# EAGLE schematic BoardSchem (EAGLE 9.6.2)

## Sheet 1 of 22: Power
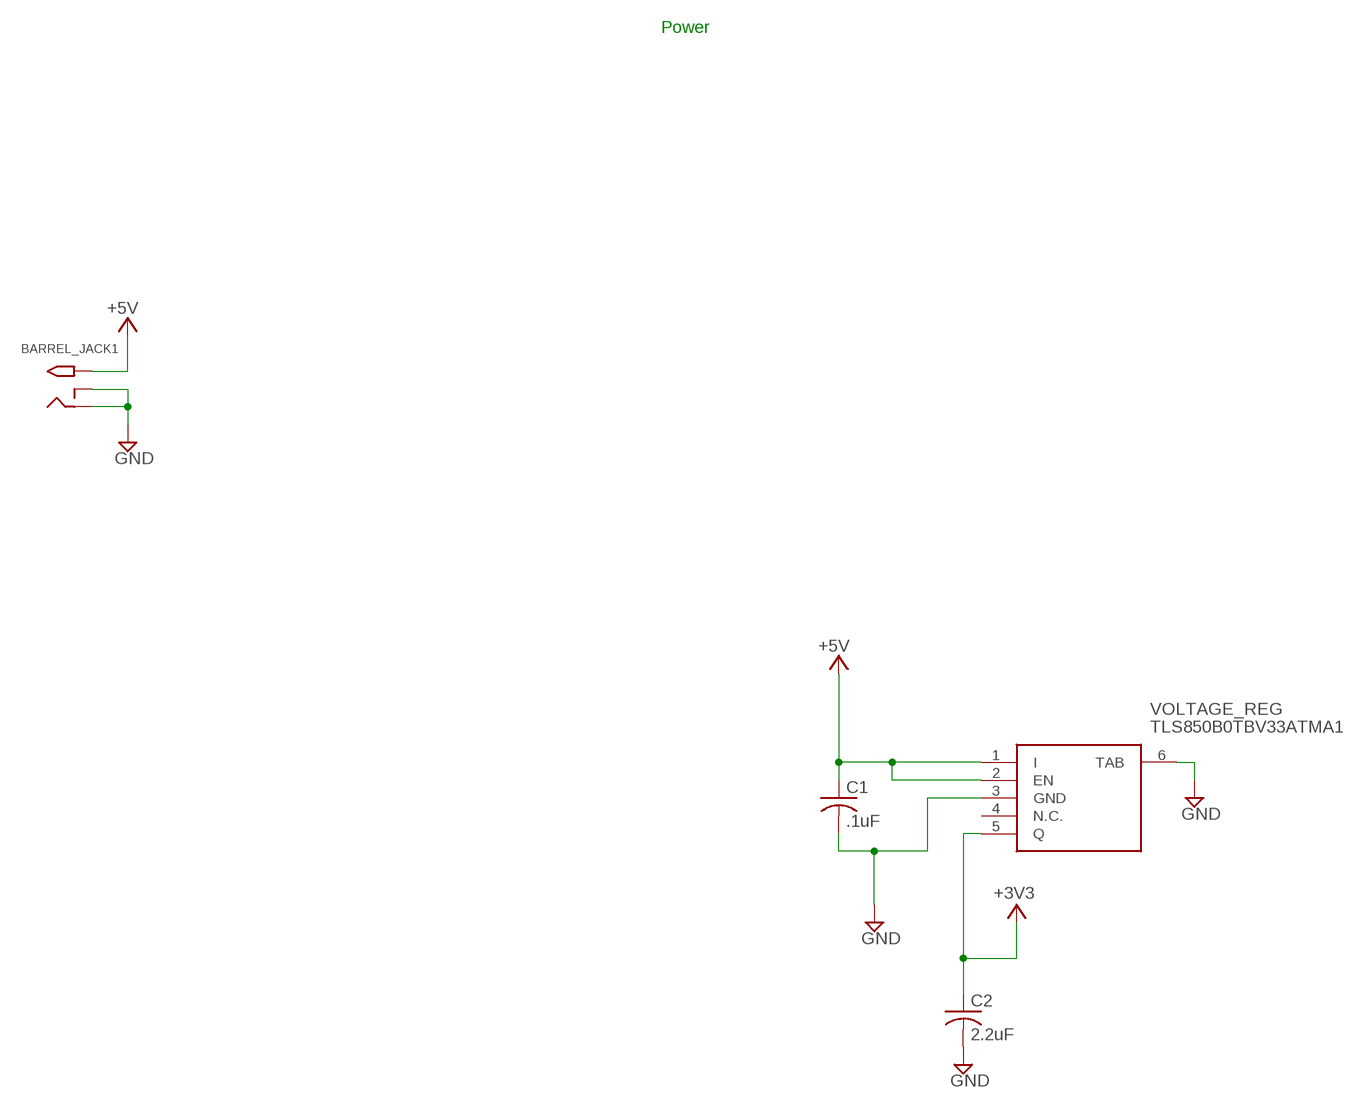
[diagram p0: schematic, sheet 1]

### Parts
BARREL_JACK1  2.1MMJACKTHM  [PJ-102A]
C1  .1uF  C-USC0805  [C0805]
C2  2.2uF  C-USC0805  [C0805]
VOLTAGE_REG  TLS850B0TBV33ATMA1  [TLS850B0TBV33ATMA1]

### Nets
+3V3: C2.1 VOLTAGE_REG.5(Q) ; also sheet 3,4,5,6,7,8,9,10,11,12,13,14,15,16,17,18,19,20,21,22
+5V: BARREL_JACK1.TIP C1.1 VOLTAGE_REG.1(I) VOLTAGE_REG.2(EN) ; also sheet 2,3
GND [5v_power]: BARREL_JACK1.RING BARREL_JACK1.RING_SW C1.2 C2.2 VOLTAGE_REG.3(GND) VOLTAGE_REG.6(TAB) ; also sheet 2,3,4,5,6,7,8,9,10,11,12,13,14,15,16,17,18,19,20,21,22
Unconnected: VOLTAGE_REG.4(N.C.)

### Notes on the sheet
- Power

## Sheet 2 of 22: Controling ICs
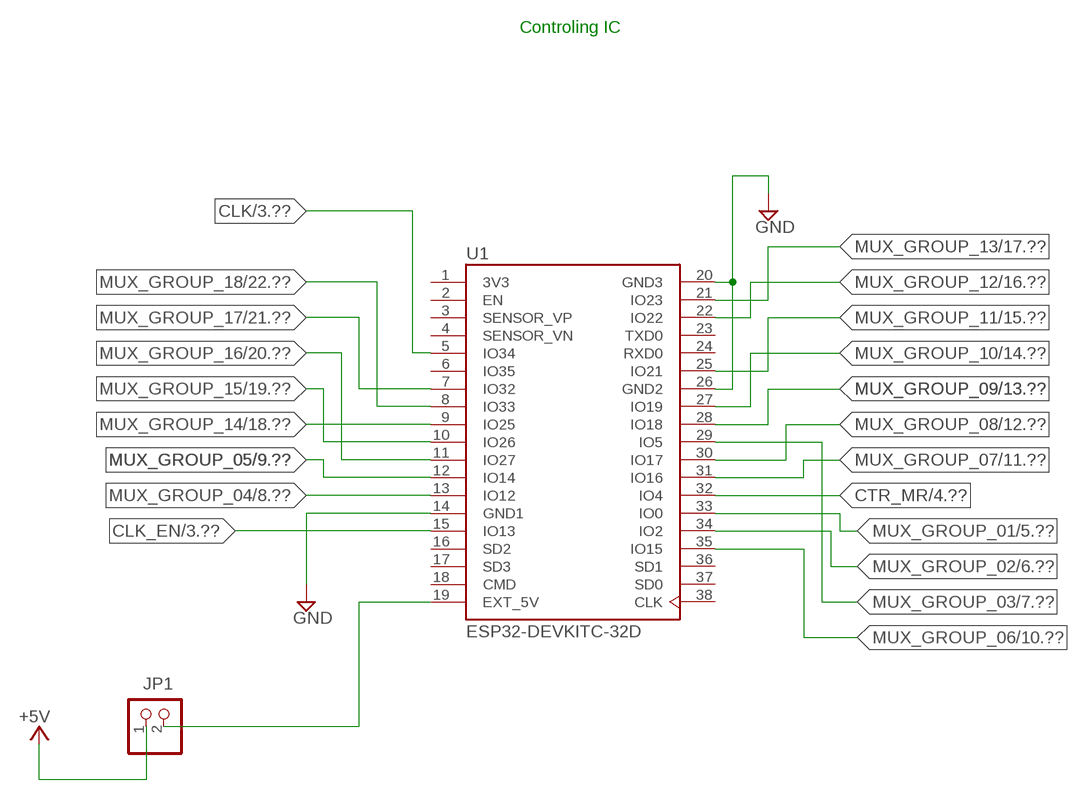
[diagram p1: schematic, sheet 2]

### Parts
JP1  PINHD-1X2  [1X02]
U1  ESP32-DEVKITC-32D  [MODULE_ESP32-DEVKITC-32D]

### Nets
+5V: JP1.1 ; also sheet 1,3
CLK: U1.5(IO34) ; also sheet 3,4
CLK_EN: U1.15(IO13) ; also sheet 3
CTR_MR: U1.32(IO4) ; also sheet 4
GND [5v_power]: U1.14(GND1) U1.20(GND3) U1.26(GND2) ; also sheet 1,3,4,5,6,7,8,9,10,11,12,13,14,15,16,17,18,19,20,21,22
MUX_GROUP_01: U1.33(IO0) ; also sheet 5
MUX_GROUP_02: U1.34(IO2) ; also sheet 6
MUX_GROUP_03: U1.29(IO5) ; also sheet 7
MUX_GROUP_04: U1.13(IO12) ; also sheet 8
MUX_GROUP_05: U1.12(IO14) ; also sheet 9
MUX_GROUP_06: U1.35(IO15) ; also sheet 10
MUX_GROUP_07: U1.31(IO16) ; also sheet 11
MUX_GROUP_08: U1.30(IO17) ; also sheet 12
MUX_GROUP_09: U1.28(IO18) ; also sheet 13
MUX_GROUP_10: U1.27(IO19) ; also sheet 14
MUX_GROUP_11: U1.25(IO21) ; also sheet 15
MUX_GROUP_12: U1.22(IO22) ; also sheet 16
MUX_GROUP_13: U1.21(IO23) ; also sheet 17
MUX_GROUP_14: U1.9(IO25) ; also sheet 18
MUX_GROUP_15: U1.10(IO26) ; also sheet 19
MUX_GROUP_16: U1.11(IO27) ; also sheet 20
MUX_GROUP_17: U1.7(IO32) ; also sheet 21
MUX_GROUP_18: U1.8(IO33) ; also sheet 22
N$1: JP1.2 U1.19(EXT_5V)
Unconnected: U1.2(EN) U1.3(SENSOR_VP) U1.4(SENSOR_VN) U1.6(IO35) U1.16(SD2) U1.17(SD3) U1.18(CMD) U1.23(TXD0) U1.24(RXD0) U1.36(SD1) U1.37(SD0) U1.38(CLK)

### Notes on the sheet
- Controling IC

## Sheet 3 of 22: CLK
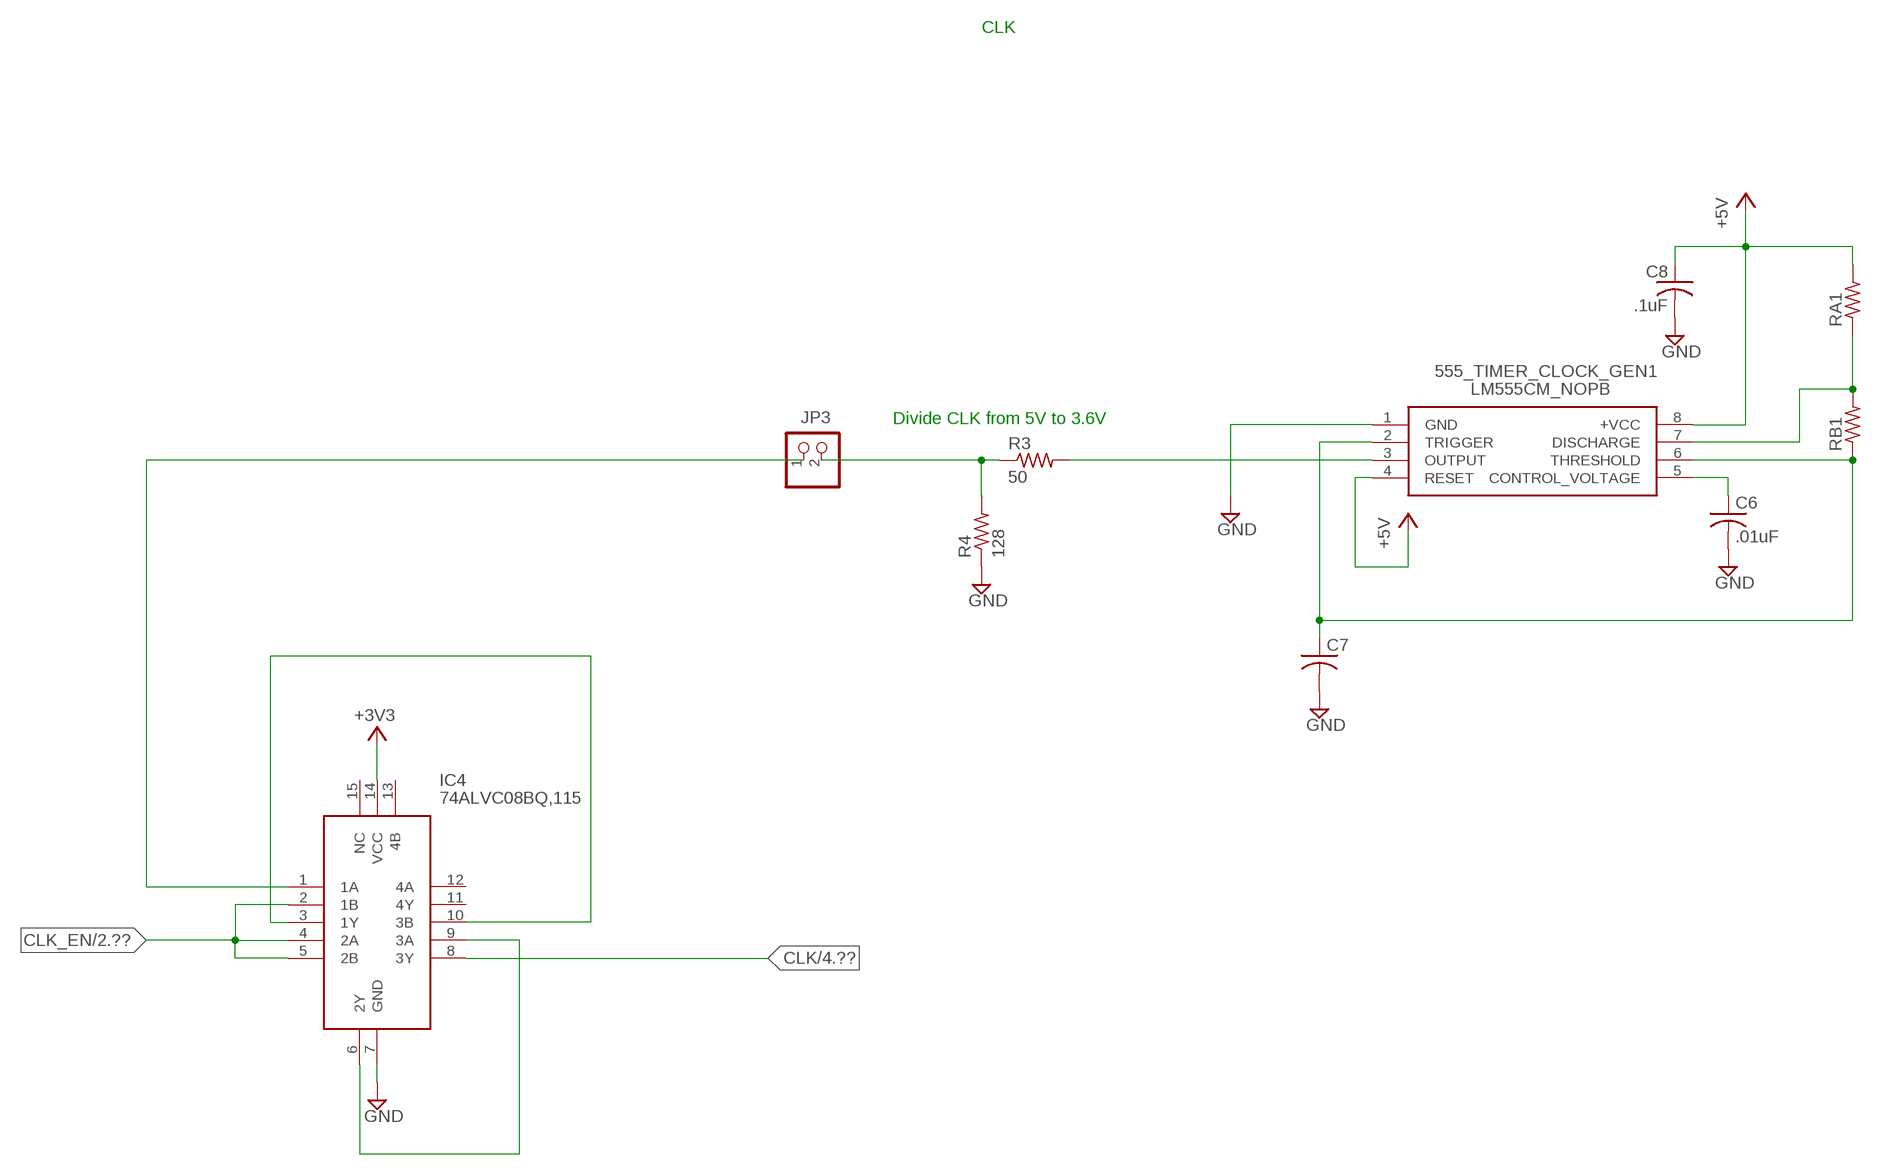
[diagram p2: schematic, sheet 3]

### Parts
555_TIMER_CLOCK_GEN1  LM555CM_NOPB  [SOIC127P600X175-8N]
C6  .01uF  C-USC0805  [C0805]
C7  C-USC0805  [C0805]
C8  .1uF  C-USC0805  [C0805]
IC4  74ALVC08BQ,115  [QFN50P250X300X100-15N]
JP3  PINHD-1X2  [1X02]
R3  50  R-US_R0805  [R0805]
R4  128  R-US_R0805  [R0805]
RA1  R-US_R0805  [R0805]
RB1  R-US_R0805  [R0805]

### Nets
+3V3: IC4.14(VCC) ; also sheet 1,4,5,6,7,8,9,10,11,12,13,14,15,16,17,18,19,20,21,22
+5V: 555_TIMER_CLOCK_GEN1.4(RESET) 555_TIMER_CLOCK_GEN1.8(+VCC) C8.1 RA1.2 ; also sheet 1,2
CLK: IC4.8(3Y) ; also sheet 2,4
CLK_EN: IC4.2(1B) IC4.4(2A) IC4.5(2B) ; also sheet 2
GND [5v_power]: 555_TIMER_CLOCK_GEN1.1(GND) C6.2 C7.2 C8.2 IC4.7(GND) R4.1 ; also sheet 1,2,4,5,6,7,8,9,10,11,12,13,14,15,16,17,18,19,20,21,22
N$3: JP3.2 R3.1 R4.2
N$4: 555_TIMER_CLOCK_GEN1.5(CONTROL_VOLTAGE) C6.1
N$7: 555_TIMER_CLOCK_GEN1.3(OUTPUT) R3.2
N$8: 555_TIMER_CLOCK_GEN1.2(TRIGGER) 555_TIMER_CLOCK_GEN1.6(THRESHOLD) C7.1 RB1.1
N$9: 555_TIMER_CLOCK_GEN1.7(DISCHARGE) RA1.1 RB1.2
N$11: IC4.1(1A) JP3.1
N$14: IC4.6(2Y) IC4.9(3A)
N$17: IC4.3(1Y) IC4.10(3B)
Unconnected: IC4.11(4Y) IC4.12(4A) IC4.13(4B) IC4.15(NC)

### Notes on the sheet
- CLK
- Divide CLK from 5V to 3.6V

## Sheet 4 of 22: Counter
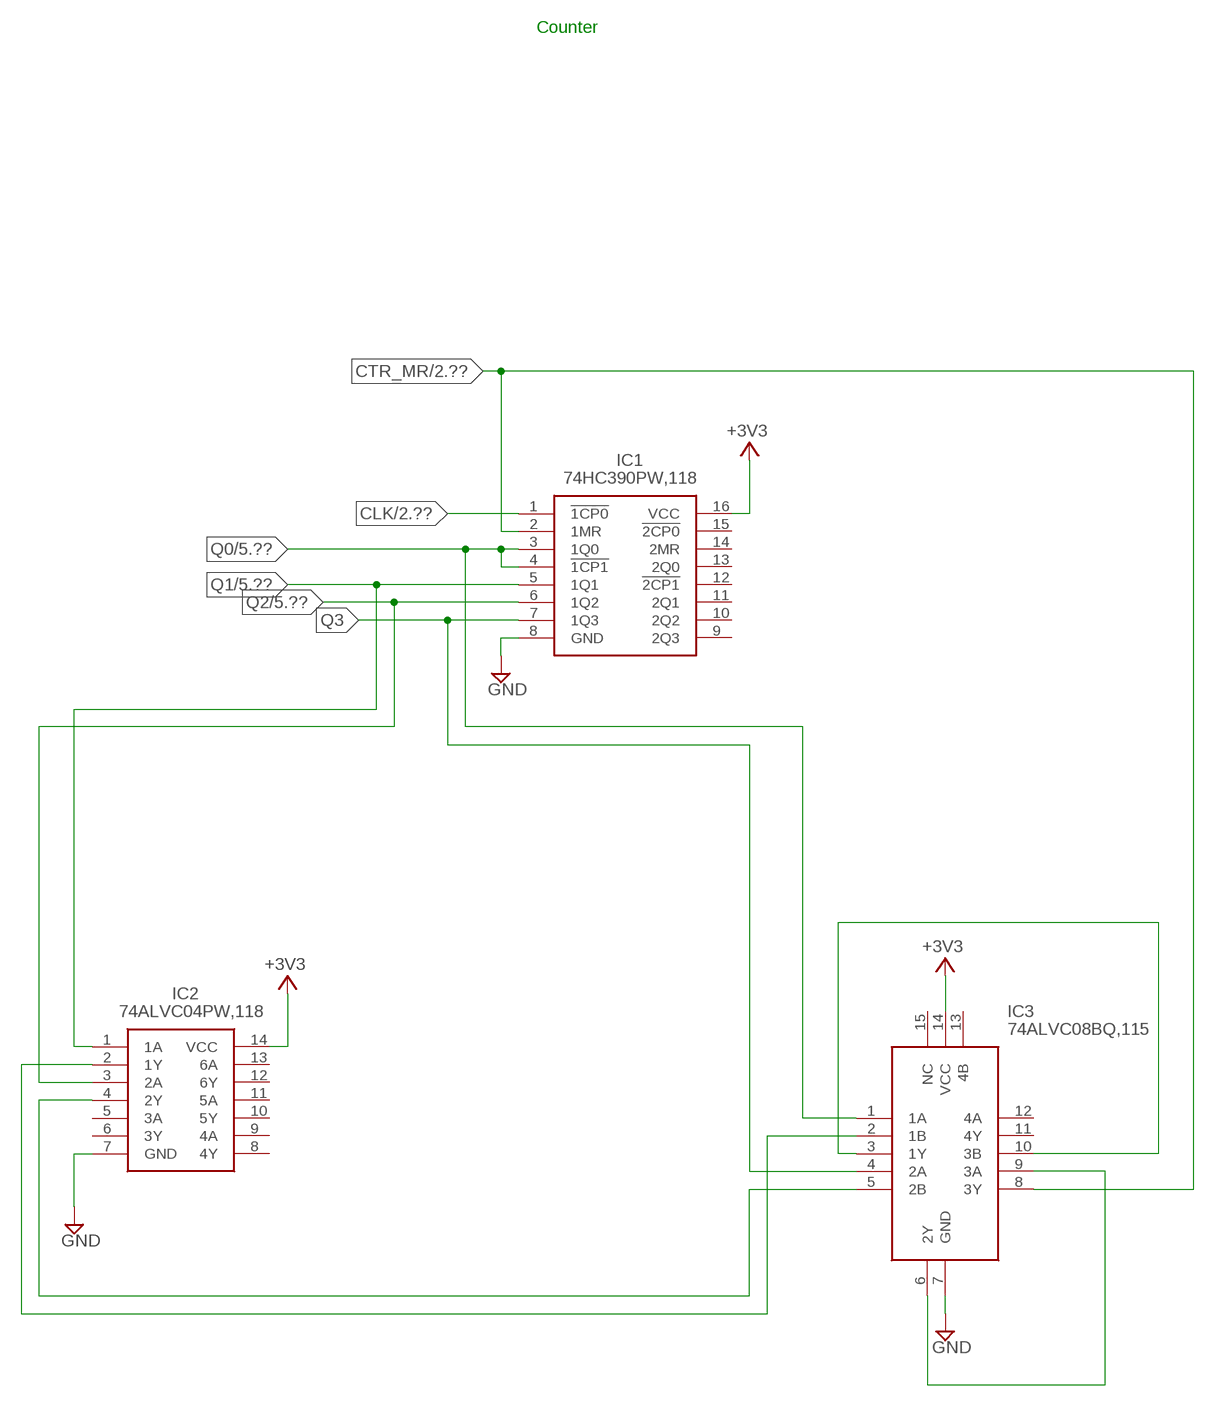
[diagram p3: schematic, sheet 4]

### Parts
IC1  74HC390PW,118  [SOP65P640X110-16N]
IC2  74ALVC04PW,118  [SOP65P640X110-14N]
IC3  74ALVC08BQ,115  [QFN50P250X300X100-15N]

### Nets
+3V3: IC1.16(VCC) IC2.14(VCC) IC3.14(VCC) ; also sheet 1,3,5,6,7,8,9,10,11,12,13,14,15,16,17,18,19,20,21,22
CLK: IC1.1(!1CP0) ; also sheet 2,3
CTR_MR: IC1.2(1MR) IC3.8(3Y) ; also sheet 2
GND [5v_power]: IC1.8(GND) IC2.7(GND) IC3.7(GND) ; also sheet 1,2,3,5,6,7,8,9,10,11,12,13,14,15,16,17,18,19,20,21,22
N$2: IC2.4(2Y) IC3.5(2B)
N$5: IC3.3(1Y) IC3.10(3B)
N$6: IC2.2(1Y) IC3.2(1B)
N$10: IC3.6(2Y) IC3.9(3A)
Q0: IC1.3(1Q0) IC1.4(!1CP1) IC3.1(1A) ; also sheet 5,6,7,8,9,10,11,12,13,14,15,16,17,18,19,20,21,22
Q1: IC1.5(1Q1) IC2.1(1A) ; also sheet 5,6,7,8,9,10,11,12,13,14,15,16,17,18,19,20,21,22
Q2: IC1.6(1Q2) IC2.3(2A) ; also sheet 5,6,7,8,9,10,11,12,13,14,15,16,17,18,19,20,21,22
Q3: IC1.7(1Q3) IC3.4(2A)
Unconnected: IC1.9(2Q3) IC1.10(2Q2) IC1.11(2Q1) IC1.12(!2CP1) IC1.13(2Q0) IC1.14(2MR) IC1.15(!2CP0) IC2.5(3A) IC2.6(3Y) IC2.8(4Y) IC2.9(4A) IC2.10(5Y) IC2.11(5A) IC2.12(6Y) IC2.13(6A) IC3.11(4Y) IC3.12(4A) IC3.13(4B) IC3.15(NC)

### Notes on the sheet
- Counter

## Sheet 5 of 22: MUX Group #1
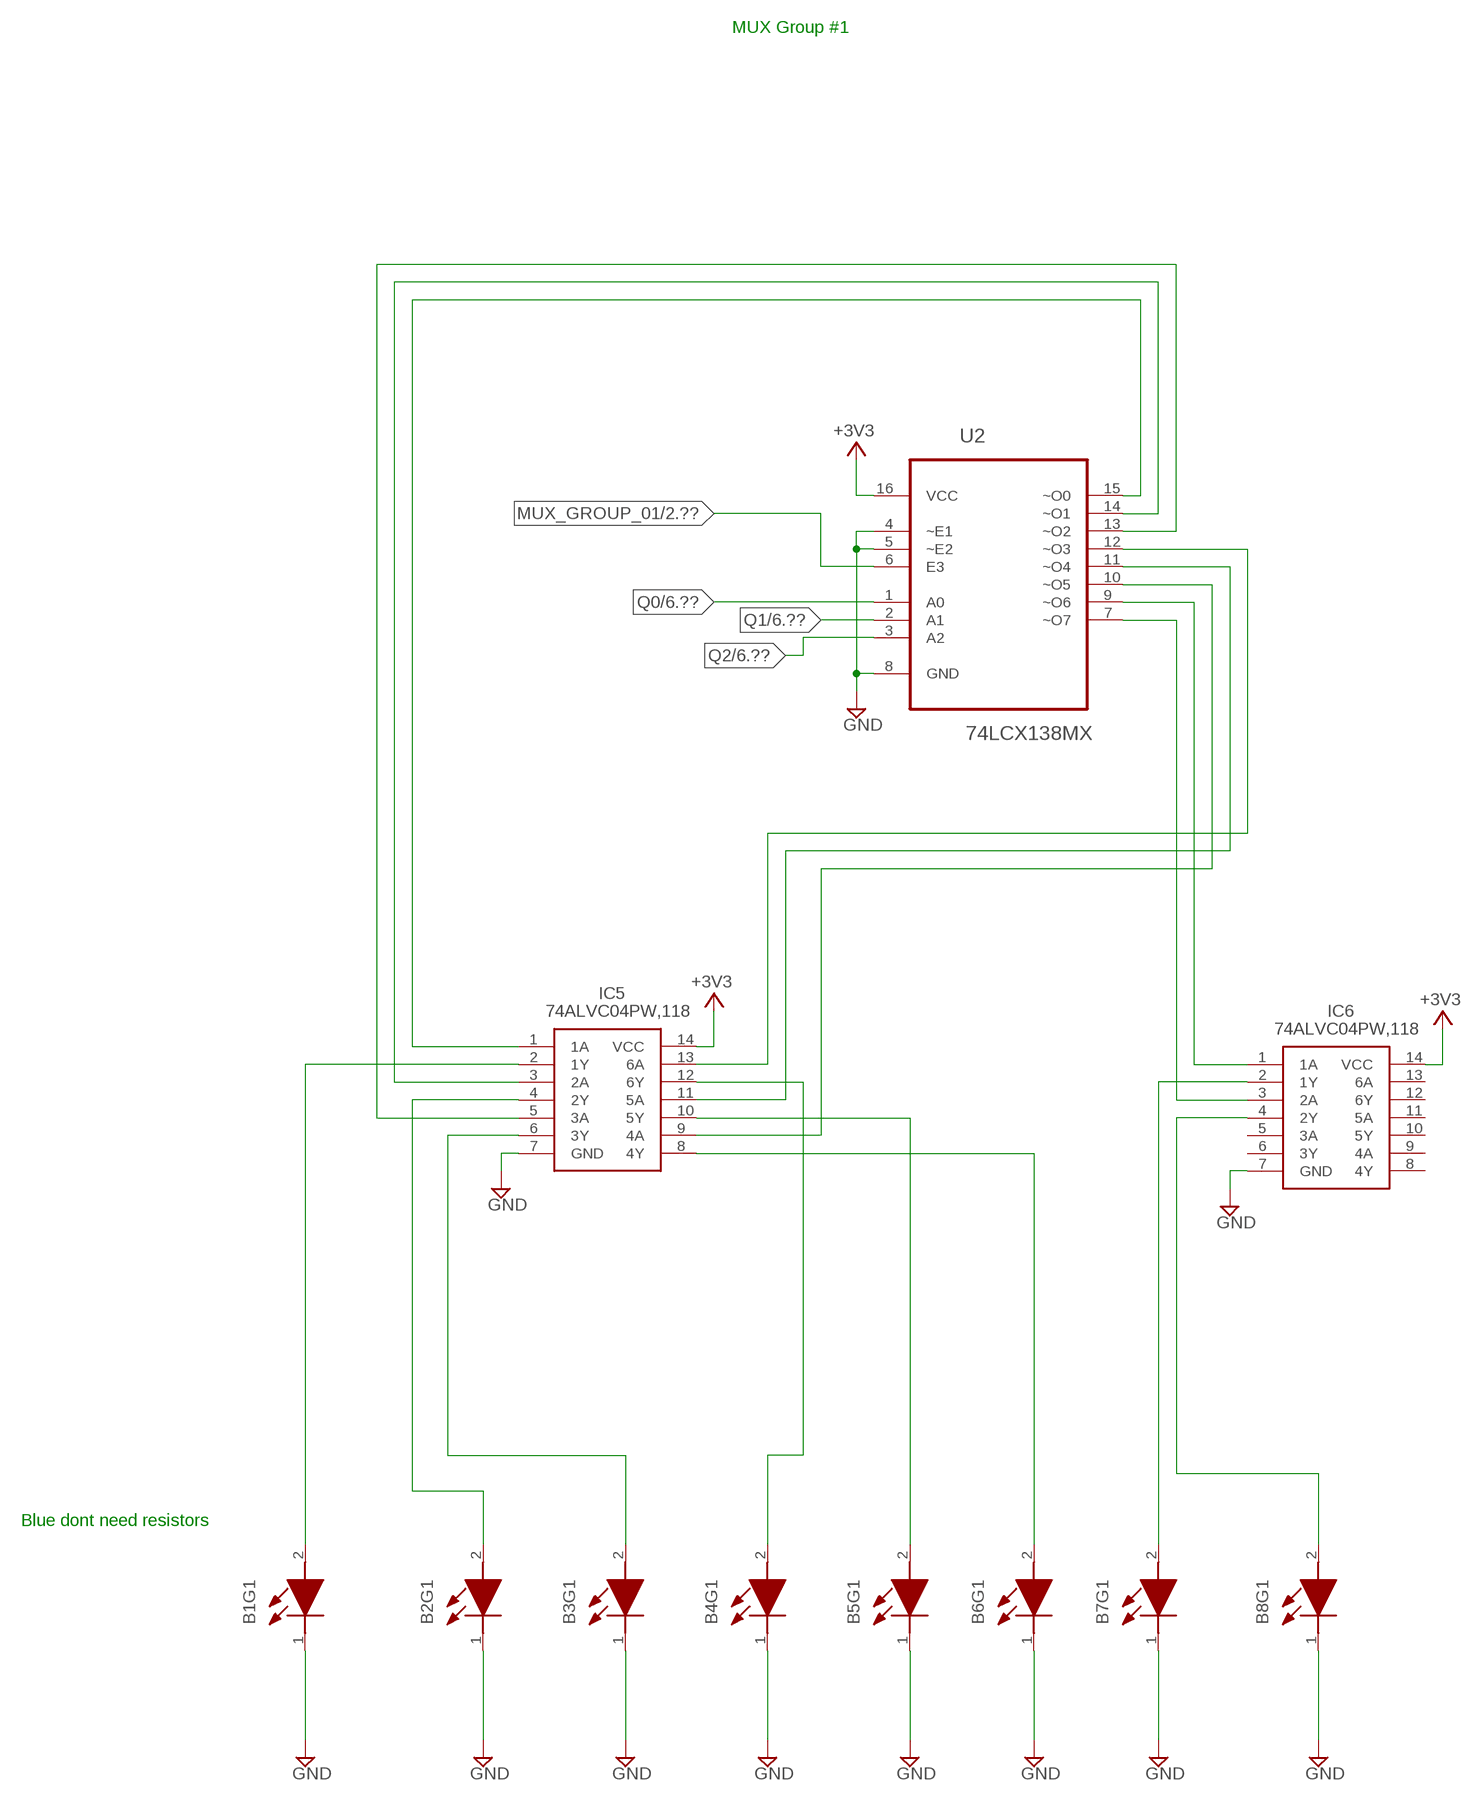
[diagram p4: schematic, sheet 5]

### Parts
B1G1  LTST-C170TBKT  [LEDC2012X120N]
B2G1  LTST-C170TBKT  [LEDC2012X120N]
B3G1  LTST-C170TBKT  [LEDC2012X120N]
B4G1  LTST-C170TBKT  [LEDC2012X120N]
B5G1  LTST-C170TBKT  [LEDC2012X120N]
B6G1  LTST-C170TBKT  [LEDC2012X120N]
B7G1  LTST-C170TBKT  [LEDC2012X120N]
B8G1  LTST-C170TBKT  [LEDC2012X120N]
IC5  74ALVC04PW,118  [SOP65P640X110-14N]
IC6  74ALVC04PW,118  [SOP65P640X110-14N]
U2  74LCX138MX  [SOIC127P600X175-16N]

### Nets
+3V3: IC5.14(VCC) IC6.14(VCC) U2.16(VCC) ; also sheet 1,3,4,6,7,8,9,10,11,12,13,14,15,16,17,18,19,20,21,22
GND [5v_power]: B1G1.1(K) B2G1.1(K) B3G1.1(K) B4G1.1(K) B5G1.1(K) B6G1.1(K) B7G1.1(K) B8G1.1(K) IC5.7(GND) IC6.7(GND) U2.4(~E1) U2.5(~E2) U2.8(GND) ; also sheet 1,2,3,4,6,7,8,9,10,11,12,13,14,15,16,17,18,19,20,21,22
MUX_GROUP_01: U2.6(E3) ; also sheet 2
N$12: IC5.1(1A) U2.15(~O0)
N$13: B1G1.2(A) IC5.2(1Y)
N$15: IC5.3(2A) U2.14(~O1)
N$16: B2G1.2(A) IC5.4(2Y)
N$18: IC5.5(3A) U2.13(~O2)
N$19: B3G1.2(A) IC5.6(3Y)
N$20: IC5.13(6A) U2.12(~O3)
N$21: B4G1.2(A) IC5.12(6Y)
N$22: IC5.11(5A) U2.11(~O4)
N$23: B5G1.2(A) IC5.10(5Y)
N$24: IC5.9(4A) U2.10(~O5)
N$25: B6G1.2(A) IC5.8(4Y)
N$26: IC6.1(1A) U2.9(~O6)
N$27: B7G1.2(A) IC6.2(1Y)
N$28: IC6.3(2A) U2.7(~O7)
N$29: B8G1.2(A) IC6.4(2Y)
Q0: U2.1(A0) ; also sheet 4,6,7,8,9,10,11,12,13,14,15,16,17,18,19,20,21,22
Q1: U2.2(A1) ; also sheet 4,6,7,8,9,10,11,12,13,14,15,16,17,18,19,20,21,22
Q2: U2.3(A2) ; also sheet 4,6,7,8,9,10,11,12,13,14,15,16,17,18,19,20,21,22
Unconnected: IC6.5(3A) IC6.6(3Y) IC6.8(4Y) IC6.9(4A) IC6.10(5Y) IC6.11(5A) IC6.12(6Y) IC6.13(6A)

### Notes on the sheet
- MUX Group #1
- Blue dont need resistors

## Sheet 6 of 22: MUX Group #2
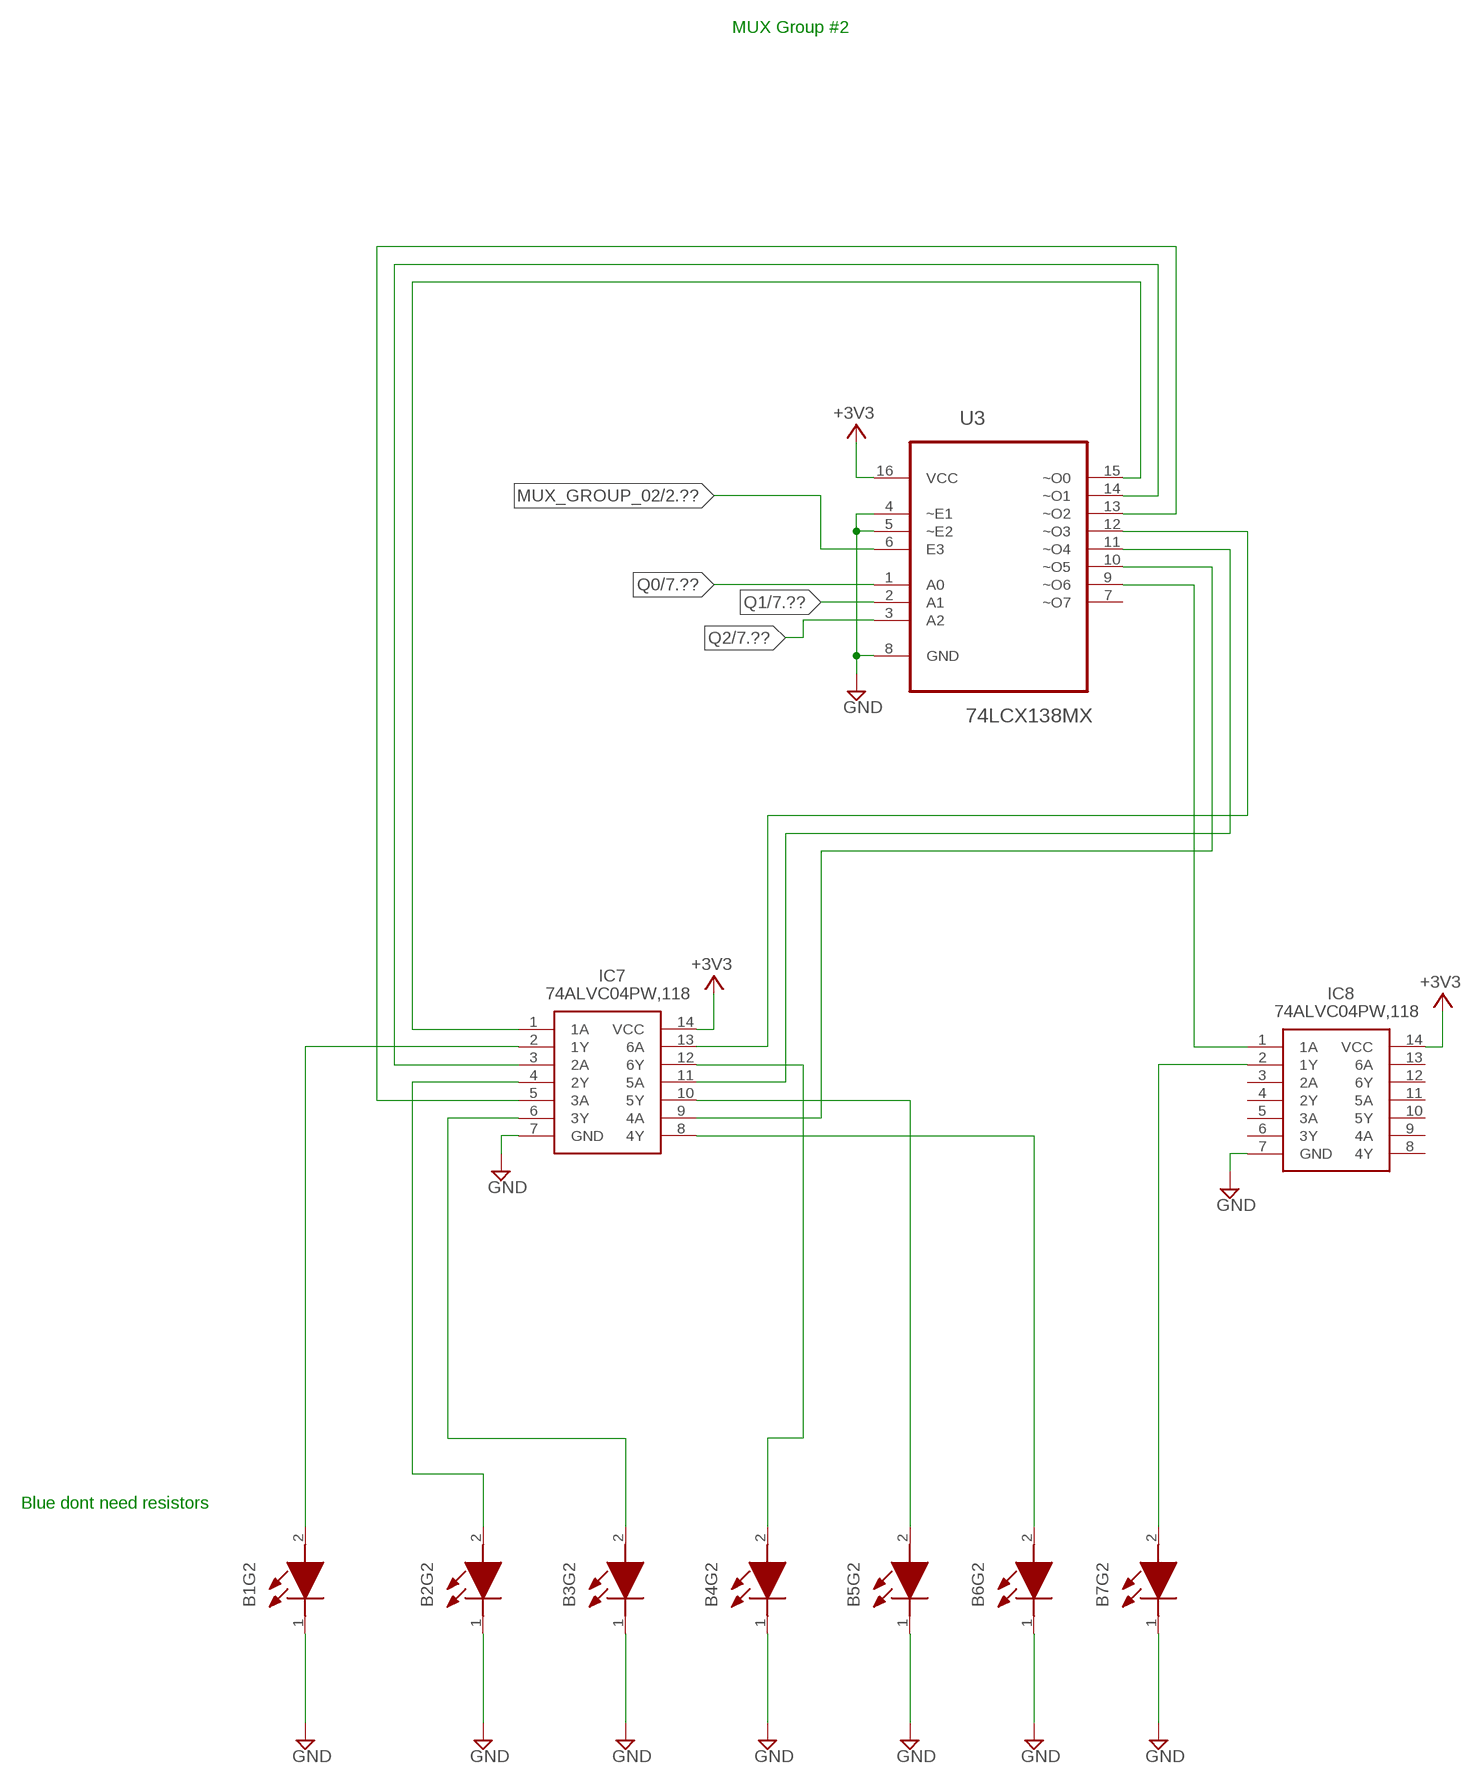
[diagram p5: schematic, sheet 6]

### Parts
B1G2  LTST-C170TBKT  [LEDC2012X120N]
B2G2  LTST-C170TBKT  [LEDC2012X120N]
B3G2  LTST-C170TBKT  [LEDC2012X120N]
B4G2  LTST-C170TBKT  [LEDC2012X120N]
B5G2  LTST-C170TBKT  [LEDC2012X120N]
B6G2  LTST-C170TBKT  [LEDC2012X120N]
B7G2  LTST-C170TBKT  [LEDC2012X120N]
IC7  74ALVC04PW,118  [SOP65P640X110-14N]
IC8  74ALVC04PW,118  [SOP65P640X110-14N]
U3  74LCX138MX  [SOIC127P600X175-16N]

### Nets
+3V3: IC7.14(VCC) IC8.14(VCC) U3.16(VCC) ; also sheet 1,3,4,5,7,8,9,10,11,12,13,14,15,16,17,18,19,20,21,22
GND [5v_power]: B1G2.1(K) B2G2.1(K) B3G2.1(K) B4G2.1(K) B5G2.1(K) B6G2.1(K) B7G2.1(K) IC7.7(GND) IC8.7(GND) U3.4(~E1) U3.5(~E2) U3.8(GND) ; also sheet 1,2,3,4,5,7,8,9,10,11,12,13,14,15,16,17,18,19,20,21,22
MUX_GROUP_02: U3.6(E3) ; also sheet 2
N$31: IC7.1(1A) U3.15(~O0)
N$32: B1G2.2(A) IC7.2(1Y)
N$33: IC7.3(2A) U3.14(~O1)
N$34: B2G2.2(A) IC7.4(2Y)
N$35: IC7.5(3A) U3.13(~O2)
N$36: B3G2.2(A) IC7.6(3Y)
N$37: IC7.13(6A) U3.12(~O3)
N$38: B4G2.2(A) IC7.12(6Y)
N$39: IC7.11(5A) U3.11(~O4)
N$40: B5G2.2(A) IC7.10(5Y)
N$41: IC7.9(4A) U3.10(~O5)
N$42: B6G2.2(A) IC7.8(4Y)
N$43: IC8.1(1A) U3.9(~O6)
N$44: B7G2.2(A) IC8.2(1Y)
Q0: U3.1(A0) ; also sheet 4,5,7,8,9,10,11,12,13,14,15,16,17,18,19,20,21,22
Q1: U3.2(A1) ; also sheet 4,5,7,8,9,10,11,12,13,14,15,16,17,18,19,20,21,22
Q2: U3.3(A2) ; also sheet 4,5,7,8,9,10,11,12,13,14,15,16,17,18,19,20,21,22
Unconnected: IC8.3(2A) IC8.4(2Y) IC8.5(3A) IC8.6(3Y) IC8.8(4Y) IC8.9(4A) IC8.10(5Y) IC8.11(5A) IC8.12(6Y) IC8.13(6A) U3.7(~O7)

### Notes on the sheet
- MUX Group #2
- Blue dont need resistors

## Sheet 7 of 22: MUX Group #3
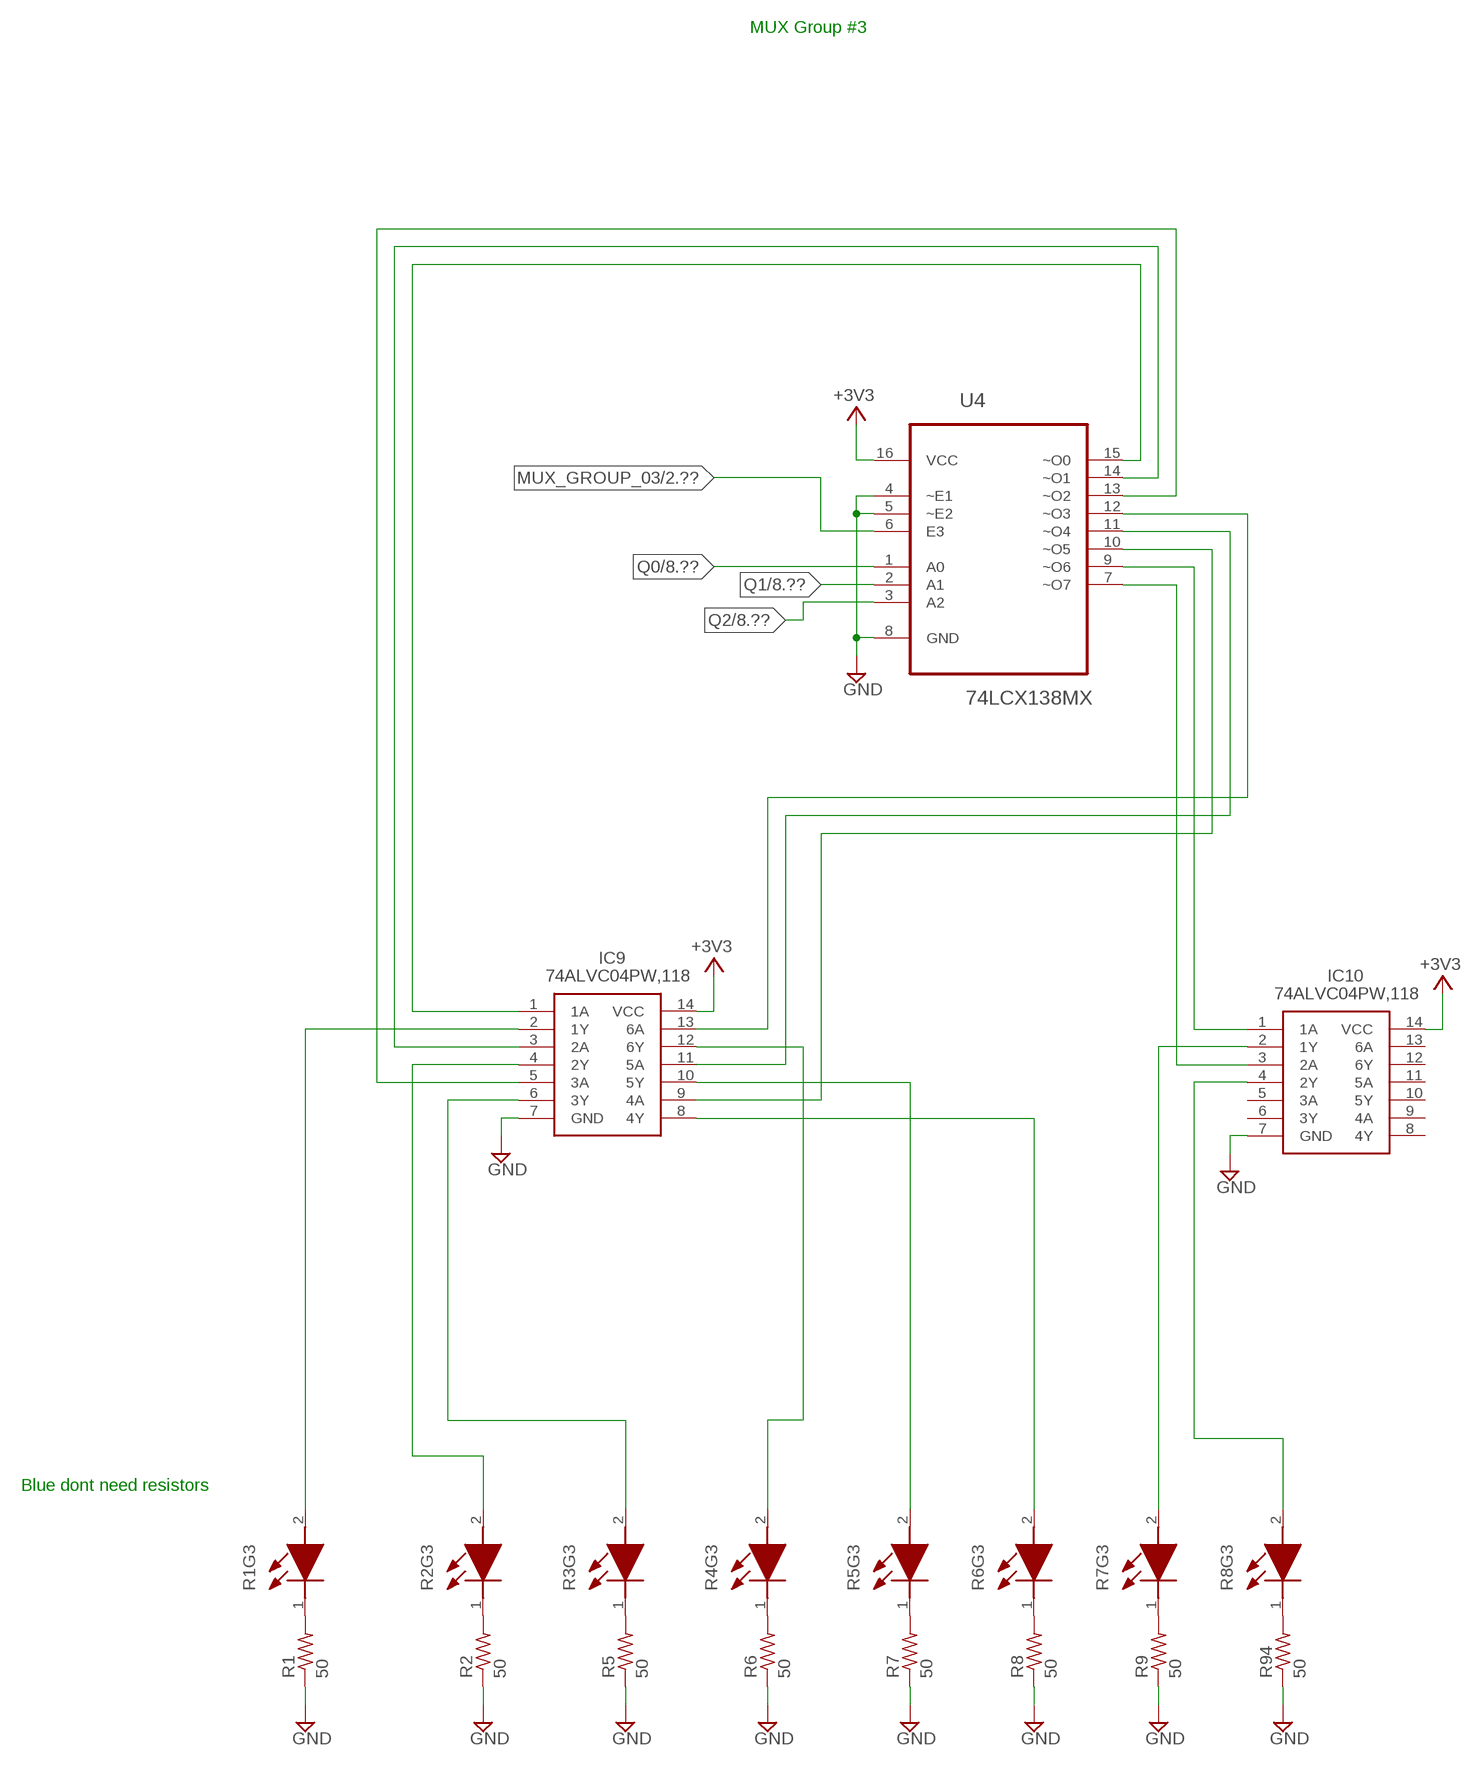
[diagram p6: schematic, sheet 7]

### Parts
IC9  74ALVC04PW,118  [SOP65P640X110-14N]
IC10  74ALVC04PW,118  [SOP65P640X110-14N]
R1  50  R-US_R0805  [R0805]
R1G3  LTST-C170TBKT  [LEDC2012X120N]
R2  50  R-US_R0805  [R0805]
R2G3  LTST-C170TBKT  [LEDC2012X120N]
R3G3  LTST-C170TBKT  [LEDC2012X120N]
R4G3  LTST-C170TBKT  [LEDC2012X120N]
R5  50  R-US_R0805  [R0805]
R5G3  LTST-C170TBKT  [LEDC2012X120N]
R6  50  R-US_R0805  [R0805]
R6G3  LTST-C170TBKT  [LEDC2012X120N]
R7  50  R-US_R0805  [R0805]
R7G3  LTST-C170TBKT  [LEDC2012X120N]
R8  50  R-US_R0805  [R0805]
R8G3  LTST-C170TBKT  [LEDC2012X120N]
R9  50  R-US_R0805  [R0805]
R94  50  R-US_R0805  [R0805]
U4  74LCX138MX  [SOIC127P600X175-16N]

### Nets
+3V3: IC9.14(VCC) IC10.14(VCC) U4.16(VCC) ; also sheet 1,3,4,5,6,8,9,10,11,12,13,14,15,16,17,18,19,20,21,22
GND [5v_power]: IC9.7(GND) IC10.7(GND) R1.1 R2.1 R5.1 R6.1 R7.1 R8.1 R9.1 R94.1 U4.4(~E1) U4.5(~E2) U4.8(GND) ; also sheet 1,2,3,4,5,6,8,9,10,11,12,13,14,15,16,17,18,19,20,21,22
MUX_GROUP_03: U4.6(E3) ; also sheet 2
N$30: IC10.3(2A) U4.7(~O7)
N$45: R1.2 R1G3.1(K)
N$46: R2.2 R2G3.1(K)
N$47: R8G3.1(K) R94.2
N$48: IC9.1(1A) U4.15(~O0)
N$49: IC9.2(1Y) R1G3.2(A)
N$50: IC9.3(2A) U4.14(~O1)
N$51: IC9.4(2Y) R2G3.2(A)
N$52: IC9.5(3A) U4.13(~O2)
N$53: IC9.6(3Y) R3G3.2(A)
N$54: IC9.13(6A) U4.12(~O3)
N$55: IC9.12(6Y) R4G3.2(A)
N$56: IC9.11(5A) U4.11(~O4)
N$57: IC9.10(5Y) R5G3.2(A)
N$58: IC9.9(4A) U4.10(~O5)
N$59: IC9.8(4Y) R6G3.2(A)
N$60: IC10.1(1A) U4.9(~O6)
N$61: IC10.2(1Y) R7G3.2(A)
N$62: R3G3.1(K) R5.2
N$63: R4G3.1(K) R6.2
N$64: IC10.4(2Y) R8G3.2(A)
N$320: R5G3.1(K) R7.2
N$321: R6G3.1(K) R8.2
N$322: R7G3.1(K) R9.2
Q0: U4.1(A0) ; also sheet 4,5,6,8,9,10,11,12,13,14,15,16,17,18,19,20,21,22
Q1: U4.2(A1) ; also sheet 4,5,6,8,9,10,11,12,13,14,15,16,17,18,19,20,21,22
Q2: U4.3(A2) ; also sheet 4,5,6,8,9,10,11,12,13,14,15,16,17,18,19,20,21,22
Unconnected: IC10.5(3A) IC10.6(3Y) IC10.8(4Y) IC10.9(4A) IC10.10(5Y) IC10.11(5A) IC10.12(6Y) IC10.13(6A)

### Notes on the sheet
- MUX Group #3
- Blue dont need resistors

## Sheet 8 of 22: MUX Group #4
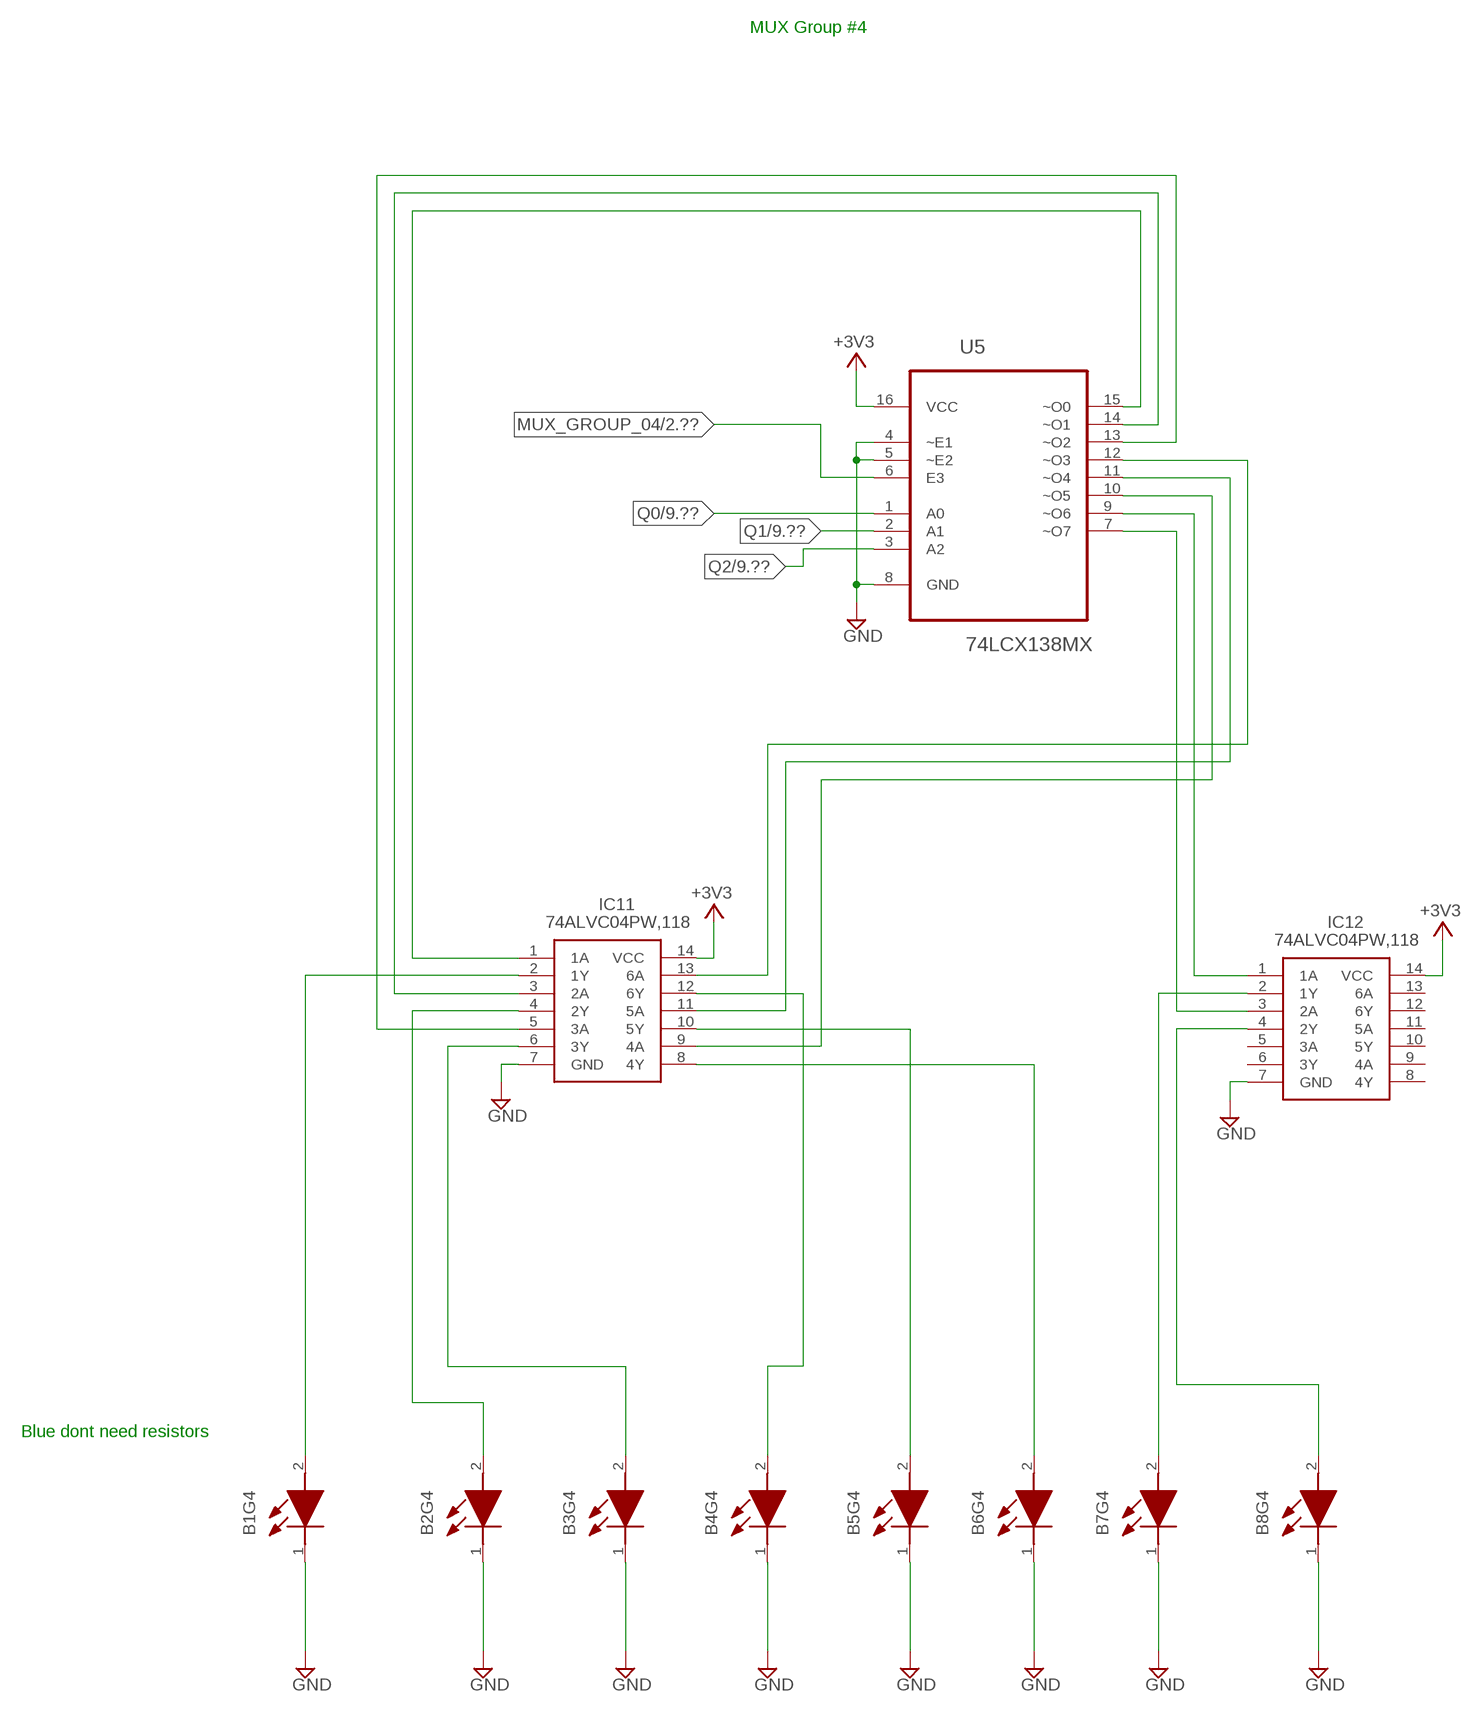
[diagram p7: schematic, sheet 8]

### Parts
B1G4  LTST-C170TBKT  [LEDC2012X120N]
B2G4  LTST-C170TBKT  [LEDC2012X120N]
B3G4  LTST-C170TBKT  [LEDC2012X120N]
B4G4  LTST-C170TBKT  [LEDC2012X120N]
B5G4  LTST-C170TBKT  [LEDC2012X120N]
B6G4  LTST-C170TBKT  [LEDC2012X120N]
B7G4  LTST-C170TBKT  [LEDC2012X120N]
B8G4  LTST-C170TBKT  [LEDC2012X120N]
IC11  74ALVC04PW,118  [SOP65P640X110-14N]
IC12  74ALVC04PW,118  [SOP65P640X110-14N]
U5  74LCX138MX  [SOIC127P600X175-16N]

### Nets
+3V3: IC11.14(VCC) IC12.14(VCC) U5.16(VCC) ; also sheet 1,3,4,5,6,7,9,10,11,12,13,14,15,16,17,18,19,20,21,22
GND [5v_power]: B1G4.1(K) B2G4.1(K) B3G4.1(K) B4G4.1(K) B5G4.1(K) B6G4.1(K) B7G4.1(K) B8G4.1(K) IC11.7(GND) IC12.7(GND) U5.4(~E1) U5.5(~E2) U5.8(GND) ; also sheet 1,2,3,4,5,6,7,9,10,11,12,13,14,15,16,17,18,19,20,21,22
MUX_GROUP_04: U5.6(E3) ; also sheet 2
N$65: IC11.1(1A) U5.15(~O0)
N$66: B1G4.2(A) IC11.2(1Y)
N$67: IC11.3(2A) U5.14(~O1)
N$68: B2G4.2(A) IC11.4(2Y)
N$69: IC11.5(3A) U5.13(~O2)
N$70: B3G4.2(A) IC11.6(3Y)
N$71: IC11.13(6A) U5.12(~O3)
N$72: B4G4.2(A) IC11.12(6Y)
N$73: IC11.11(5A) U5.11(~O4)
N$74: B5G4.2(A) IC11.10(5Y)
N$75: IC11.9(4A) U5.10(~O5)
N$76: B6G4.2(A) IC11.8(4Y)
N$77: IC12.1(1A) U5.9(~O6)
N$78: B7G4.2(A) IC12.2(1Y)
N$79: IC12.3(2A) U5.7(~O7)
N$80: B8G4.2(A) IC12.4(2Y)
Q0: U5.1(A0) ; also sheet 4,5,6,7,9,10,11,12,13,14,15,16,17,18,19,20,21,22
Q1: U5.2(A1) ; also sheet 4,5,6,7,9,10,11,12,13,14,15,16,17,18,19,20,21,22
Q2: U5.3(A2) ; also sheet 4,5,6,7,9,10,11,12,13,14,15,16,17,18,19,20,21,22
Unconnected: IC12.5(3A) IC12.6(3Y) IC12.8(4Y) IC12.9(4A) IC12.10(5Y) IC12.11(5A) IC12.12(6Y) IC12.13(6A)

### Notes on the sheet
- MUX Group #4
- Blue dont need resistors

## Sheet 9 of 22: MUX Group #5
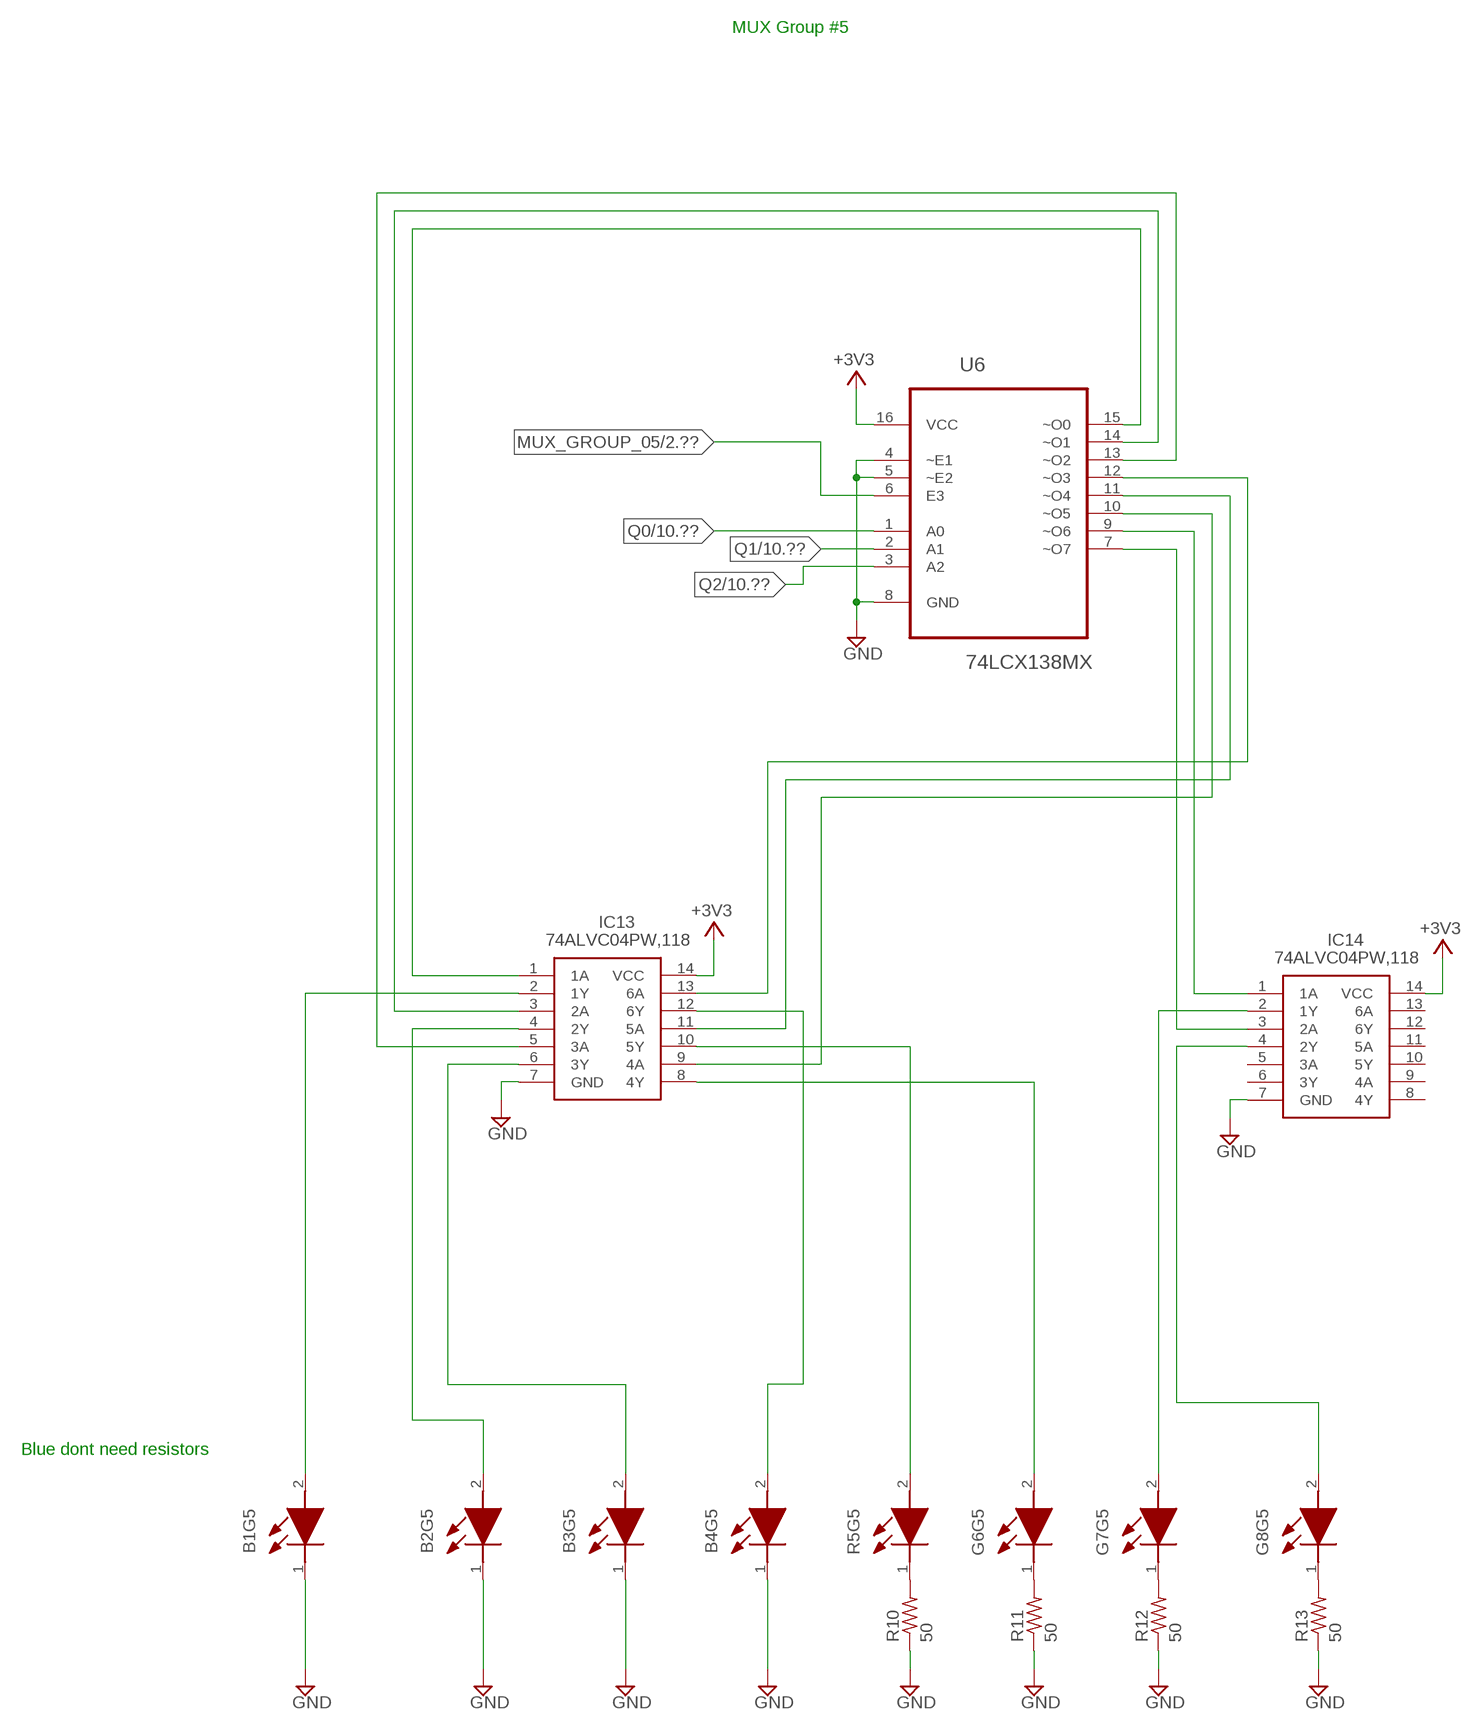
[diagram p8: schematic, sheet 9]

### Parts
B1G5  LTST-C170TBKT  [LEDC2012X120N]
B2G5  LTST-C170TBKT  [LEDC2012X120N]
B3G5  LTST-C170TBKT  [LEDC2012X120N]
B4G5  LTST-C170TBKT  [LEDC2012X120N]
G6G5  LTST-C170TBKT  [LEDC2012X120N]
G7G5  LTST-C170TBKT  [LEDC2012X120N]
G8G5  LTST-C170TBKT  [LEDC2012X120N]
IC13  74ALVC04PW,118  [SOP65P640X110-14N]
IC14  74ALVC04PW,118  [SOP65P640X110-14N]
R5G5  LTST-C170TBKT  [LEDC2012X120N]
R10  50  R-US_R0805  [R0805]
R11  50  R-US_R0805  [R0805]
R12  50  R-US_R0805  [R0805]
R13  50  R-US_R0805  [R0805]
U6  74LCX138MX  [SOIC127P600X175-16N]

### Nets
+3V3: IC13.14(VCC) IC14.14(VCC) U6.16(VCC) ; also sheet 1,3,4,5,6,7,8,10,11,12,13,14,15,16,17,18,19,20,21,22
GND [5v_power]: B1G5.1(K) B2G5.1(K) B3G5.1(K) B4G5.1(K) IC13.7(GND) IC14.7(GND) R10.1 R11.1 R12.1 R13.1 U6.4(~E1) U6.5(~E2) U6.8(GND) ; also sheet 1,2,3,4,5,6,7,8,10,11,12,13,14,15,16,17,18,19,20,21,22
MUX_GROUP_05: U6.6(E3) ; also sheet 2
N$82: IC13.1(1A) U6.15(~O0)
N$83: B1G5.2(A) IC13.2(1Y)
N$84: IC13.3(2A) U6.14(~O1)
N$85: B2G5.2(A) IC13.4(2Y)
N$86: IC13.5(3A) U6.13(~O2)
N$87: B3G5.2(A) IC13.6(3Y)
N$88: IC13.13(6A) U6.12(~O3)
N$89: B4G5.2(A) IC13.12(6Y)
N$90: IC13.11(5A) U6.11(~O4)
N$91: IC13.10(5Y) R5G5.2(A)
N$92: IC13.9(4A) U6.10(~O5)
N$93: G6G5.2(A) IC13.8(4Y)
N$94: IC14.1(1A) U6.9(~O6)
N$95: G7G5.2(A) IC14.2(1Y)
N$96: IC14.3(2A) U6.7(~O7)
N$97: G8G5.2(A) IC14.4(2Y)
N$323: R5G5.1(K) R10.2
N$324: G6G5.1(K) R11.2
N$325: G7G5.1(K) R12.2
N$326: G8G5.1(K) R13.2
Q0: U6.1(A0) ; also sheet 4,5,6,7,8,10,11,12,13,14,15,16,17,18,19,20,21,22
Q1: U6.2(A1) ; also sheet 4,5,6,7,8,10,11,12,13,14,15,16,17,18,19,20,21,22
Q2: U6.3(A2) ; also sheet 4,5,6,7,8,10,11,12,13,14,15,16,17,18,19,20,21,22
Unconnected: IC14.5(3A) IC14.6(3Y) IC14.8(4Y) IC14.9(4A) IC14.10(5Y) IC14.11(5A) IC14.12(6Y) IC14.13(6A)

### Notes on the sheet
- MUX Group #5
- Blue dont need resistors

## Sheet 10 of 22: MUX Group #6
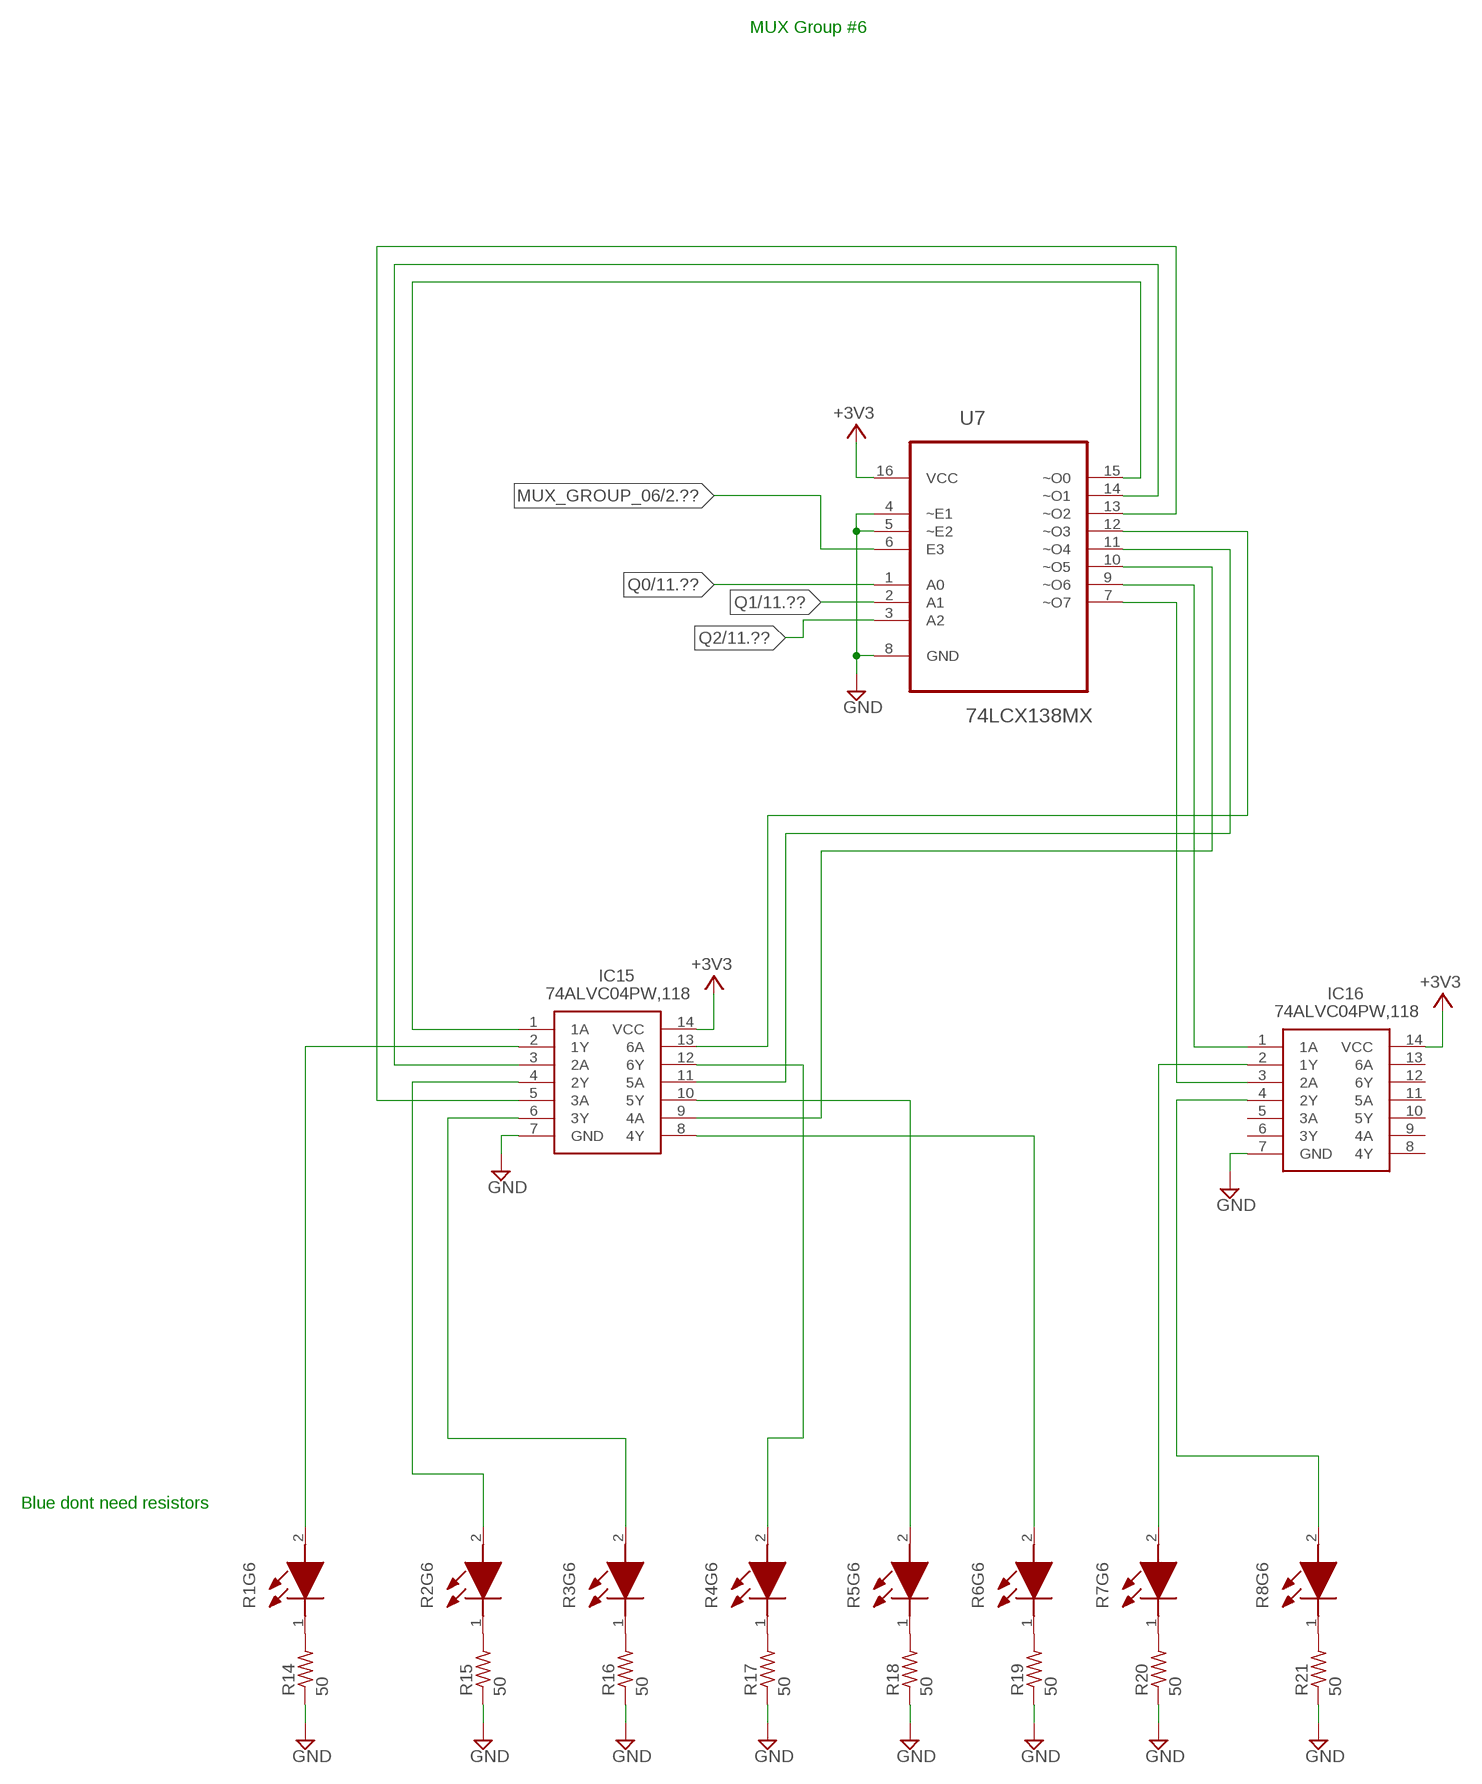
[diagram p9: schematic, sheet 10]

### Parts
IC15  74ALVC04PW,118  [SOP65P640X110-14N]
IC16  74ALVC04PW,118  [SOP65P640X110-14N]
R1G6  LTST-C170TBKT  [LEDC2012X120N]
R2G6  LTST-C170TBKT  [LEDC2012X120N]
R3G6  LTST-C170TBKT  [LEDC2012X120N]
R4G6  LTST-C170TBKT  [LEDC2012X120N]
R5G6  LTST-C170TBKT  [LEDC2012X120N]
R6G6  LTST-C170TBKT  [LEDC2012X120N]
R7G6  LTST-C170TBKT  [LEDC2012X120N]
R8G6  LTST-C170TBKT  [LEDC2012X120N]
R14  50  R-US_R0805  [R0805]
R15  50  R-US_R0805  [R0805]
R16  50  R-US_R0805  [R0805]
R17  50  R-US_R0805  [R0805]
R18  50  R-US_R0805  [R0805]
R19  50  R-US_R0805  [R0805]
R20  50  R-US_R0805  [R0805]
R21  50  R-US_R0805  [R0805]
U7  74LCX138MX  [SOIC127P600X175-16N]

### Nets
+3V3: IC15.14(VCC) IC16.14(VCC) U7.16(VCC) ; also sheet 1,3,4,5,6,7,8,9,11,12,13,14,15,16,17,18,19,20,21,22
GND [5v_power]: IC15.7(GND) IC16.7(GND) R14.1 R15.1 R16.1 R17.1 R18.1 R19.1 R20.1 R21.1 U7.4(~E1) U7.5(~E2) U7.8(GND) ; also sheet 1,2,3,4,5,6,7,8,9,11,12,13,14,15,16,17,18,19,20,21,22
MUX_GROUP_06: U7.6(E3) ; also sheet 2
N$99: IC15.1(1A) U7.15(~O0)
N$100: IC15.2(1Y) R1G6.2(A)
N$101: IC15.3(2A) U7.14(~O1)
N$102: IC15.4(2Y) R2G6.2(A)
N$103: IC15.5(3A) U7.13(~O2)
N$104: IC15.6(3Y) R3G6.2(A)
N$105: IC15.13(6A) U7.12(~O3)
N$106: IC15.12(6Y) R4G6.2(A)
N$107: IC15.11(5A) U7.11(~O4)
N$108: IC15.10(5Y) R5G6.2(A)
N$109: IC15.9(4A) U7.10(~O5)
N$110: IC15.8(4Y) R6G6.2(A)
N$111: IC16.1(1A) U7.9(~O6)
N$112: IC16.2(1Y) R7G6.2(A)
N$113: IC16.3(2A) U7.7(~O7)
N$114: IC16.4(2Y) R8G6.2(A)
N$327: R1G6.1(K) R14.2
N$328: R2G6.1(K) R15.2
N$329: R3G6.1(K) R16.2
N$330: R4G6.1(K) R17.2
N$331: R5G6.1(K) R18.2
N$332: R6G6.1(K) R19.2
N$333: R7G6.1(K) R20.2
N$334: R8G6.1(K) R21.2
Q0: U7.1(A0) ; also sheet 4,5,6,7,8,9,11,12,13,14,15,16,17,18,19,20,21,22
Q1: U7.2(A1) ; also sheet 4,5,6,7,8,9,11,12,13,14,15,16,17,18,19,20,21,22
Q2: U7.3(A2) ; also sheet 4,5,6,7,8,9,11,12,13,14,15,16,17,18,19,20,21,22
Unconnected: IC16.5(3A) IC16.6(3Y) IC16.8(4Y) IC16.9(4A) IC16.10(5Y) IC16.11(5A) IC16.12(6Y) IC16.13(6A)

### Notes on the sheet
- MUX Group #6
- Blue dont need resistors

## Sheet 11 of 22: MUX Group #7
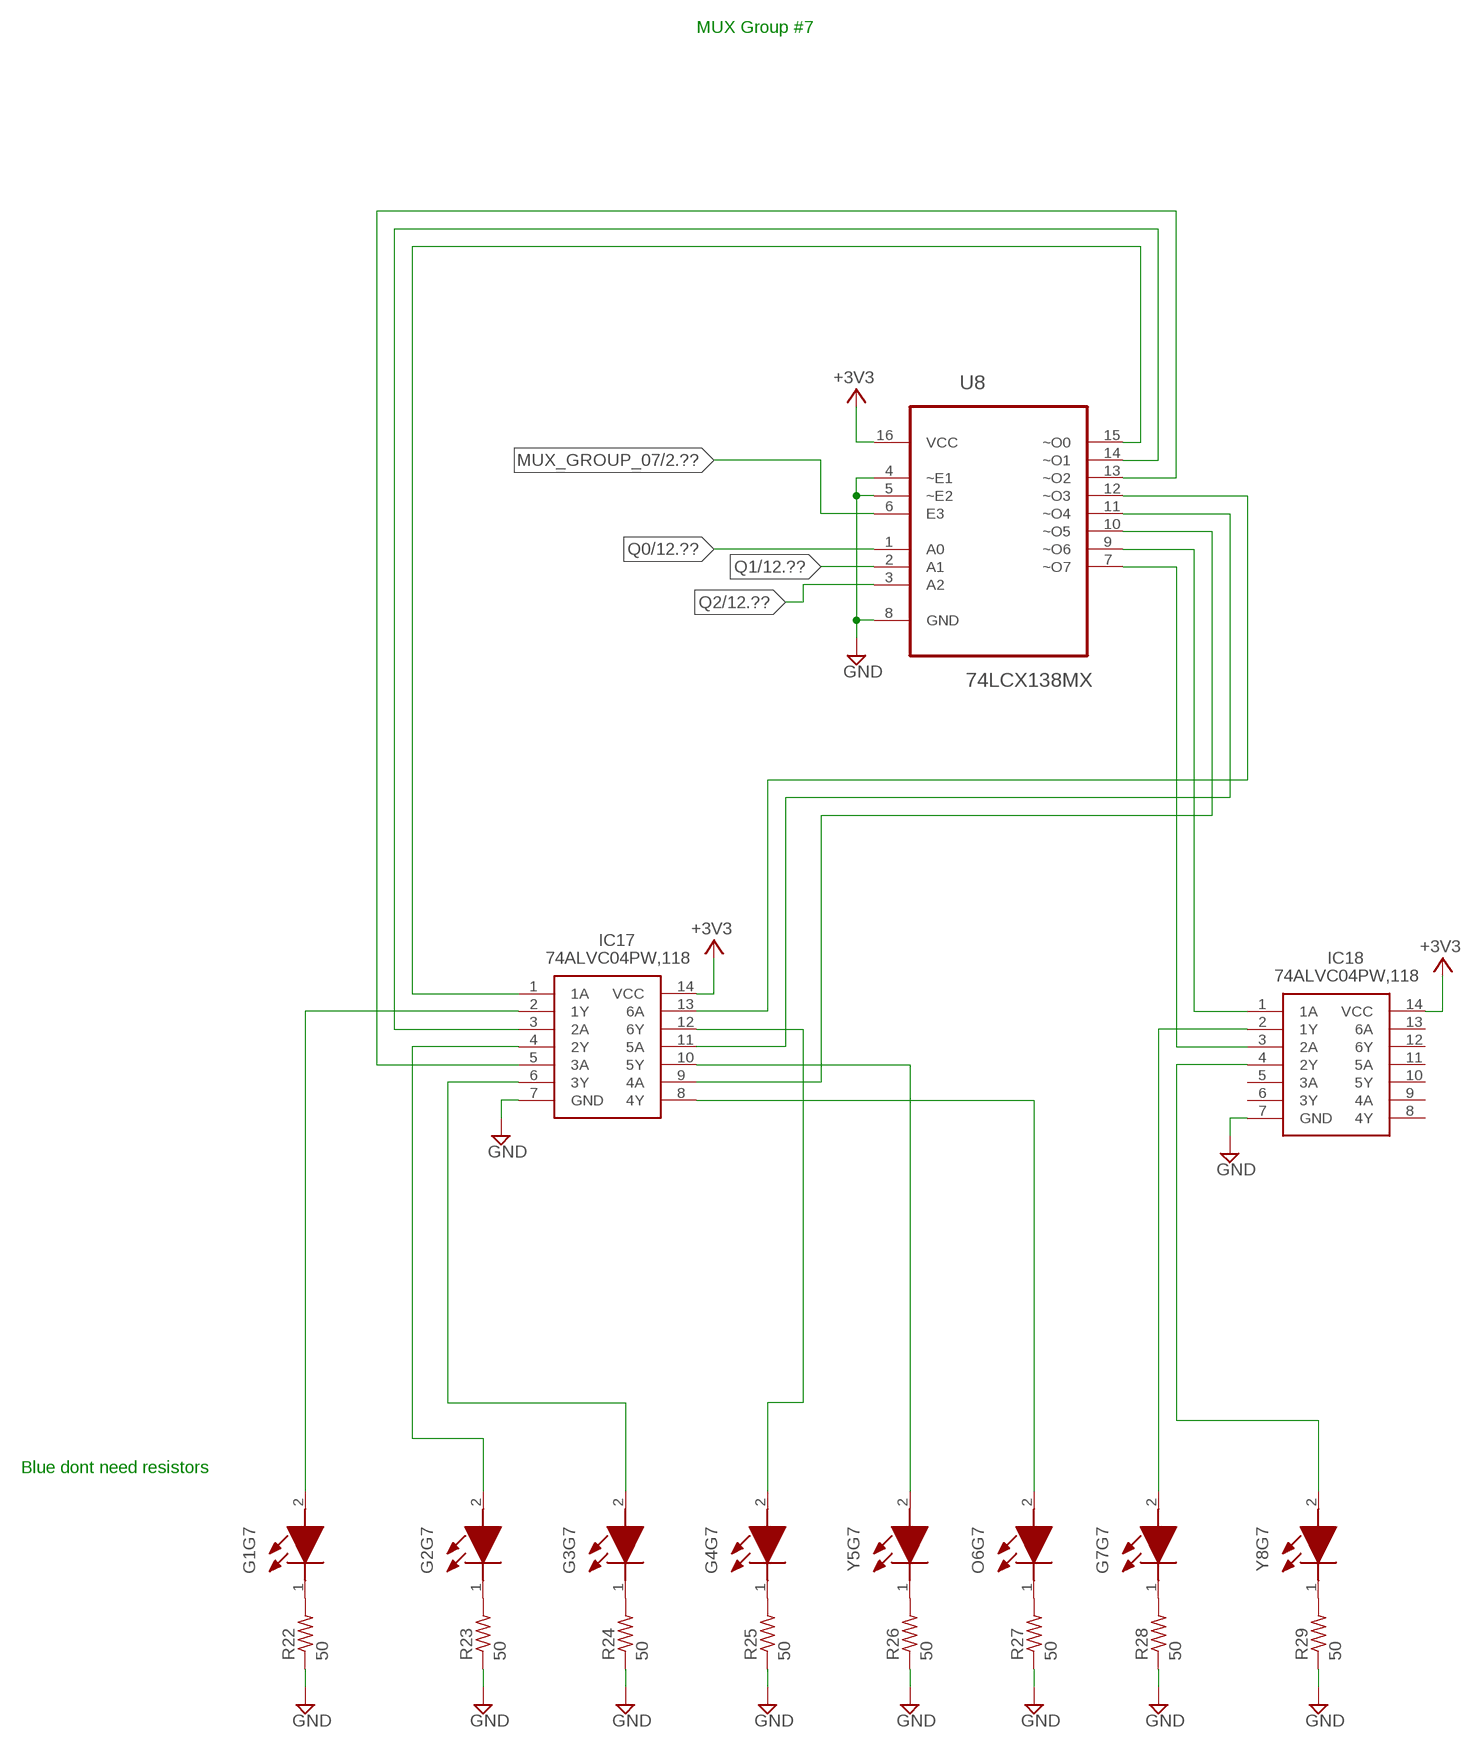
[diagram p10: schematic, sheet 11]

### Parts
G1G7  LTST-C170TBKT  [LEDC2012X120N]
G2G7  LTST-C170TBKT  [LEDC2012X120N]
G3G7  LTST-C170TBKT  [LEDC2012X120N]
G4G7  LTST-C170TBKT  [LEDC2012X120N]
G7G7  LTST-C170TBKT  [LEDC2012X120N]
IC17  74ALVC04PW,118  [SOP65P640X110-14N]
IC18  74ALVC04PW,118  [SOP65P640X110-14N]
O6G7  LTST-C170TBKT  [LEDC2012X120N]
R22  50  R-US_R0805  [R0805]
R23  50  R-US_R0805  [R0805]
R24  50  R-US_R0805  [R0805]
R25  50  R-US_R0805  [R0805]
R26  50  R-US_R0805  [R0805]
R27  50  R-US_R0805  [R0805]
R28  50  R-US_R0805  [R0805]
R29  50  R-US_R0805  [R0805]
U8  74LCX138MX  [SOIC127P600X175-16N]
Y5G7  LTST-C170TBKT  [LEDC2012X120N]
Y8G7  LTST-C170TBKT  [LEDC2012X120N]

### Nets
+3V3: IC17.14(VCC) IC18.14(VCC) U8.16(VCC) ; also sheet 1,3,4,5,6,7,8,9,10,12,13,14,15,16,17,18,19,20,21,22
GND [5v_power]: IC17.7(GND) IC18.7(GND) R22.1 R23.1 R24.1 R25.1 R26.1 R27.1 R28.1 R29.1 U8.4(~E1) U8.5(~E2) U8.8(GND) ; also sheet 1,2,3,4,5,6,7,8,9,10,12,13,14,15,16,17,18,19,20,21,22
MUX_GROUP_07: U8.6(E3) ; also sheet 2
N$116: IC17.1(1A) U8.15(~O0)
N$117: G1G7.2(A) IC17.2(1Y)
N$118: IC17.3(2A) U8.14(~O1)
N$119: G2G7.2(A) IC17.4(2Y)
N$120: IC17.5(3A) U8.13(~O2)
N$121: G3G7.2(A) IC17.6(3Y)
N$122: IC17.13(6A) U8.12(~O3)
N$123: G4G7.2(A) IC17.12(6Y)
N$124: IC17.11(5A) U8.11(~O4)
N$125: IC17.10(5Y) Y5G7.2(A)
N$126: IC17.9(4A) U8.10(~O5)
N$127: IC17.8(4Y) O6G7.2(A)
N$128: IC18.1(1A) U8.9(~O6)
N$129: G7G7.2(A) IC18.2(1Y)
N$130: IC18.3(2A) U8.7(~O7)
N$131: IC18.4(2Y) Y8G7.2(A)
N$335: G1G7.1(K) R22.2
N$336: G2G7.1(K) R23.2
N$337: G3G7.1(K) R24.2
N$338: G4G7.1(K) R25.2
N$339: R26.2 Y5G7.1(K)
N$340: O6G7.1(K) R27.2
N$341: G7G7.1(K) R28.2
N$342: R29.2 Y8G7.1(K)
Q0: U8.1(A0) ; also sheet 4,5,6,7,8,9,10,12,13,14,15,16,17,18,19,20,21,22
Q1: U8.2(A1) ; also sheet 4,5,6,7,8,9,10,12,13,14,15,16,17,18,19,20,21,22
Q2: U8.3(A2) ; also sheet 4,5,6,7,8,9,10,12,13,14,15,16,17,18,19,20,21,22
Unconnected: IC18.5(3A) IC18.6(3Y) IC18.8(4Y) IC18.9(4A) IC18.10(5Y) IC18.11(5A) IC18.12(6Y) IC18.13(6A)

### Notes on the sheet
- MUX Group #7
- Blue dont need resistors

## Sheet 12 of 22: MUX Group #8
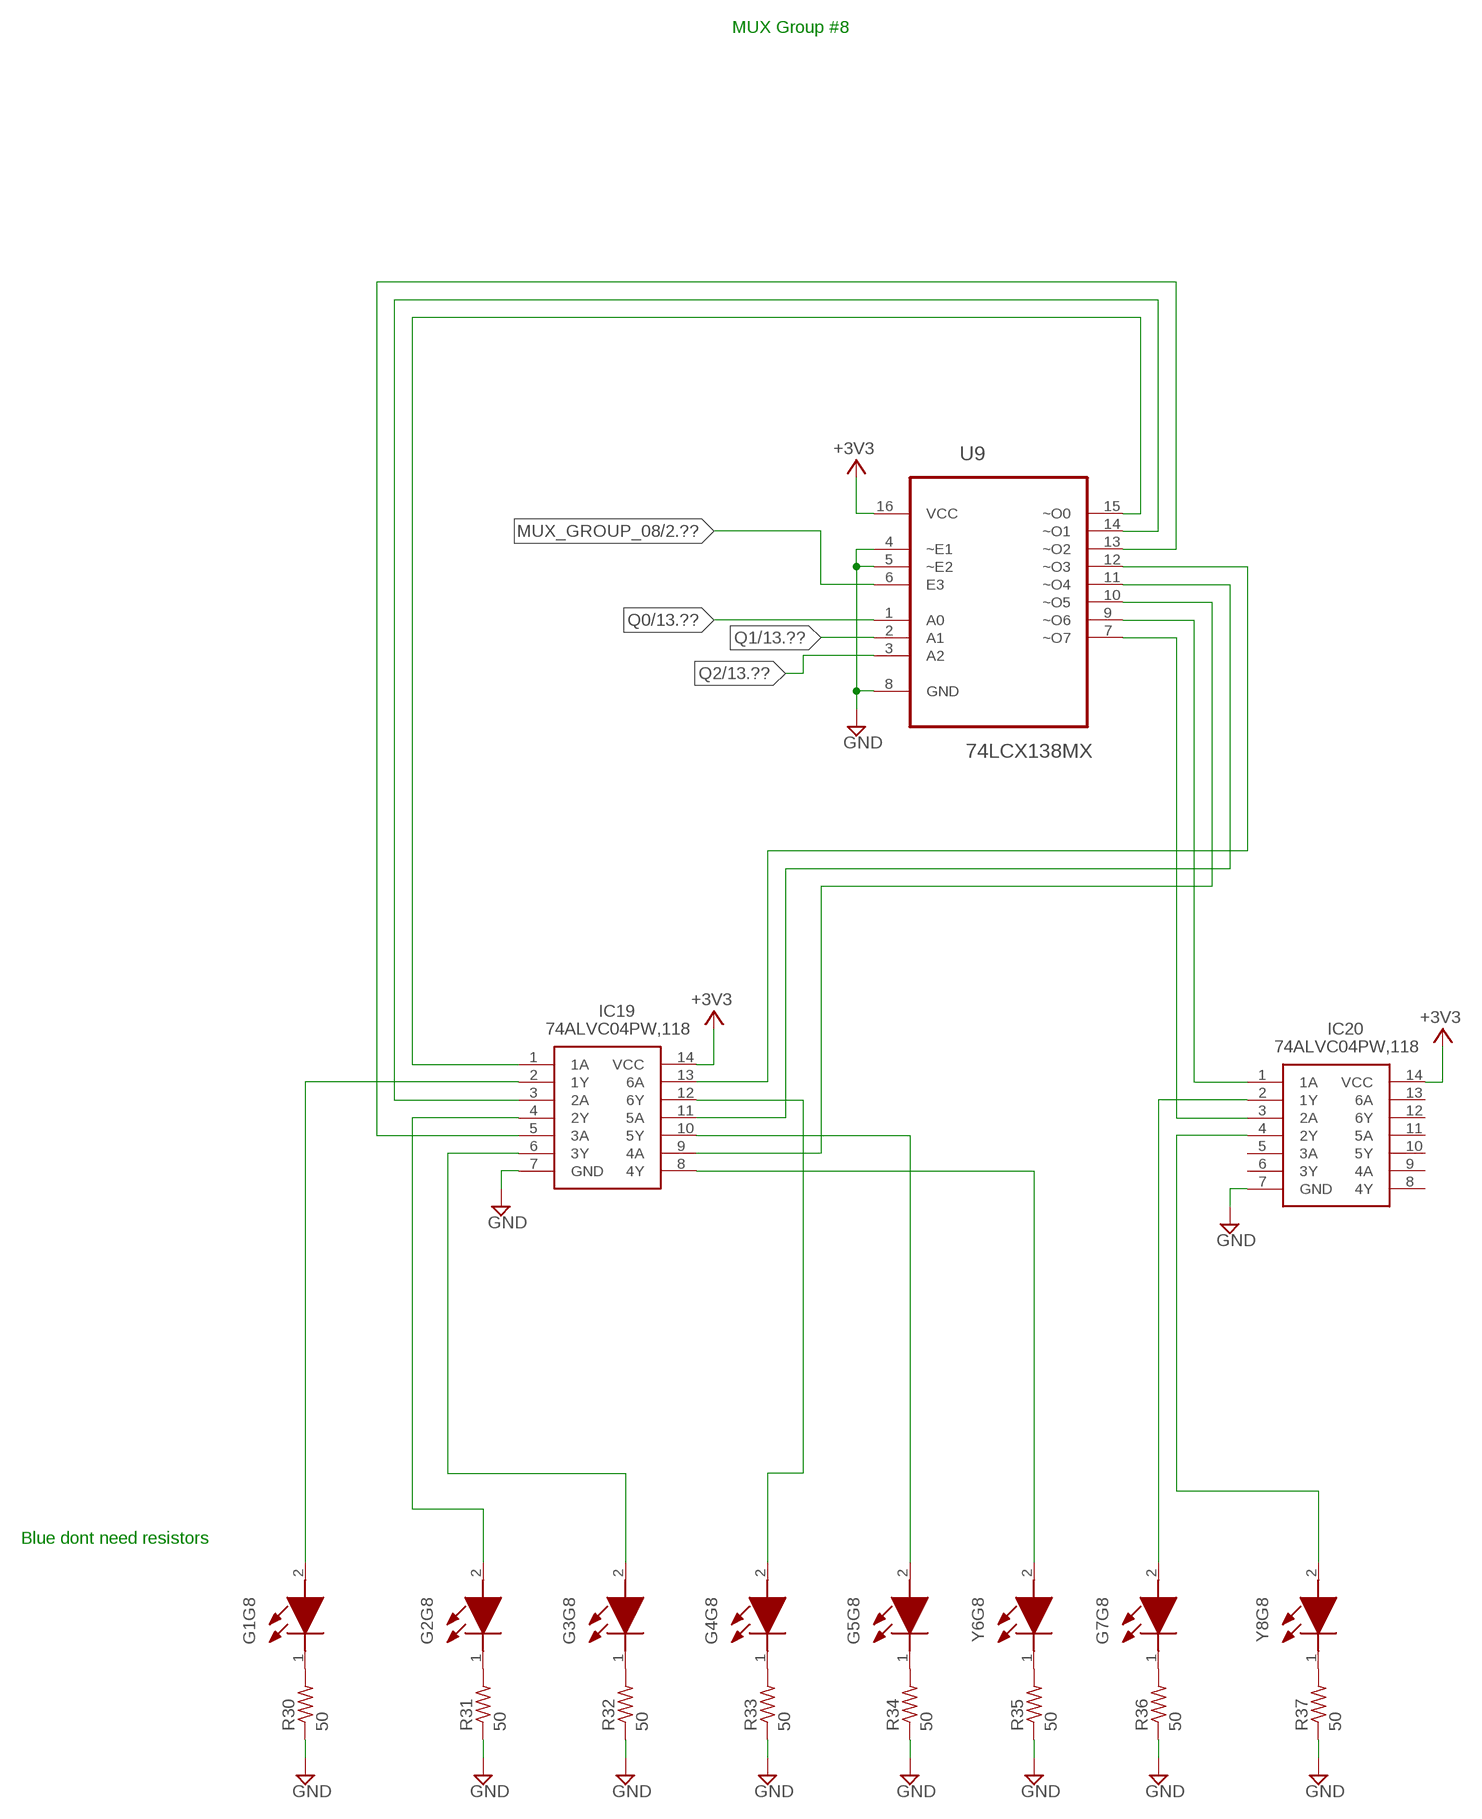
[diagram p11: schematic, sheet 12]

### Parts
G1G8  LTST-C170TBKT  [LEDC2012X120N]
G2G8  LTST-C170TBKT  [LEDC2012X120N]
G3G8  LTST-C170TBKT  [LEDC2012X120N]
G4G8  LTST-C170TBKT  [LEDC2012X120N]
G5G8  LTST-C170TBKT  [LEDC2012X120N]
G7G8  LTST-C170TBKT  [LEDC2012X120N]
IC19  74ALVC04PW,118  [SOP65P640X110-14N]
IC20  74ALVC04PW,118  [SOP65P640X110-14N]
R30  50  R-US_R0805  [R0805]
R31  50  R-US_R0805  [R0805]
R32  50  R-US_R0805  [R0805]
R33  50  R-US_R0805  [R0805]
R34  50  R-US_R0805  [R0805]
R35  50  R-US_R0805  [R0805]
R36  50  R-US_R0805  [R0805]
R37  50  R-US_R0805  [R0805]
U9  74LCX138MX  [SOIC127P600X175-16N]
Y6G8  LTST-C170TBKT  [LEDC2012X120N]
Y8G8  LTST-C170TBKT  [LEDC2012X120N]

### Nets
+3V3: IC19.14(VCC) IC20.14(VCC) U9.16(VCC) ; also sheet 1,3,4,5,6,7,8,9,10,11,13,14,15,16,17,18,19,20,21,22
GND [5v_power]: IC19.7(GND) IC20.7(GND) R30.1 R31.1 R32.1 R33.1 R34.1 R35.1 R36.1 R37.1 U9.4(~E1) U9.5(~E2) U9.8(GND) ; also sheet 1,2,3,4,5,6,7,8,9,10,11,13,14,15,16,17,18,19,20,21,22
MUX_GROUP_08: U9.6(E3) ; also sheet 2
N$133: IC19.1(1A) U9.15(~O0)
N$134: G1G8.2(A) IC19.2(1Y)
N$135: IC19.3(2A) U9.14(~O1)
N$136: G2G8.2(A) IC19.4(2Y)
N$137: IC19.5(3A) U9.13(~O2)
N$138: G3G8.2(A) IC19.6(3Y)
N$139: IC19.13(6A) U9.12(~O3)
N$140: G4G8.2(A) IC19.12(6Y)
N$141: IC19.11(5A) U9.11(~O4)
N$142: G5G8.2(A) IC19.10(5Y)
N$143: IC19.9(4A) U9.10(~O5)
N$144: IC19.8(4Y) Y6G8.2(A)
N$145: IC20.1(1A) U9.9(~O6)
N$146: G7G8.2(A) IC20.2(1Y)
N$147: IC20.3(2A) U9.7(~O7)
N$148: IC20.4(2Y) Y8G8.2(A)
N$343: G1G8.1(K) R30.2
N$344: G2G8.1(K) R31.2
N$345: G3G8.1(K) R32.2
N$346: G4G8.1(K) R33.2
N$347: G5G8.1(K) R34.2
N$348: R35.2 Y6G8.1(K)
N$349: G7G8.1(K) R36.2
N$350: R37.2 Y8G8.1(K)
Q0: U9.1(A0) ; also sheet 4,5,6,7,8,9,10,11,13,14,15,16,17,18,19,20,21,22
Q1: U9.2(A1) ; also sheet 4,5,6,7,8,9,10,11,13,14,15,16,17,18,19,20,21,22
Q2: U9.3(A2) ; also sheet 4,5,6,7,8,9,10,11,13,14,15,16,17,18,19,20,21,22
Unconnected: IC20.5(3A) IC20.6(3Y) IC20.8(4Y) IC20.9(4A) IC20.10(5Y) IC20.11(5A) IC20.12(6Y) IC20.13(6A)

### Notes on the sheet
- MUX Group #8
- Blue dont need resistors

## Sheet 13 of 22: MUX Group #9
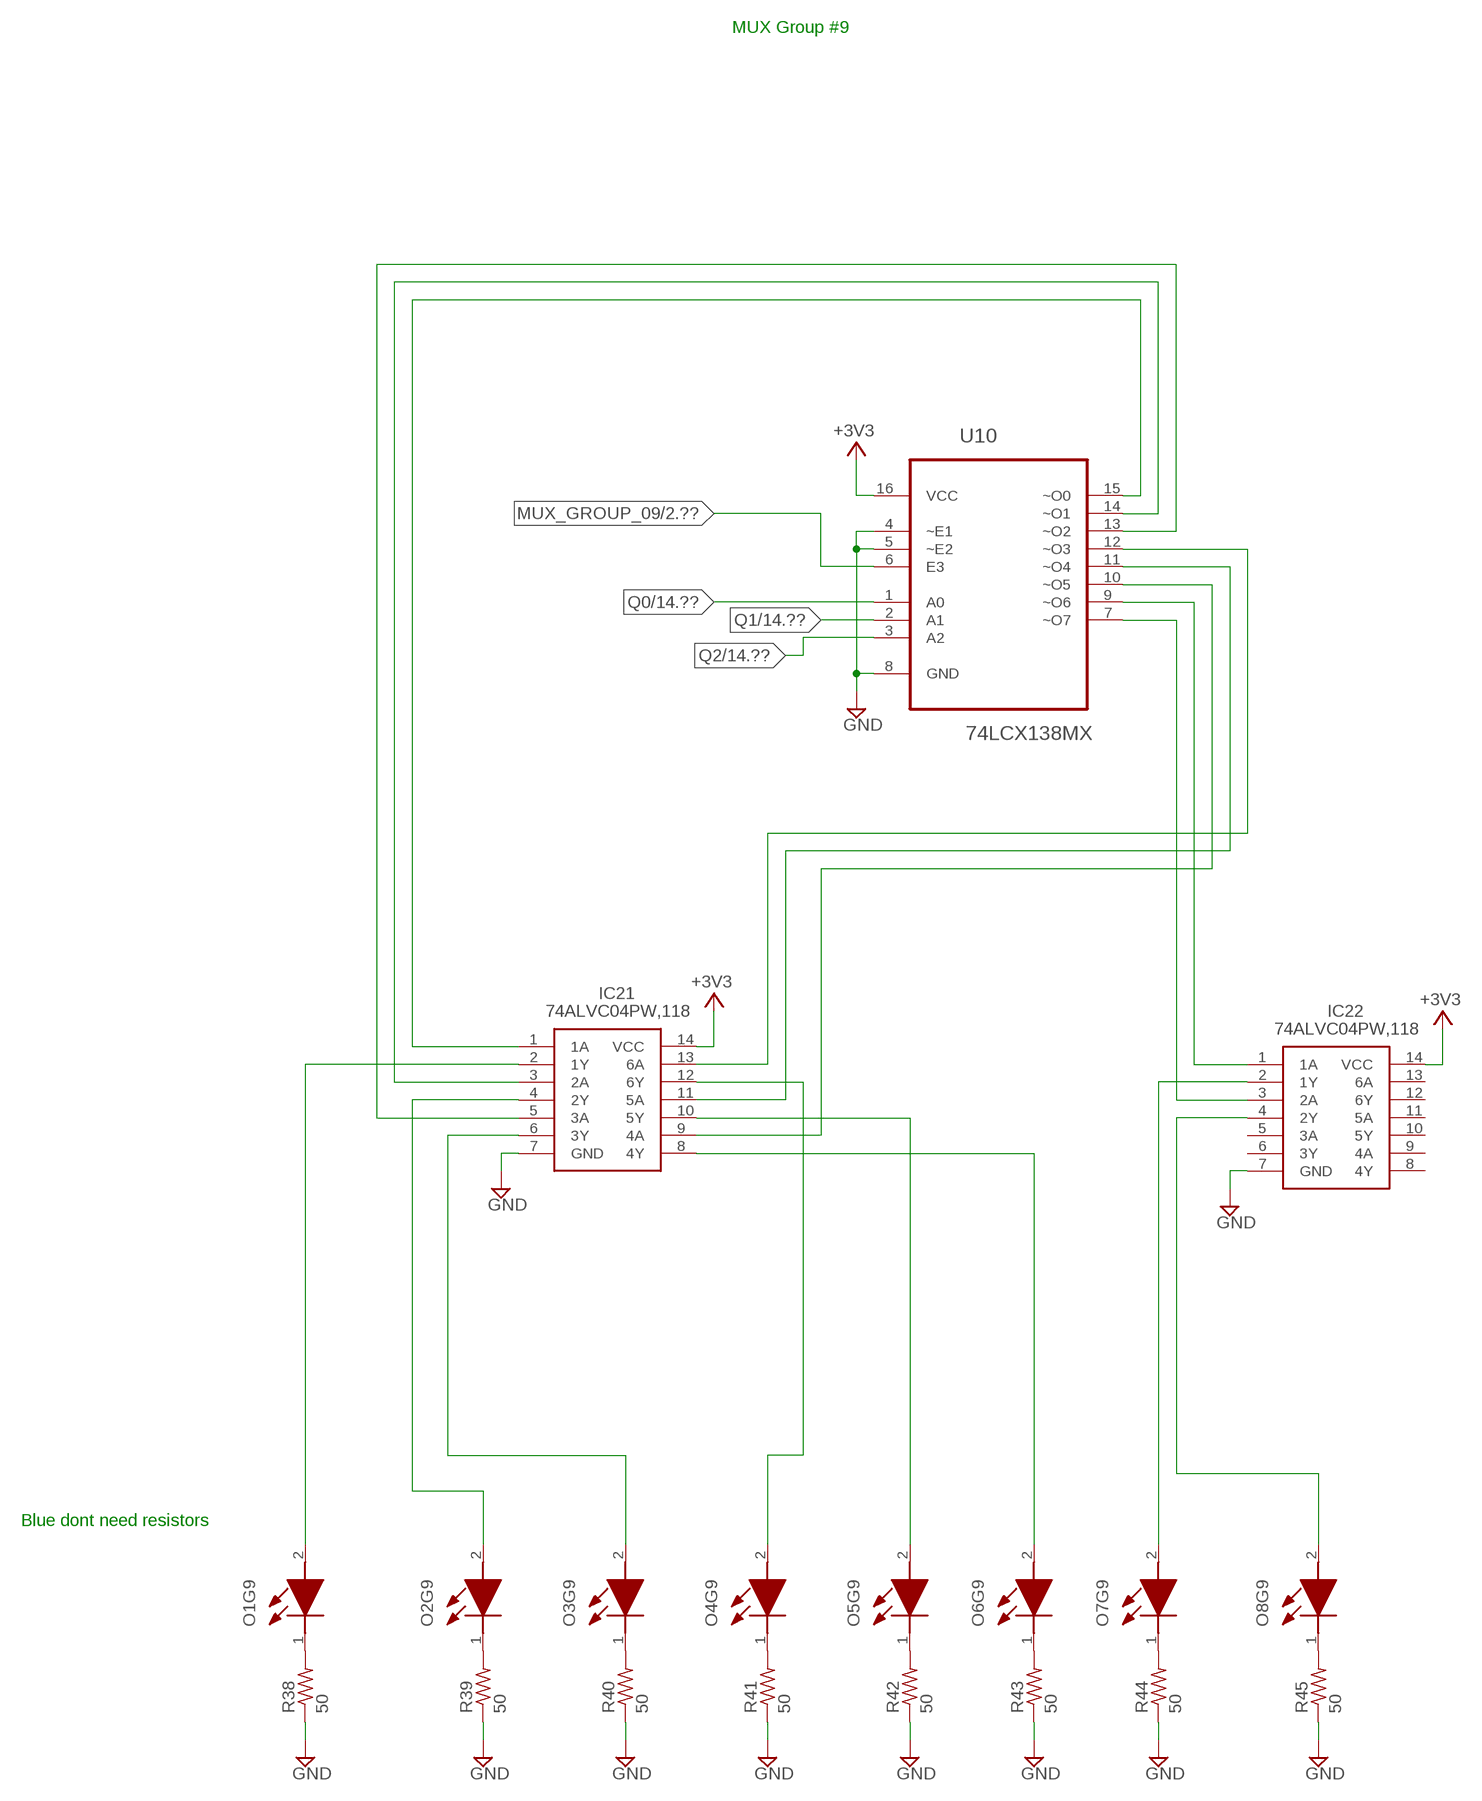
[diagram p12: schematic, sheet 13]

### Parts
IC21  74ALVC04PW,118  [SOP65P640X110-14N]
IC22  74ALVC04PW,118  [SOP65P640X110-14N]
O1G9  LTST-C170TBKT  [LEDC2012X120N]
O2G9  LTST-C170TBKT  [LEDC2012X120N]
O3G9  LTST-C170TBKT  [LEDC2012X120N]
O4G9  LTST-C170TBKT  [LEDC2012X120N]
O5G9  LTST-C170TBKT  [LEDC2012X120N]
O6G9  LTST-C170TBKT  [LEDC2012X120N]
O7G9  LTST-C170TBKT  [LEDC2012X120N]
O8G9  LTST-C170TBKT  [LEDC2012X120N]
R38  50  R-US_R0805  [R0805]
R39  50  R-US_R0805  [R0805]
R40  50  R-US_R0805  [R0805]
R41  50  R-US_R0805  [R0805]
R42  50  R-US_R0805  [R0805]
R43  50  R-US_R0805  [R0805]
R44  50  R-US_R0805  [R0805]
R45  50  R-US_R0805  [R0805]
U10  74LCX138MX  [SOIC127P600X175-16N]

### Nets
+3V3: IC21.14(VCC) IC22.14(VCC) U10.16(VCC) ; also sheet 1,3,4,5,6,7,8,9,10,11,12,14,15,16,17,18,19,20,21,22
GND [5v_power]: IC21.7(GND) IC22.7(GND) R38.1 R39.1 R40.1 R41.1 R42.1 R43.1 R44.1 R45.1 U10.4(~E1) U10.5(~E2) U10.8(GND) ; also sheet 1,2,3,4,5,6,7,8,9,10,11,12,14,15,16,17,18,19,20,21,22
MUX_GROUP_09: U10.6(E3) ; also sheet 2
N$150: IC21.1(1A) U10.15(~O0)
N$151: IC21.2(1Y) O1G9.2(A)
N$152: IC21.3(2A) U10.14(~O1)
N$153: IC21.4(2Y) O2G9.2(A)
N$154: IC21.5(3A) U10.13(~O2)
N$155: IC21.6(3Y) O3G9.2(A)
N$156: IC21.13(6A) U10.12(~O3)
N$157: IC21.12(6Y) O4G9.2(A)
N$158: IC21.11(5A) U10.11(~O4)
N$159: IC21.10(5Y) O5G9.2(A)
N$160: IC21.9(4A) U10.10(~O5)
N$161: IC21.8(4Y) O6G9.2(A)
N$162: IC22.1(1A) U10.9(~O6)
N$163: IC22.2(1Y) O7G9.2(A)
N$164: IC22.3(2A) U10.7(~O7)
N$165: IC22.4(2Y) O8G9.2(A)
N$351: O1G9.1(K) R38.2
N$352: O2G9.1(K) R39.2
N$353: O3G9.1(K) R40.2
N$354: O4G9.1(K) R41.2
N$355: O5G9.1(K) R42.2
N$356: O7G9.1(K) R44.2
N$357: O8G9.1(K) R45.2
N$358: O6G9.1(K) R43.2
Q0: U10.1(A0) ; also sheet 4,5,6,7,8,9,10,11,12,14,15,16,17,18,19,20,21,22
Q1: U10.2(A1) ; also sheet 4,5,6,7,8,9,10,11,12,14,15,16,17,18,19,20,21,22
Q2: U10.3(A2) ; also sheet 4,5,6,7,8,9,10,11,12,14,15,16,17,18,19,20,21,22
Unconnected: IC22.5(3A) IC22.6(3Y) IC22.8(4Y) IC22.9(4A) IC22.10(5Y) IC22.11(5A) IC22.12(6Y) IC22.13(6A)

### Notes on the sheet
- MUX Group #9
- Blue dont need resistors

## Sheet 14 of 22: MUX Group #10
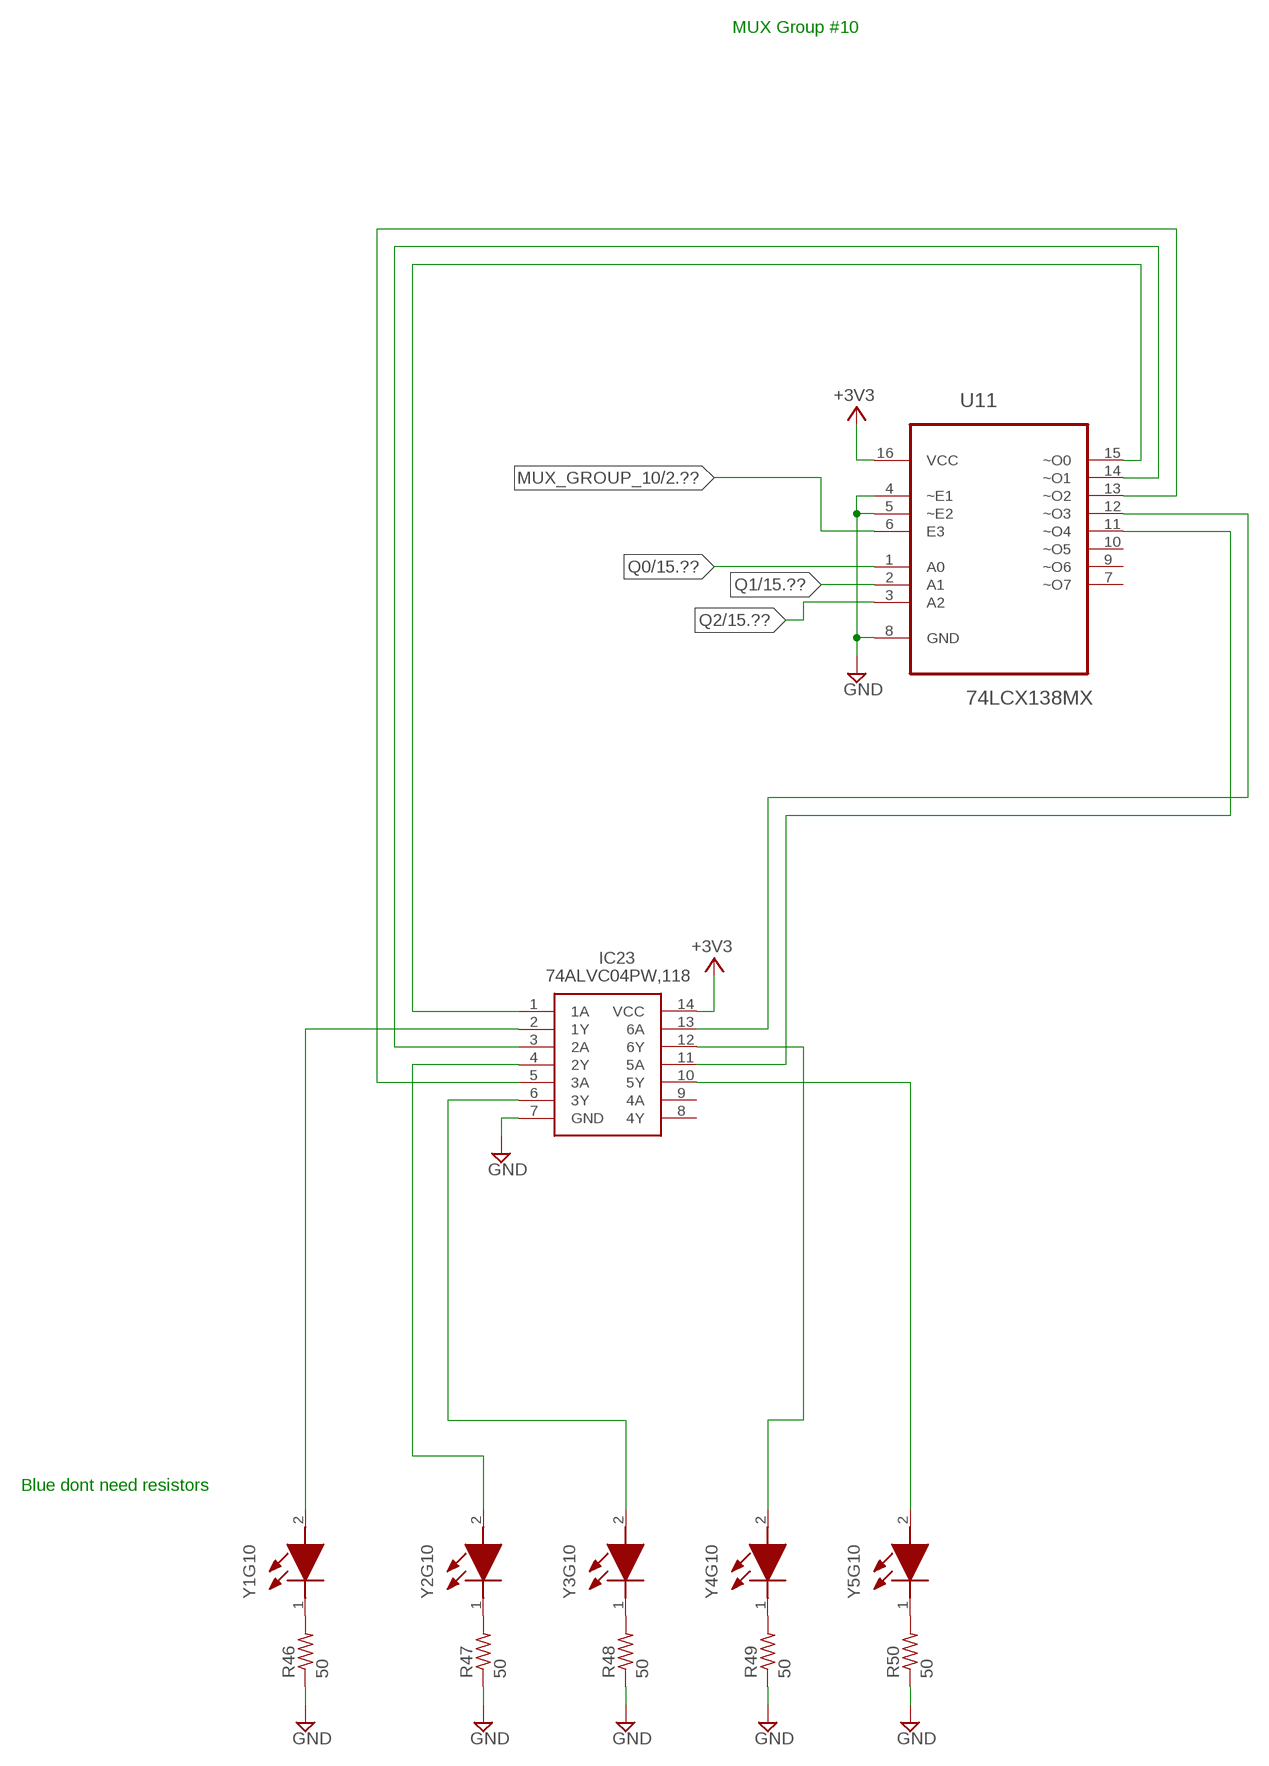
[diagram p13: schematic, sheet 14]

### Parts
IC23  74ALVC04PW,118  [SOP65P640X110-14N]
R46  50  R-US_R0805  [R0805]
R47  50  R-US_R0805  [R0805]
R48  50  R-US_R0805  [R0805]
R49  50  R-US_R0805  [R0805]
R50  50  R-US_R0805  [R0805]
U11  74LCX138MX  [SOIC127P600X175-16N]
Y1G10  LTST-C170TBKT  [LEDC2012X120N]
Y2G10  LTST-C170TBKT  [LEDC2012X120N]
Y3G10  LTST-C170TBKT  [LEDC2012X120N]
Y4G10  LTST-C170TBKT  [LEDC2012X120N]
Y5G10  LTST-C170TBKT  [LEDC2012X120N]

### Nets
+3V3: IC23.14(VCC) U11.16(VCC) ; also sheet 1,3,4,5,6,7,8,9,10,11,12,13,15,16,17,18,19,20,21,22
GND [5v_power]: IC23.7(GND) R46.1 R47.1 R48.1 R49.1 R50.1 U11.4(~E1) U11.5(~E2) U11.8(GND) ; also sheet 1,2,3,4,5,6,7,8,9,10,11,12,13,15,16,17,18,19,20,21,22
MUX_GROUP_10: U11.6(E3) ; also sheet 2
N$167: IC23.1(1A) U11.15(~O0)
N$168: IC23.2(1Y) Y1G10.2(A)
N$169: IC23.3(2A) U11.14(~O1)
N$170: IC23.4(2Y) Y2G10.2(A)
N$171: IC23.5(3A) U11.13(~O2)
N$172: IC23.6(3Y) Y3G10.2(A)
N$173: IC23.13(6A) U11.12(~O3)
N$174: IC23.12(6Y) Y4G10.2(A)
N$175: IC23.11(5A) U11.11(~O4)
N$176: IC23.10(5Y) Y5G10.2(A)
N$179: R46.2 Y1G10.1(K)
N$180: R47.2 Y2G10.1(K)
N$181: R48.2 Y3G10.1(K)
N$182: R49.2 Y4G10.1(K)
N$359: R50.2 Y5G10.1(K)
Q0: U11.1(A0) ; also sheet 4,5,6,7,8,9,10,11,12,13,15,16,17,18,19,20,21,22
Q1: U11.2(A1) ; also sheet 4,5,6,7,8,9,10,11,12,13,15,16,17,18,19,20,21,22
Q2: U11.3(A2) ; also sheet 4,5,6,7,8,9,10,11,12,13,15,16,17,18,19,20,21,22
Unconnected: IC23.8(4Y) IC23.9(4A) U11.7(~O7) U11.9(~O6) U11.10(~O5)

### Notes on the sheet
- MUX Group #10
- Blue dont need resistors

## Sheet 15 of 22: MUX Group #11
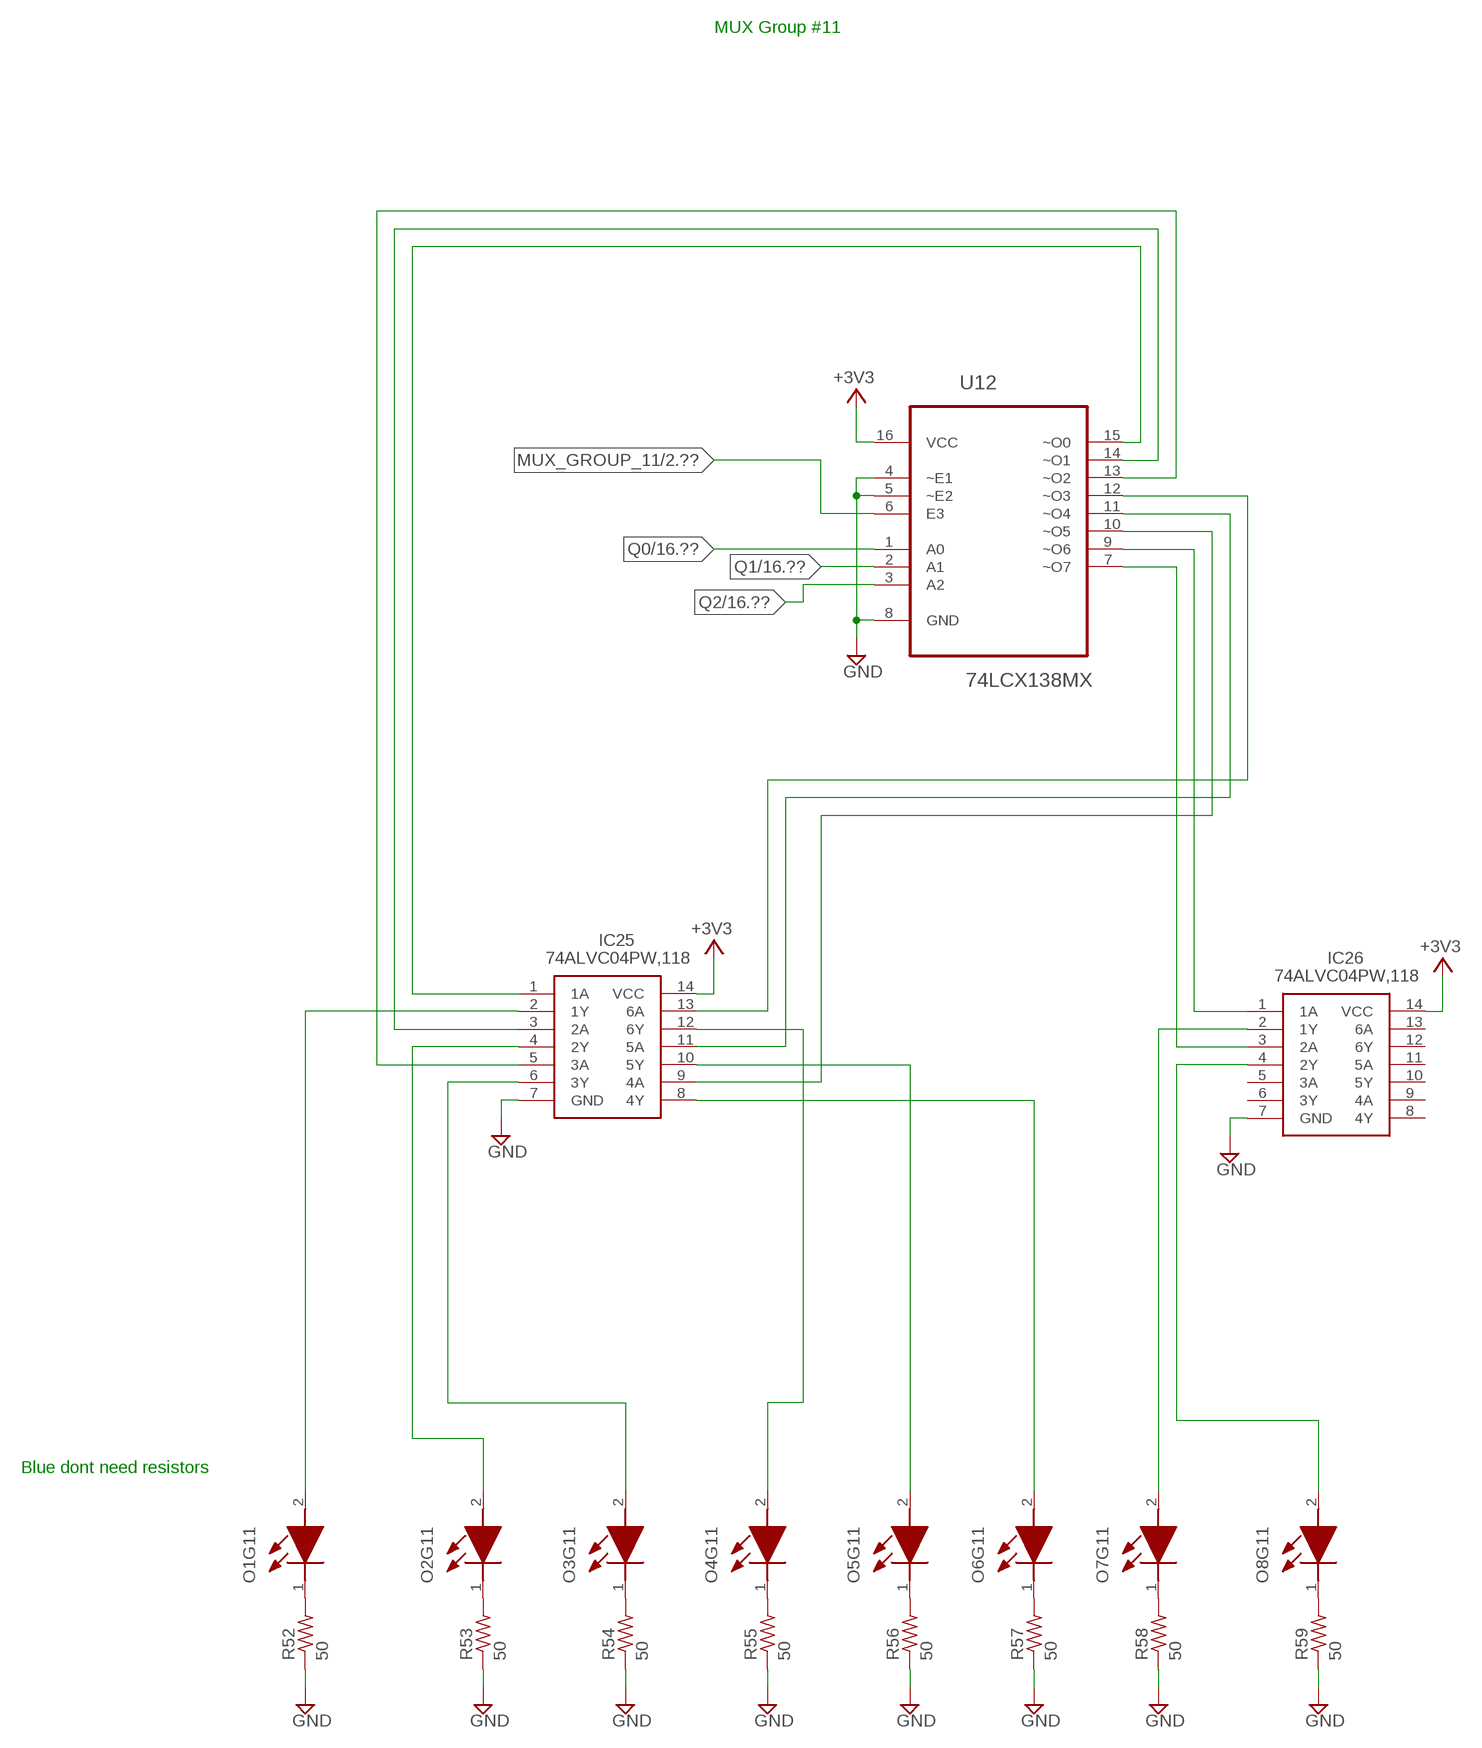
[diagram p14: schematic, sheet 15]

### Parts
IC25  74ALVC04PW,118  [SOP65P640X110-14N]
IC26  74ALVC04PW,118  [SOP65P640X110-14N]
O1G11  LTST-C170TBKT  [LEDC2012X120N]
O2G11  LTST-C170TBKT  [LEDC2012X120N]
O3G11  LTST-C170TBKT  [LEDC2012X120N]
O4G11  LTST-C170TBKT  [LEDC2012X120N]
O5G11  LTST-C170TBKT  [LEDC2012X120N]
O6G11  LTST-C170TBKT  [LEDC2012X120N]
O7G11  LTST-C170TBKT  [LEDC2012X120N]
O8G11  LTST-C170TBKT  [LEDC2012X120N]
R52  50  R-US_R0805  [R0805]
R53  50  R-US_R0805  [R0805]
R54  50  R-US_R0805  [R0805]
R55  50  R-US_R0805  [R0805]
R56  50  R-US_R0805  [R0805]
R57  50  R-US_R0805  [R0805]
R58  50  R-US_R0805  [R0805]
R59  50  R-US_R0805  [R0805]
U12  74LCX138MX  [SOIC127P600X175-16N]

### Nets
+3V3: IC25.14(VCC) IC26.14(VCC) U12.16(VCC) ; also sheet 1,3,4,5,6,7,8,9,10,11,12,13,14,16,17,18,19,20,21,22
GND [5v_power]: IC25.7(GND) IC26.7(GND) R52.1 R53.1 R54.1 R55.1 R56.1 R57.1 R58.1 R59.1 U12.4(~E1) U12.5(~E2) U12.8(GND) ; also sheet 1,2,3,4,5,6,7,8,9,10,11,12,13,14,16,17,18,19,20,21,22
MUX_GROUP_11: U12.6(E3) ; also sheet 2
N$184: IC25.1(1A) U12.15(~O0)
N$185: IC25.2(1Y) O1G11.2(A)
N$186: IC25.3(2A) U12.14(~O1)
N$187: IC25.4(2Y) O2G11.2(A)
N$188: IC25.5(3A) U12.13(~O2)
N$189: IC25.6(3Y) O3G11.2(A)
N$190: IC25.13(6A) U12.12(~O3)
N$191: IC25.12(6Y) O4G11.2(A)
N$192: IC25.11(5A) U12.11(~O4)
N$193: IC25.10(5Y) O5G11.2(A)
N$194: IC25.9(4A) U12.10(~O5)
N$195: IC25.8(4Y) O6G11.2(A)
N$196: IC26.1(1A) U12.9(~O6)
N$197: IC26.2(1Y) O7G11.2(A)
N$198: IC26.3(2A) U12.7(~O7)
N$199: IC26.4(2Y) O8G11.2(A)
N$361: O1G11.1(K) R52.2
N$362: O2G11.1(K) R53.2
N$363: O3G11.1(K) R54.2
N$364: O4G11.1(K) R55.2
N$365: O5G11.1(K) R56.2
N$366: O6G11.1(K) R57.2
N$367: O7G11.1(K) R58.2
N$368: O8G11.1(K) R59.2
Q0: U12.1(A0) ; also sheet 4,5,6,7,8,9,10,11,12,13,14,16,17,18,19,20,21,22
Q1: U12.2(A1) ; also sheet 4,5,6,7,8,9,10,11,12,13,14,16,17,18,19,20,21,22
Q2: U12.3(A2) ; also sheet 4,5,6,7,8,9,10,11,12,13,14,16,17,18,19,20,21,22
Unconnected: IC26.5(3A) IC26.6(3Y) IC26.8(4Y) IC26.9(4A) IC26.10(5Y) IC26.11(5A) IC26.12(6Y) IC26.13(6A)

### Notes on the sheet
- MUX Group #11
- Blue dont need resistors

## Sheet 16 of 22: MUX Group #12
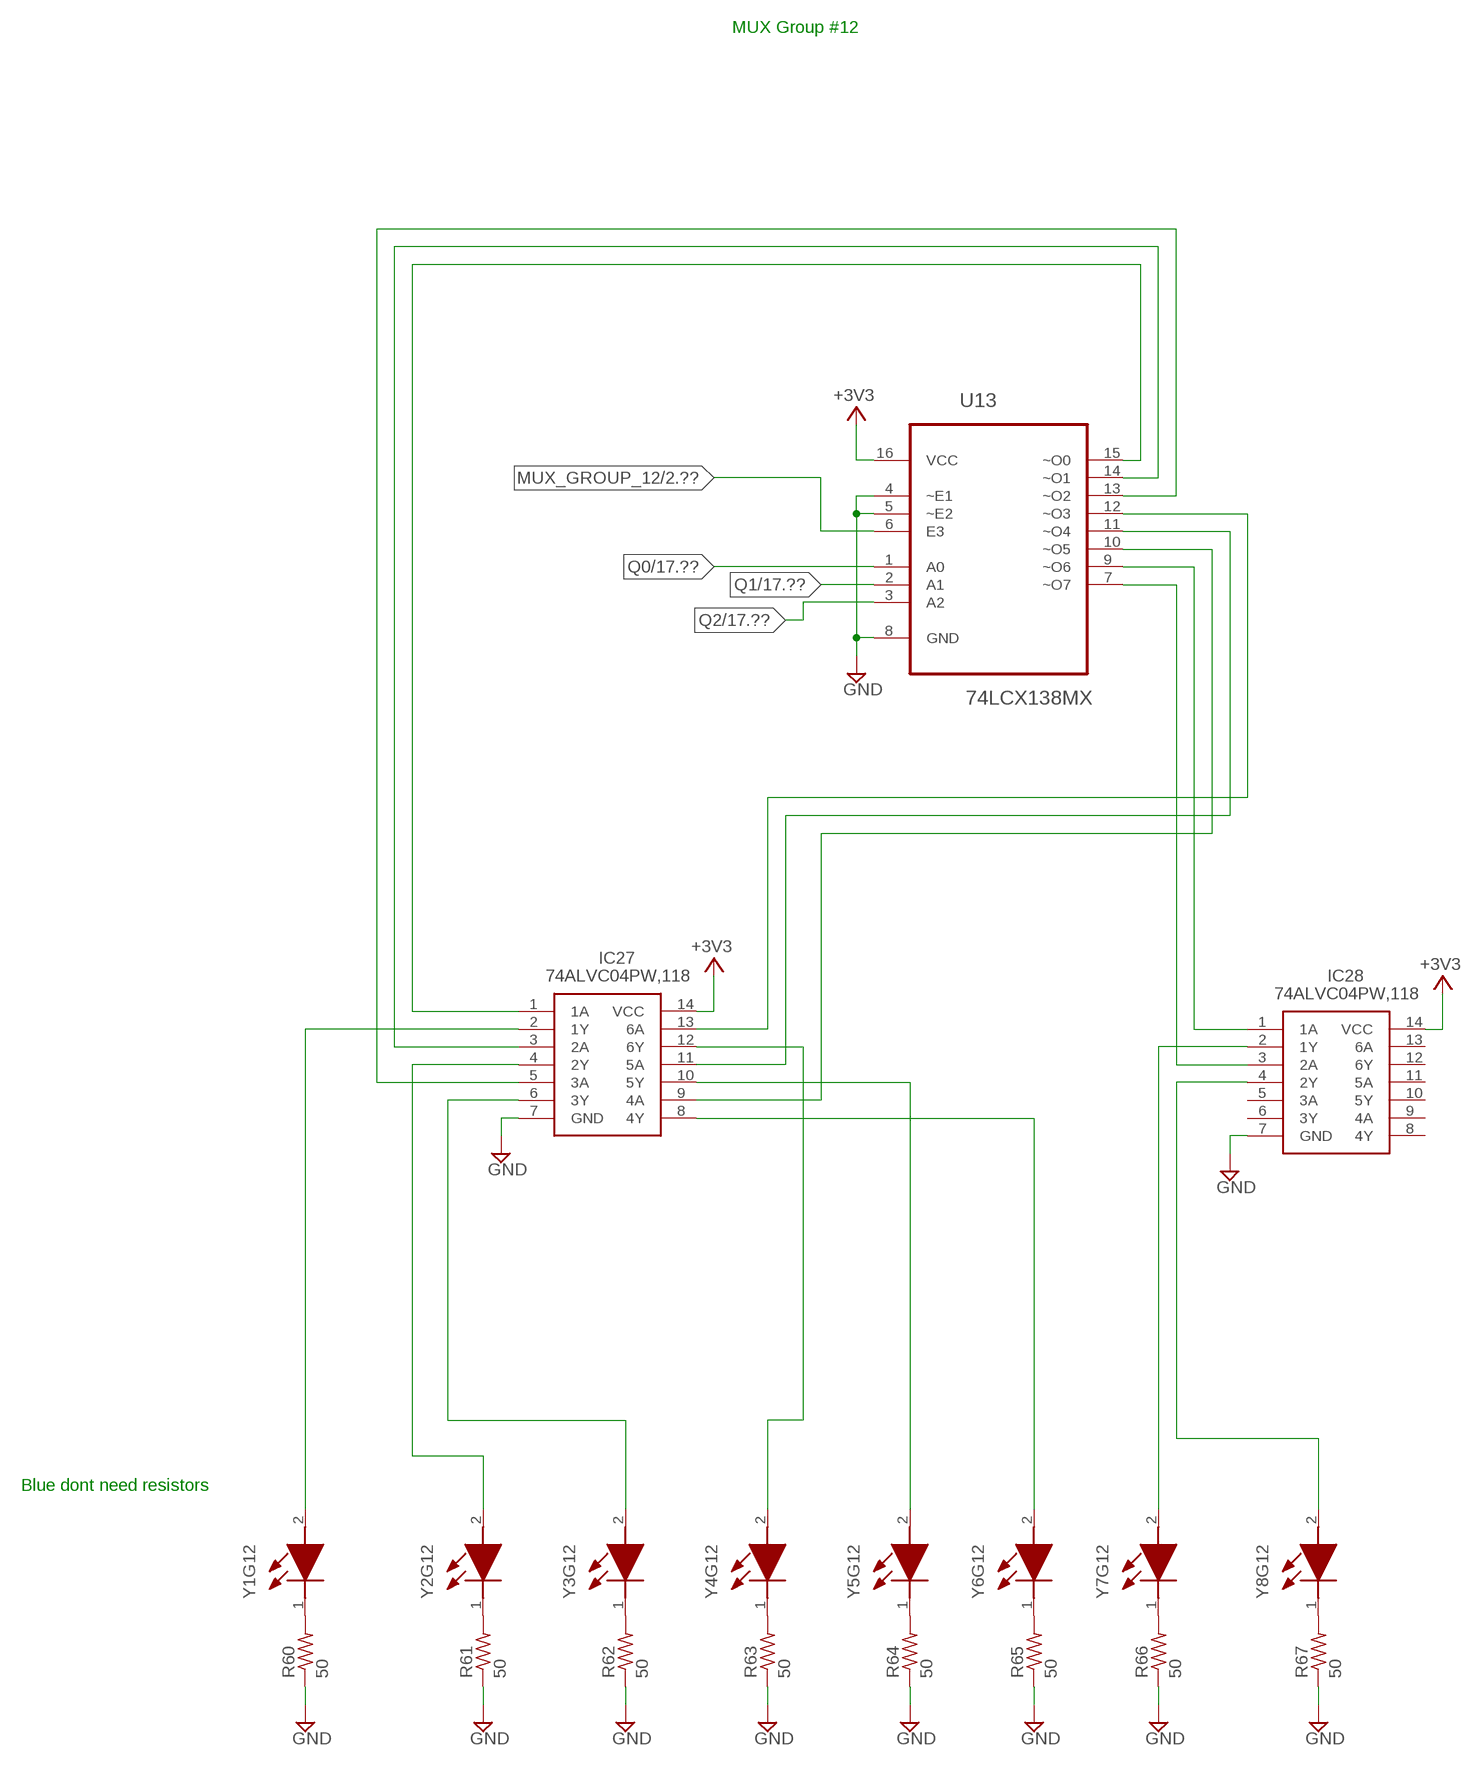
[diagram p15: schematic, sheet 16]

### Parts
IC27  74ALVC04PW,118  [SOP65P640X110-14N]
IC28  74ALVC04PW,118  [SOP65P640X110-14N]
R60  50  R-US_R0805  [R0805]
R61  50  R-US_R0805  [R0805]
R62  50  R-US_R0805  [R0805]
R63  50  R-US_R0805  [R0805]
R64  50  R-US_R0805  [R0805]
R65  50  R-US_R0805  [R0805]
R66  50  R-US_R0805  [R0805]
R67  50  R-US_R0805  [R0805]
U13  74LCX138MX  [SOIC127P600X175-16N]
Y1G12  LTST-C170TBKT  [LEDC2012X120N]
Y2G12  LTST-C170TBKT  [LEDC2012X120N]
Y3G12  LTST-C170TBKT  [LEDC2012X120N]
Y4G12  LTST-C170TBKT  [LEDC2012X120N]
Y5G12  LTST-C170TBKT  [LEDC2012X120N]
Y6G12  LTST-C170TBKT  [LEDC2012X120N]
Y7G12  LTST-C170TBKT  [LEDC2012X120N]
Y8G12  LTST-C170TBKT  [LEDC2012X120N]

### Nets
+3V3: IC27.14(VCC) IC28.14(VCC) U13.16(VCC) ; also sheet 1,3,4,5,6,7,8,9,10,11,12,13,14,15,17,18,19,20,21,22
GND [5v_power]: IC27.7(GND) IC28.7(GND) R60.1 R61.1 R62.1 R63.1 R64.1 R65.1 R66.1 R67.1 U13.4(~E1) U13.5(~E2) U13.8(GND) ; also sheet 1,2,3,4,5,6,7,8,9,10,11,12,13,14,15,17,18,19,20,21,22
MUX_GROUP_12: U13.6(E3) ; also sheet 2
N$201: IC27.1(1A) U13.15(~O0)
N$202: IC27.2(1Y) Y1G12.2(A)
N$203: IC27.3(2A) U13.14(~O1)
N$204: IC27.4(2Y) Y2G12.2(A)
N$205: IC27.5(3A) U13.13(~O2)
N$206: IC27.6(3Y) Y3G12.2(A)
N$207: IC27.13(6A) U13.12(~O3)
N$208: IC27.12(6Y) Y4G12.2(A)
N$209: IC27.11(5A) U13.11(~O4)
N$210: IC27.10(5Y) Y5G12.2(A)
N$211: IC27.9(4A) U13.10(~O5)
N$212: IC27.8(4Y) Y6G12.2(A)
N$213: IC28.1(1A) U13.9(~O6)
N$214: IC28.2(1Y) Y7G12.2(A)
N$215: IC28.3(2A) U13.7(~O7)
N$216: IC28.4(2Y) Y8G12.2(A)
N$369: R60.2 Y1G12.1(K)
N$370: R61.2 Y2G12.1(K)
N$371: R62.2 Y3G12.1(K)
N$372: R63.2 Y4G12.1(K)
N$373: R64.2 Y5G12.1(K)
N$374: R65.2 Y6G12.1(K)
N$375: R66.2 Y7G12.1(K)
N$376: R67.2 Y8G12.1(K)
Q0: U13.1(A0) ; also sheet 4,5,6,7,8,9,10,11,12,13,14,15,17,18,19,20,21,22
Q1: U13.2(A1) ; also sheet 4,5,6,7,8,9,10,11,12,13,14,15,17,18,19,20,21,22
Q2: U13.3(A2) ; also sheet 4,5,6,7,8,9,10,11,12,13,14,15,17,18,19,20,21,22
Unconnected: IC28.5(3A) IC28.6(3Y) IC28.8(4Y) IC28.9(4A) IC28.10(5Y) IC28.11(5A) IC28.12(6Y) IC28.13(6A)

### Notes on the sheet
- MUX Group #12
- Blue dont need resistors

## Sheet 17 of 22: MUX Group #13
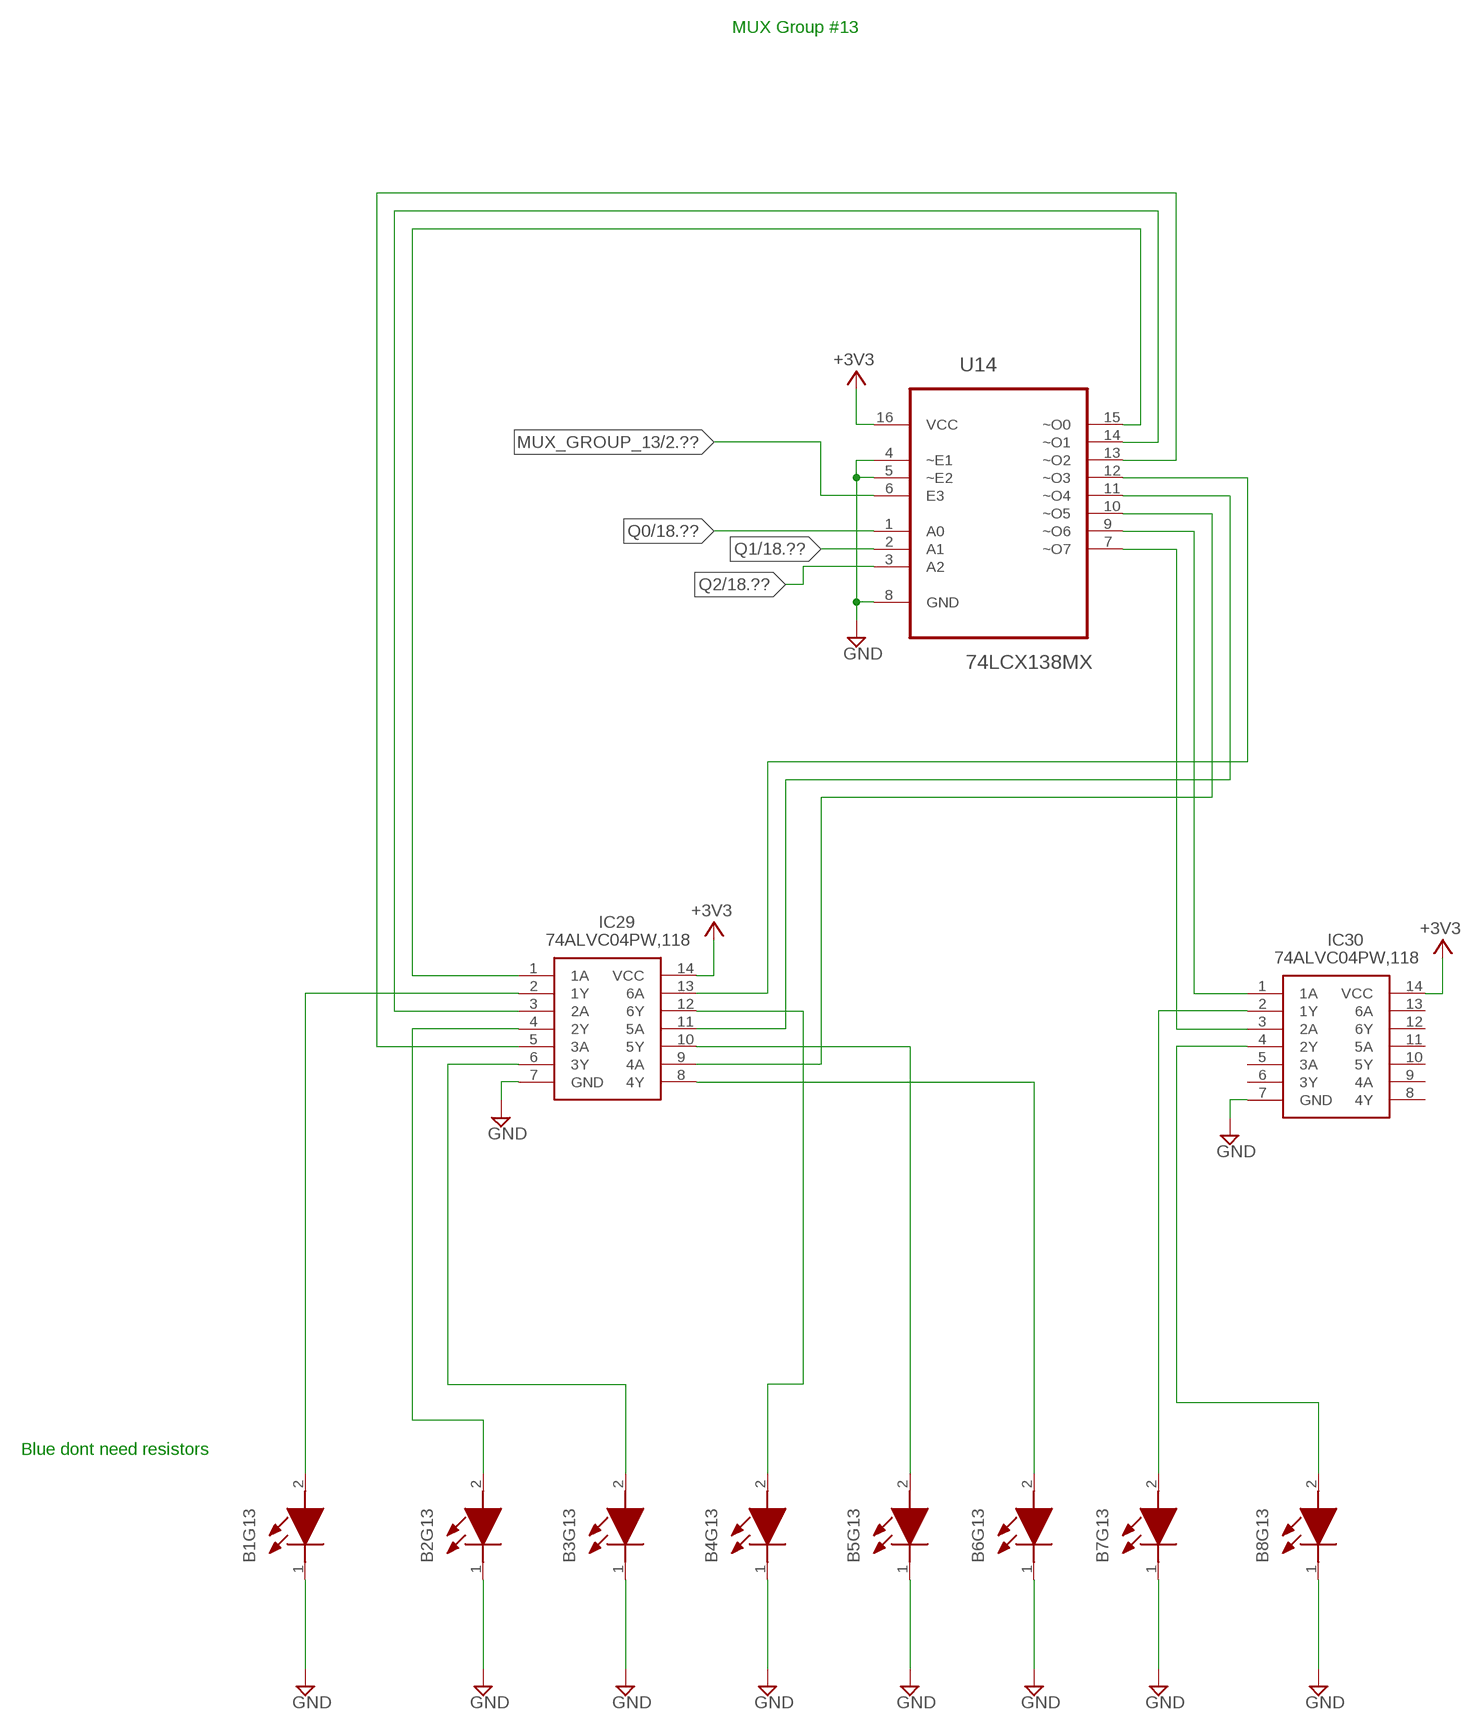
[diagram p16: schematic, sheet 17]

### Parts
B1G13  LTST-C170TBKT  [LEDC2012X120N]
B2G13  LTST-C170TBKT  [LEDC2012X120N]
B3G13  LTST-C170TBKT  [LEDC2012X120N]
B4G13  LTST-C170TBKT  [LEDC2012X120N]
B5G13  LTST-C170TBKT  [LEDC2012X120N]
B6G13  LTST-C170TBKT  [LEDC2012X120N]
B7G13  LTST-C170TBKT  [LEDC2012X120N]
B8G13  LTST-C170TBKT  [LEDC2012X120N]
IC29  74ALVC04PW,118  [SOP65P640X110-14N]
IC30  74ALVC04PW,118  [SOP65P640X110-14N]
U14  74LCX138MX  [SOIC127P600X175-16N]

### Nets
+3V3: IC29.14(VCC) IC30.14(VCC) U14.16(VCC) ; also sheet 1,3,4,5,6,7,8,9,10,11,12,13,14,15,16,18,19,20,21,22
GND [5v_power]: B1G13.1(K) B2G13.1(K) B3G13.1(K) B4G13.1(K) B5G13.1(K) B6G13.1(K) B7G13.1(K) B8G13.1(K) IC29.7(GND) IC30.7(GND) U14.4(~E1) U14.5(~E2) U14.8(GND) ; also sheet 1,2,3,4,5,6,7,8,9,10,11,12,13,14,15,16,18,19,20,21,22
MUX_GROUP_13: U14.6(E3) ; also sheet 2
N$218: IC29.1(1A) U14.15(~O0)
N$219: B1G13.2(A) IC29.2(1Y)
N$220: IC29.3(2A) U14.14(~O1)
N$221: B2G13.2(A) IC29.4(2Y)
N$222: IC29.5(3A) U14.13(~O2)
N$223: B3G13.2(A) IC29.6(3Y)
N$224: IC29.13(6A) U14.12(~O3)
N$225: B4G13.2(A) IC29.12(6Y)
N$226: IC29.11(5A) U14.11(~O4)
N$227: B5G13.2(A) IC29.10(5Y)
N$228: IC29.9(4A) U14.10(~O5)
N$229: B6G13.2(A) IC29.8(4Y)
N$230: IC30.1(1A) U14.9(~O6)
N$231: B7G13.2(A) IC30.2(1Y)
N$232: IC30.3(2A) U14.7(~O7)
N$233: B8G13.2(A) IC30.4(2Y)
Q0: U14.1(A0) ; also sheet 4,5,6,7,8,9,10,11,12,13,14,15,16,18,19,20,21,22
Q1: U14.2(A1) ; also sheet 4,5,6,7,8,9,10,11,12,13,14,15,16,18,19,20,21,22
Q2: U14.3(A2) ; also sheet 4,5,6,7,8,9,10,11,12,13,14,15,16,18,19,20,21,22
Unconnected: IC30.5(3A) IC30.6(3Y) IC30.8(4Y) IC30.9(4A) IC30.10(5Y) IC30.11(5A) IC30.12(6Y) IC30.13(6A)

### Notes on the sheet
- MUX Group #13
- Blue dont need resistors

## Sheet 18 of 22: MUX Group #14
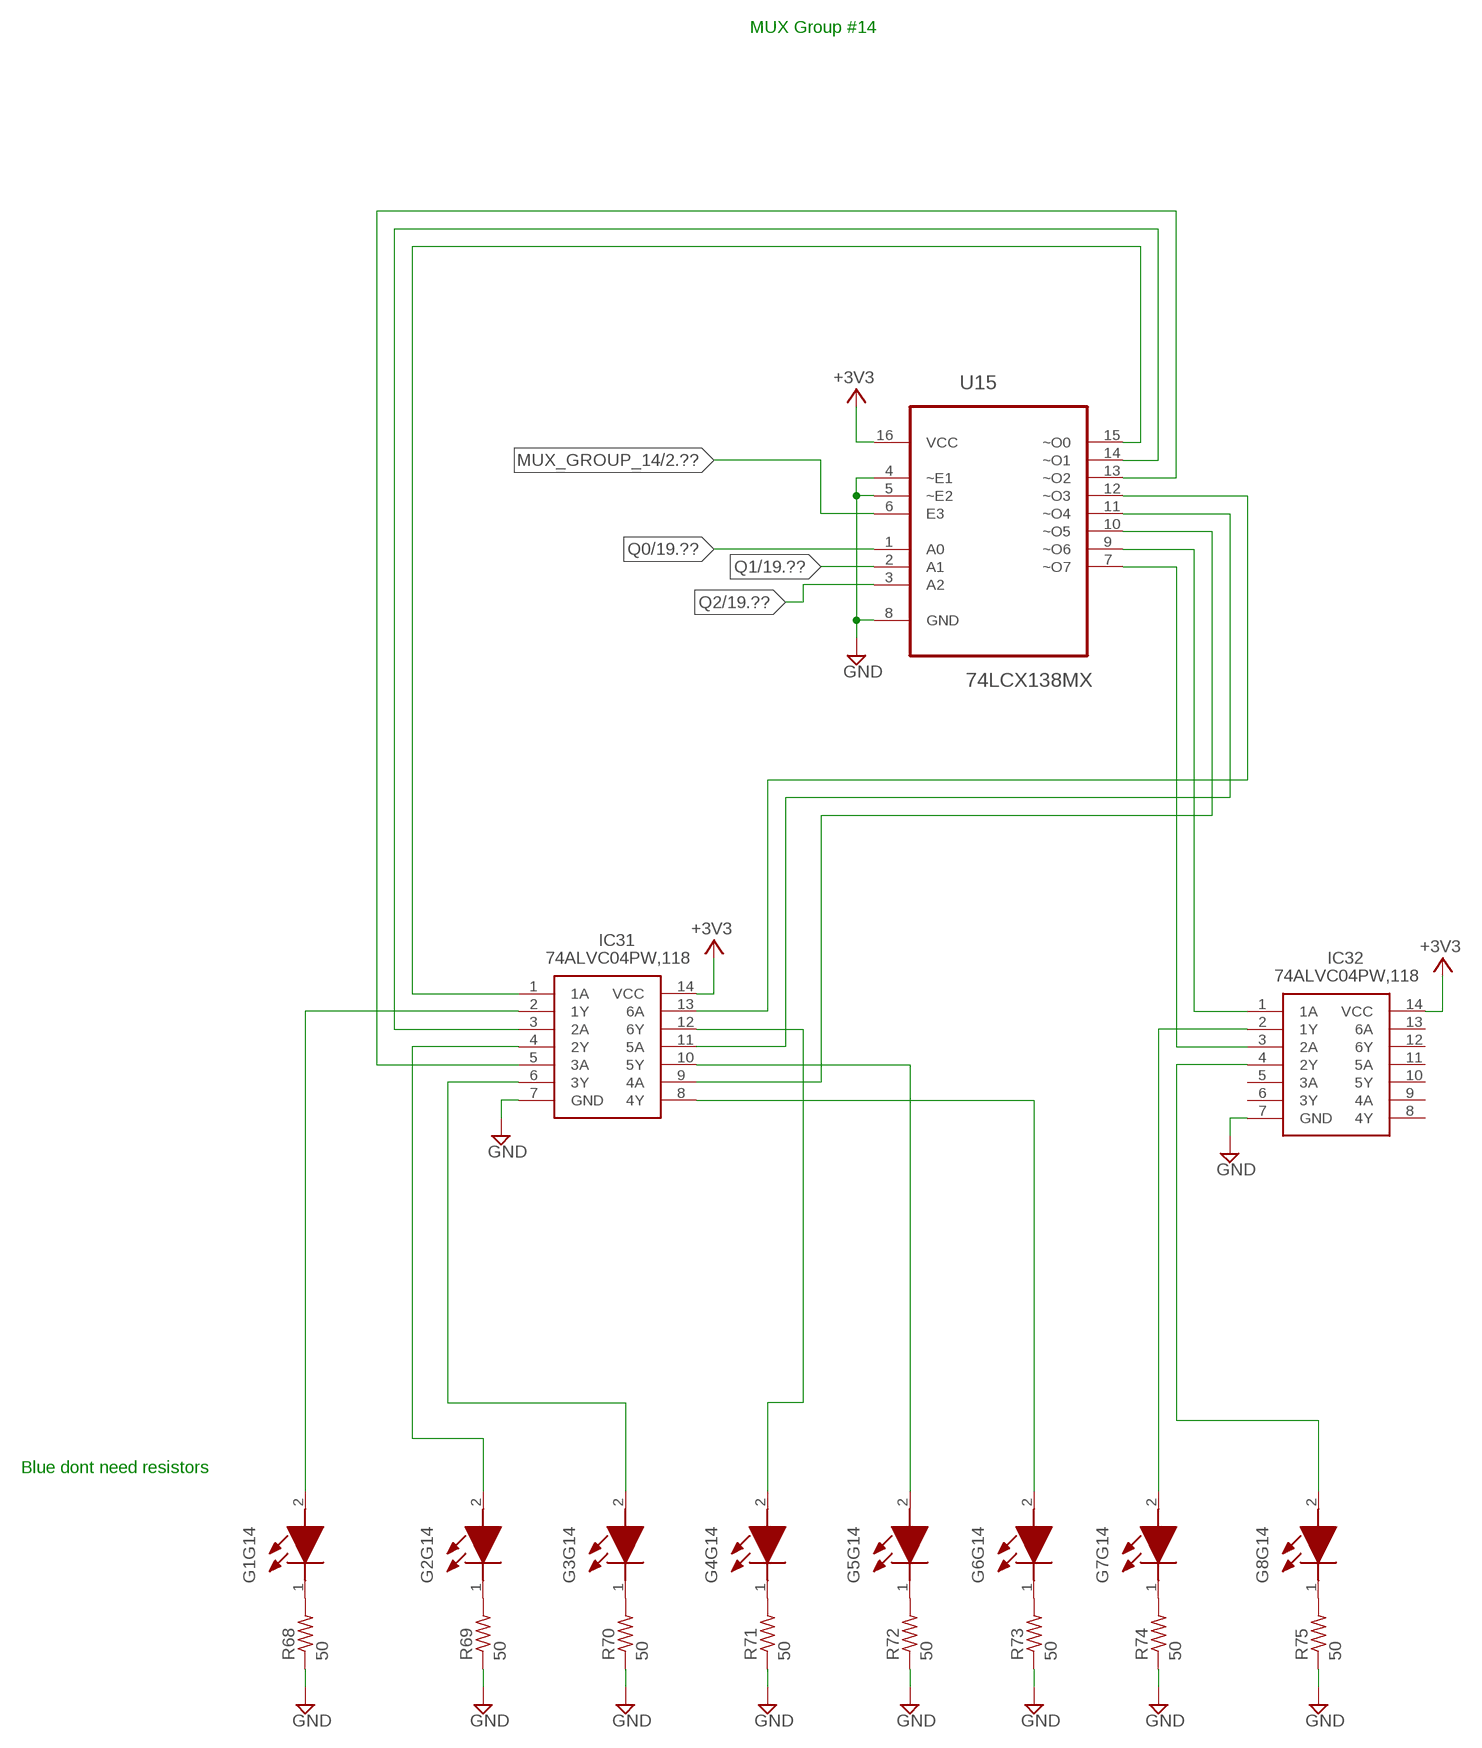
[diagram p17: schematic, sheet 18]

### Parts
G1G14  LTST-C170TBKT  [LEDC2012X120N]
G2G14  LTST-C170TBKT  [LEDC2012X120N]
G3G14  LTST-C170TBKT  [LEDC2012X120N]
G4G14  LTST-C170TBKT  [LEDC2012X120N]
G5G14  LTST-C170TBKT  [LEDC2012X120N]
G6G14  LTST-C170TBKT  [LEDC2012X120N]
G7G14  LTST-C170TBKT  [LEDC2012X120N]
G8G14  LTST-C170TBKT  [LEDC2012X120N]
IC31  74ALVC04PW,118  [SOP65P640X110-14N]
IC32  74ALVC04PW,118  [SOP65P640X110-14N]
R68  50  R-US_R0805  [R0805]
R69  50  R-US_R0805  [R0805]
R70  50  R-US_R0805  [R0805]
R71  50  R-US_R0805  [R0805]
R72  50  R-US_R0805  [R0805]
R73  50  R-US_R0805  [R0805]
R74  50  R-US_R0805  [R0805]
R75  50  R-US_R0805  [R0805]
U15  74LCX138MX  [SOIC127P600X175-16N]

### Nets
+3V3: IC31.14(VCC) IC32.14(VCC) U15.16(VCC) ; also sheet 1,3,4,5,6,7,8,9,10,11,12,13,14,15,16,17,19,20,21,22
GND [5v_power]: IC31.7(GND) IC32.7(GND) R68.1 R69.1 R70.1 R71.1 R72.1 R73.1 R74.1 R75.1 U15.4(~E1) U15.5(~E2) U15.8(GND) ; also sheet 1,2,3,4,5,6,7,8,9,10,11,12,13,14,15,16,17,19,20,21,22
MUX_GROUP_14: U15.6(E3) ; also sheet 2
N$235: IC31.1(1A) U15.15(~O0)
N$236: G1G14.2(A) IC31.2(1Y)
N$237: IC31.3(2A) U15.14(~O1)
N$238: G2G14.2(A) IC31.4(2Y)
N$239: IC31.5(3A) U15.13(~O2)
N$240: G3G14.2(A) IC31.6(3Y)
N$241: IC31.13(6A) U15.12(~O3)
N$242: G4G14.2(A) IC31.12(6Y)
N$243: IC31.11(5A) U15.11(~O4)
N$244: G5G14.2(A) IC31.10(5Y)
N$245: IC31.9(4A) U15.10(~O5)
N$246: G6G14.2(A) IC31.8(4Y)
N$247: IC32.1(1A) U15.9(~O6)
N$248: G7G14.2(A) IC32.2(1Y)
N$249: IC32.3(2A) U15.7(~O7)
N$250: G8G14.2(A) IC32.4(2Y)
N$377: G1G14.1(K) R68.2
N$378: G2G14.1(K) R69.2
N$379: G3G14.1(K) R70.2
N$380: G4G14.1(K) R71.2
N$381: G5G14.1(K) R72.2
N$382: G6G14.1(K) R73.2
N$383: G7G14.1(K) R74.2
N$384: G8G14.1(K) R75.2
Q0: U15.1(A0) ; also sheet 4,5,6,7,8,9,10,11,12,13,14,15,16,17,19,20,21,22
Q1: U15.2(A1) ; also sheet 4,5,6,7,8,9,10,11,12,13,14,15,16,17,19,20,21,22
Q2: U15.3(A2) ; also sheet 4,5,6,7,8,9,10,11,12,13,14,15,16,17,19,20,21,22
Unconnected: IC32.5(3A) IC32.6(3Y) IC32.8(4Y) IC32.9(4A) IC32.10(5Y) IC32.11(5A) IC32.12(6Y) IC32.13(6A)

### Notes on the sheet
- MUX Group #14
- Blue dont need resistors

## Sheet 19 of 22: MUX Group #15
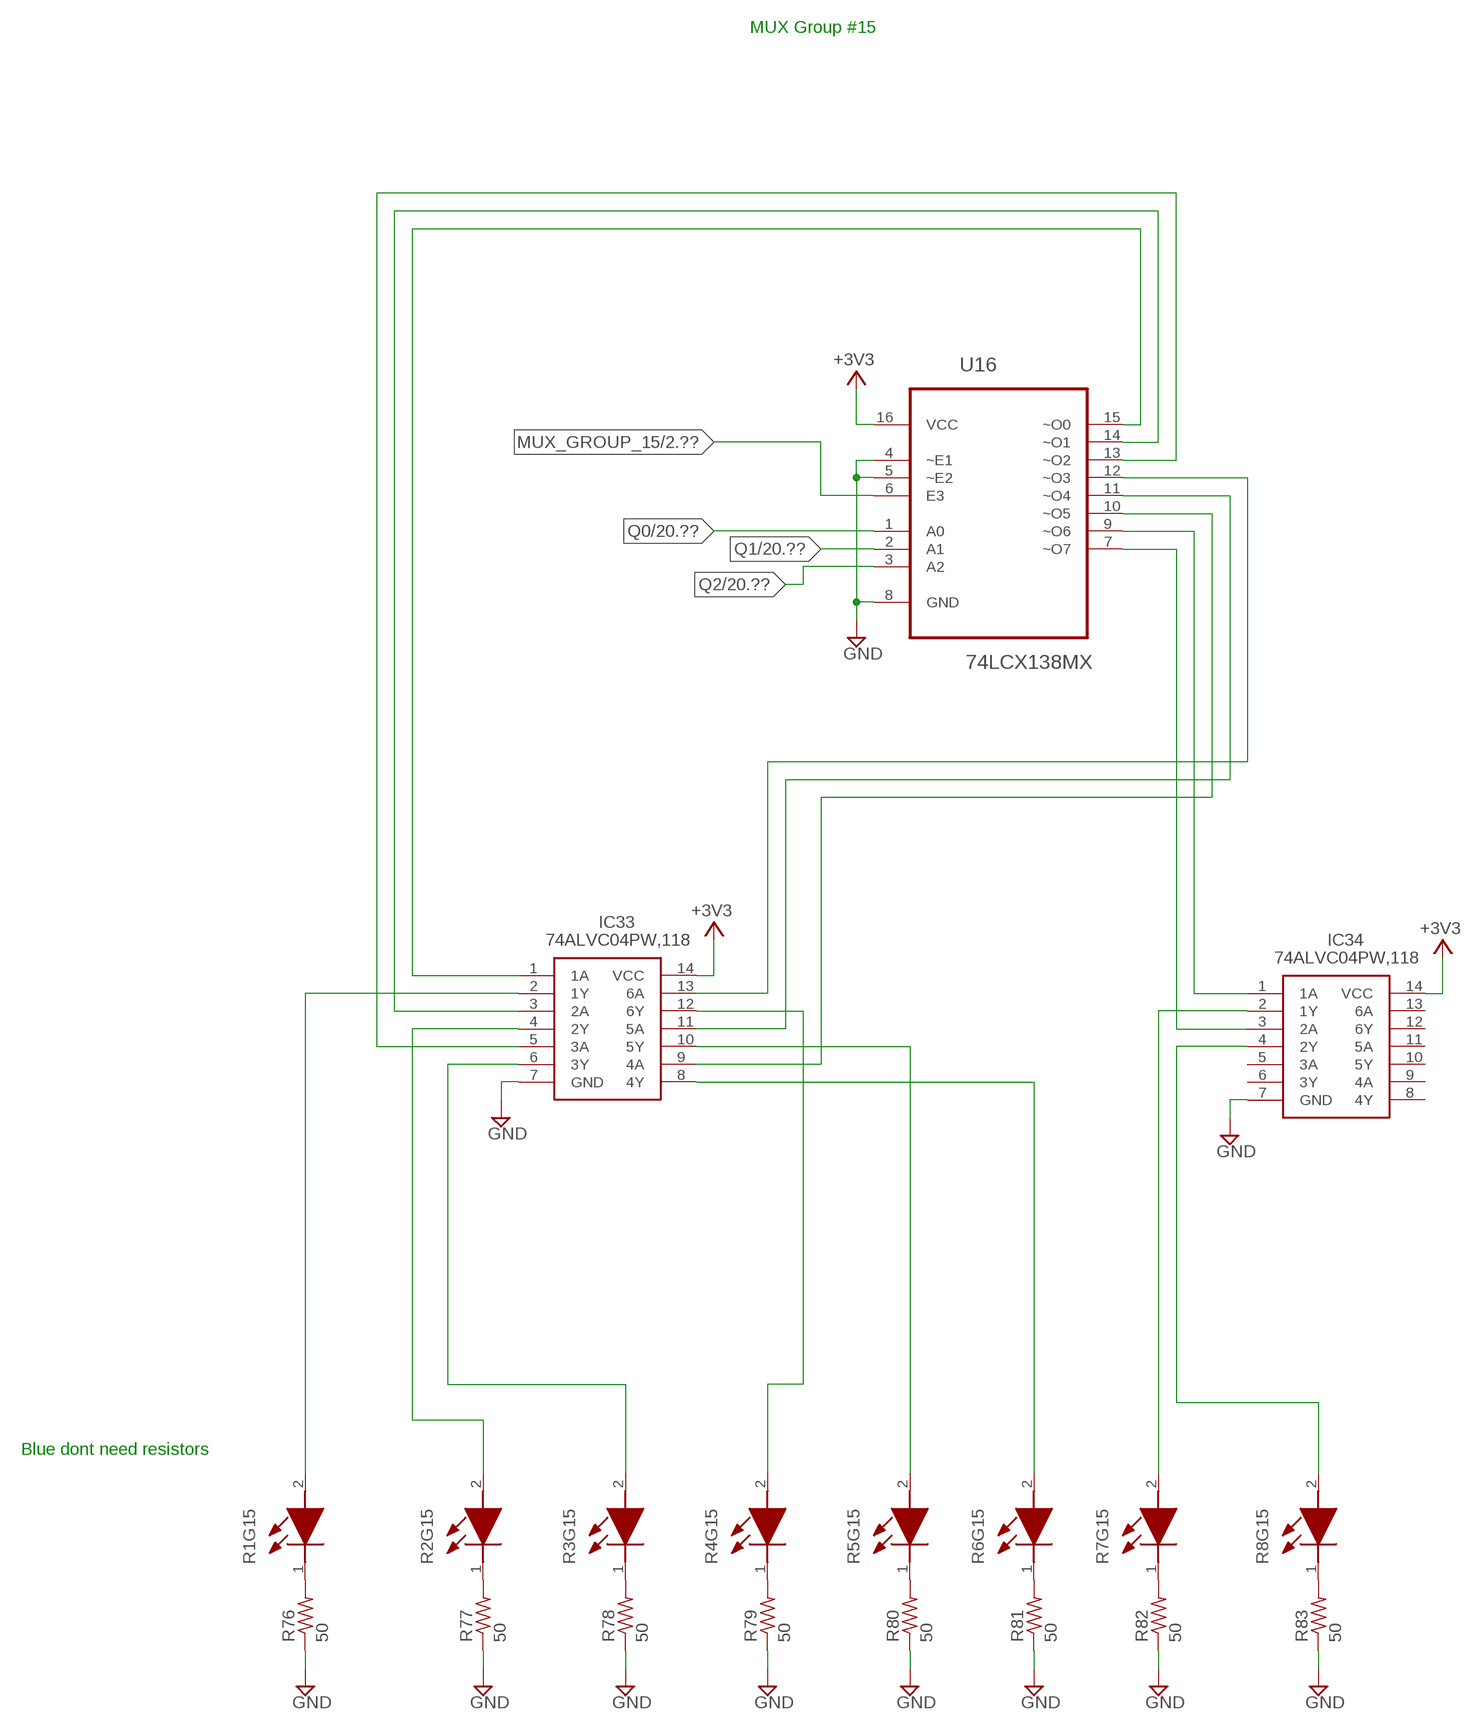
[diagram p18: schematic, sheet 19]

### Parts
IC33  74ALVC04PW,118  [SOP65P640X110-14N]
IC34  74ALVC04PW,118  [SOP65P640X110-14N]
R1G15  LTST-C170TBKT  [LEDC2012X120N]
R2G15  LTST-C170TBKT  [LEDC2012X120N]
R3G15  LTST-C170TBKT  [LEDC2012X120N]
R4G15  LTST-C170TBKT  [LEDC2012X120N]
R5G15  LTST-C170TBKT  [LEDC2012X120N]
R6G15  LTST-C170TBKT  [LEDC2012X120N]
R7G15  LTST-C170TBKT  [LEDC2012X120N]
R8G15  LTST-C170TBKT  [LEDC2012X120N]
R76  50  R-US_R0805  [R0805]
R77  50  R-US_R0805  [R0805]
R78  50  R-US_R0805  [R0805]
R79  50  R-US_R0805  [R0805]
R80  50  R-US_R0805  [R0805]
R81  50  R-US_R0805  [R0805]
R82  50  R-US_R0805  [R0805]
R83  50  R-US_R0805  [R0805]
U16  74LCX138MX  [SOIC127P600X175-16N]

### Nets
+3V3: IC33.14(VCC) IC34.14(VCC) U16.16(VCC) ; also sheet 1,3,4,5,6,7,8,9,10,11,12,13,14,15,16,17,18,20,21,22
GND [5v_power]: IC33.7(GND) IC34.7(GND) R76.1 R77.1 R78.1 R79.1 R80.1 R81.1 R82.1 R83.1 U16.4(~E1) U16.5(~E2) U16.8(GND) ; also sheet 1,2,3,4,5,6,7,8,9,10,11,12,13,14,15,16,17,18,20,21,22
MUX_GROUP_15: U16.6(E3) ; also sheet 2
N$252: IC33.1(1A) U16.15(~O0)
N$253: IC33.2(1Y) R1G15.2(A)
N$254: IC33.3(2A) U16.14(~O1)
N$255: IC33.4(2Y) R2G15.2(A)
N$256: IC33.5(3A) U16.13(~O2)
N$257: IC33.6(3Y) R3G15.2(A)
N$258: IC33.13(6A) U16.12(~O3)
N$259: IC33.12(6Y) R4G15.2(A)
N$260: IC33.11(5A) U16.11(~O4)
N$261: IC33.10(5Y) R5G15.2(A)
N$262: IC33.9(4A) U16.10(~O5)
N$263: IC33.8(4Y) R6G15.2(A)
N$264: IC34.1(1A) U16.9(~O6)
N$265: IC34.2(1Y) R7G15.2(A)
N$266: IC34.3(2A) U16.7(~O7)
N$267: IC34.4(2Y) R8G15.2(A)
N$385: R1G15.1(K) R76.2
N$386: R2G15.1(K) R77.2
N$387: R3G15.1(K) R78.2
N$388: R4G15.1(K) R79.2
N$389: R5G15.1(K) R80.2
N$390: R6G15.1(K) R81.2
N$391: R7G15.1(K) R82.2
N$392: R8G15.1(K) R83.2
Q0: U16.1(A0) ; also sheet 4,5,6,7,8,9,10,11,12,13,14,15,16,17,18,20,21,22
Q1: U16.2(A1) ; also sheet 4,5,6,7,8,9,10,11,12,13,14,15,16,17,18,20,21,22
Q2: U16.3(A2) ; also sheet 4,5,6,7,8,9,10,11,12,13,14,15,16,17,18,20,21,22
Unconnected: IC34.5(3A) IC34.6(3Y) IC34.8(4Y) IC34.9(4A) IC34.10(5Y) IC34.11(5A) IC34.12(6Y) IC34.13(6A)

### Notes on the sheet
- MUX Group #15
- Blue dont need resistors

## Sheet 20 of 22: MUX Group #16
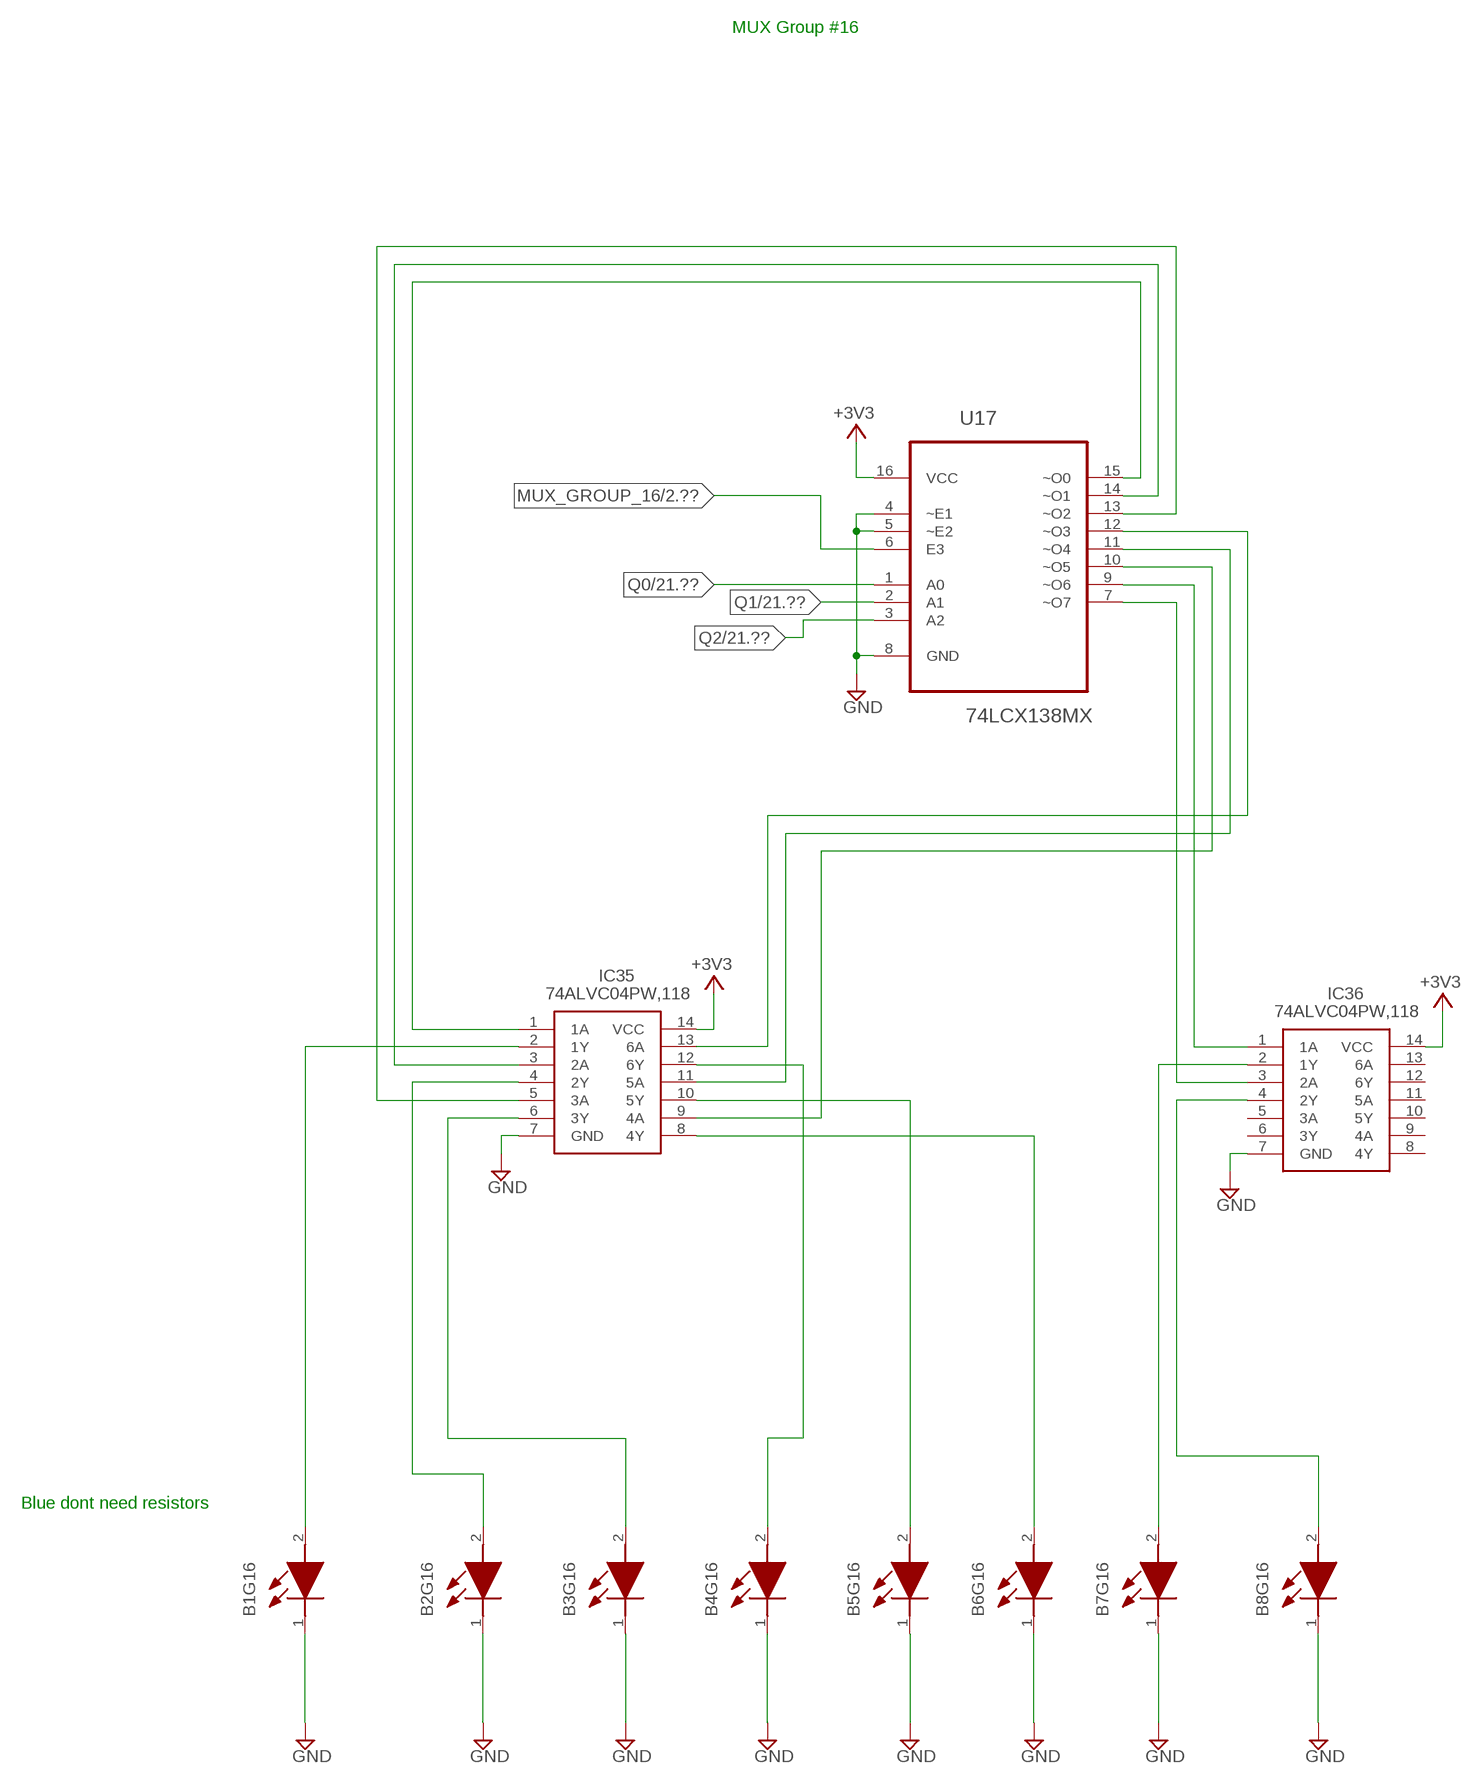
[diagram p19: schematic, sheet 20]

### Parts
B1G16  LTST-C170TBKT  [LEDC2012X120N]
B2G16  LTST-C170TBKT  [LEDC2012X120N]
B3G16  LTST-C170TBKT  [LEDC2012X120N]
B4G16  LTST-C170TBKT  [LEDC2012X120N]
B5G16  LTST-C170TBKT  [LEDC2012X120N]
B6G16  LTST-C170TBKT  [LEDC2012X120N]
B7G16  LTST-C170TBKT  [LEDC2012X120N]
B8G16  LTST-C170TBKT  [LEDC2012X120N]
IC35  74ALVC04PW,118  [SOP65P640X110-14N]
IC36  74ALVC04PW,118  [SOP65P640X110-14N]
U17  74LCX138MX  [SOIC127P600X175-16N]

### Nets
+3V3: IC35.14(VCC) IC36.14(VCC) U17.16(VCC) ; also sheet 1,3,4,5,6,7,8,9,10,11,12,13,14,15,16,17,18,19,21,22
GND [5v_power]: B1G16.1(K) B2G16.1(K) B3G16.1(K) B4G16.1(K) B5G16.1(K) B6G16.1(K) B7G16.1(K) B8G16.1(K) IC35.7(GND) IC36.7(GND) U17.4(~E1) U17.5(~E2) U17.8(GND) ; also sheet 1,2,3,4,5,6,7,8,9,10,11,12,13,14,15,16,17,18,19,21,22
MUX_GROUP_16: U17.6(E3) ; also sheet 2
N$269: IC35.1(1A) U17.15(~O0)
N$270: B1G16.2(A) IC35.2(1Y)
N$271: IC35.3(2A) U17.14(~O1)
N$272: B2G16.2(A) IC35.4(2Y)
N$273: IC35.5(3A) U17.13(~O2)
N$274: B3G16.2(A) IC35.6(3Y)
N$275: IC35.13(6A) U17.12(~O3)
N$276: B4G16.2(A) IC35.12(6Y)
N$277: IC35.11(5A) U17.11(~O4)
N$278: B5G16.2(A) IC35.10(5Y)
N$279: IC35.9(4A) U17.10(~O5)
N$280: B6G16.2(A) IC35.8(4Y)
N$281: IC36.1(1A) U17.9(~O6)
N$282: B7G16.2(A) IC36.2(1Y)
N$283: IC36.3(2A) U17.7(~O7)
N$284: B8G16.2(A) IC36.4(2Y)
Q0: U17.1(A0) ; also sheet 4,5,6,7,8,9,10,11,12,13,14,15,16,17,18,19,21,22
Q1: U17.2(A1) ; also sheet 4,5,6,7,8,9,10,11,12,13,14,15,16,17,18,19,21,22
Q2: U17.3(A2) ; also sheet 4,5,6,7,8,9,10,11,12,13,14,15,16,17,18,19,21,22
Unconnected: IC36.5(3A) IC36.6(3Y) IC36.8(4Y) IC36.9(4A) IC36.10(5Y) IC36.11(5A) IC36.12(6Y) IC36.13(6A)

### Notes on the sheet
- MUX Group #16
- Blue dont need resistors

## Sheet 21 of 22: MUX Group #17
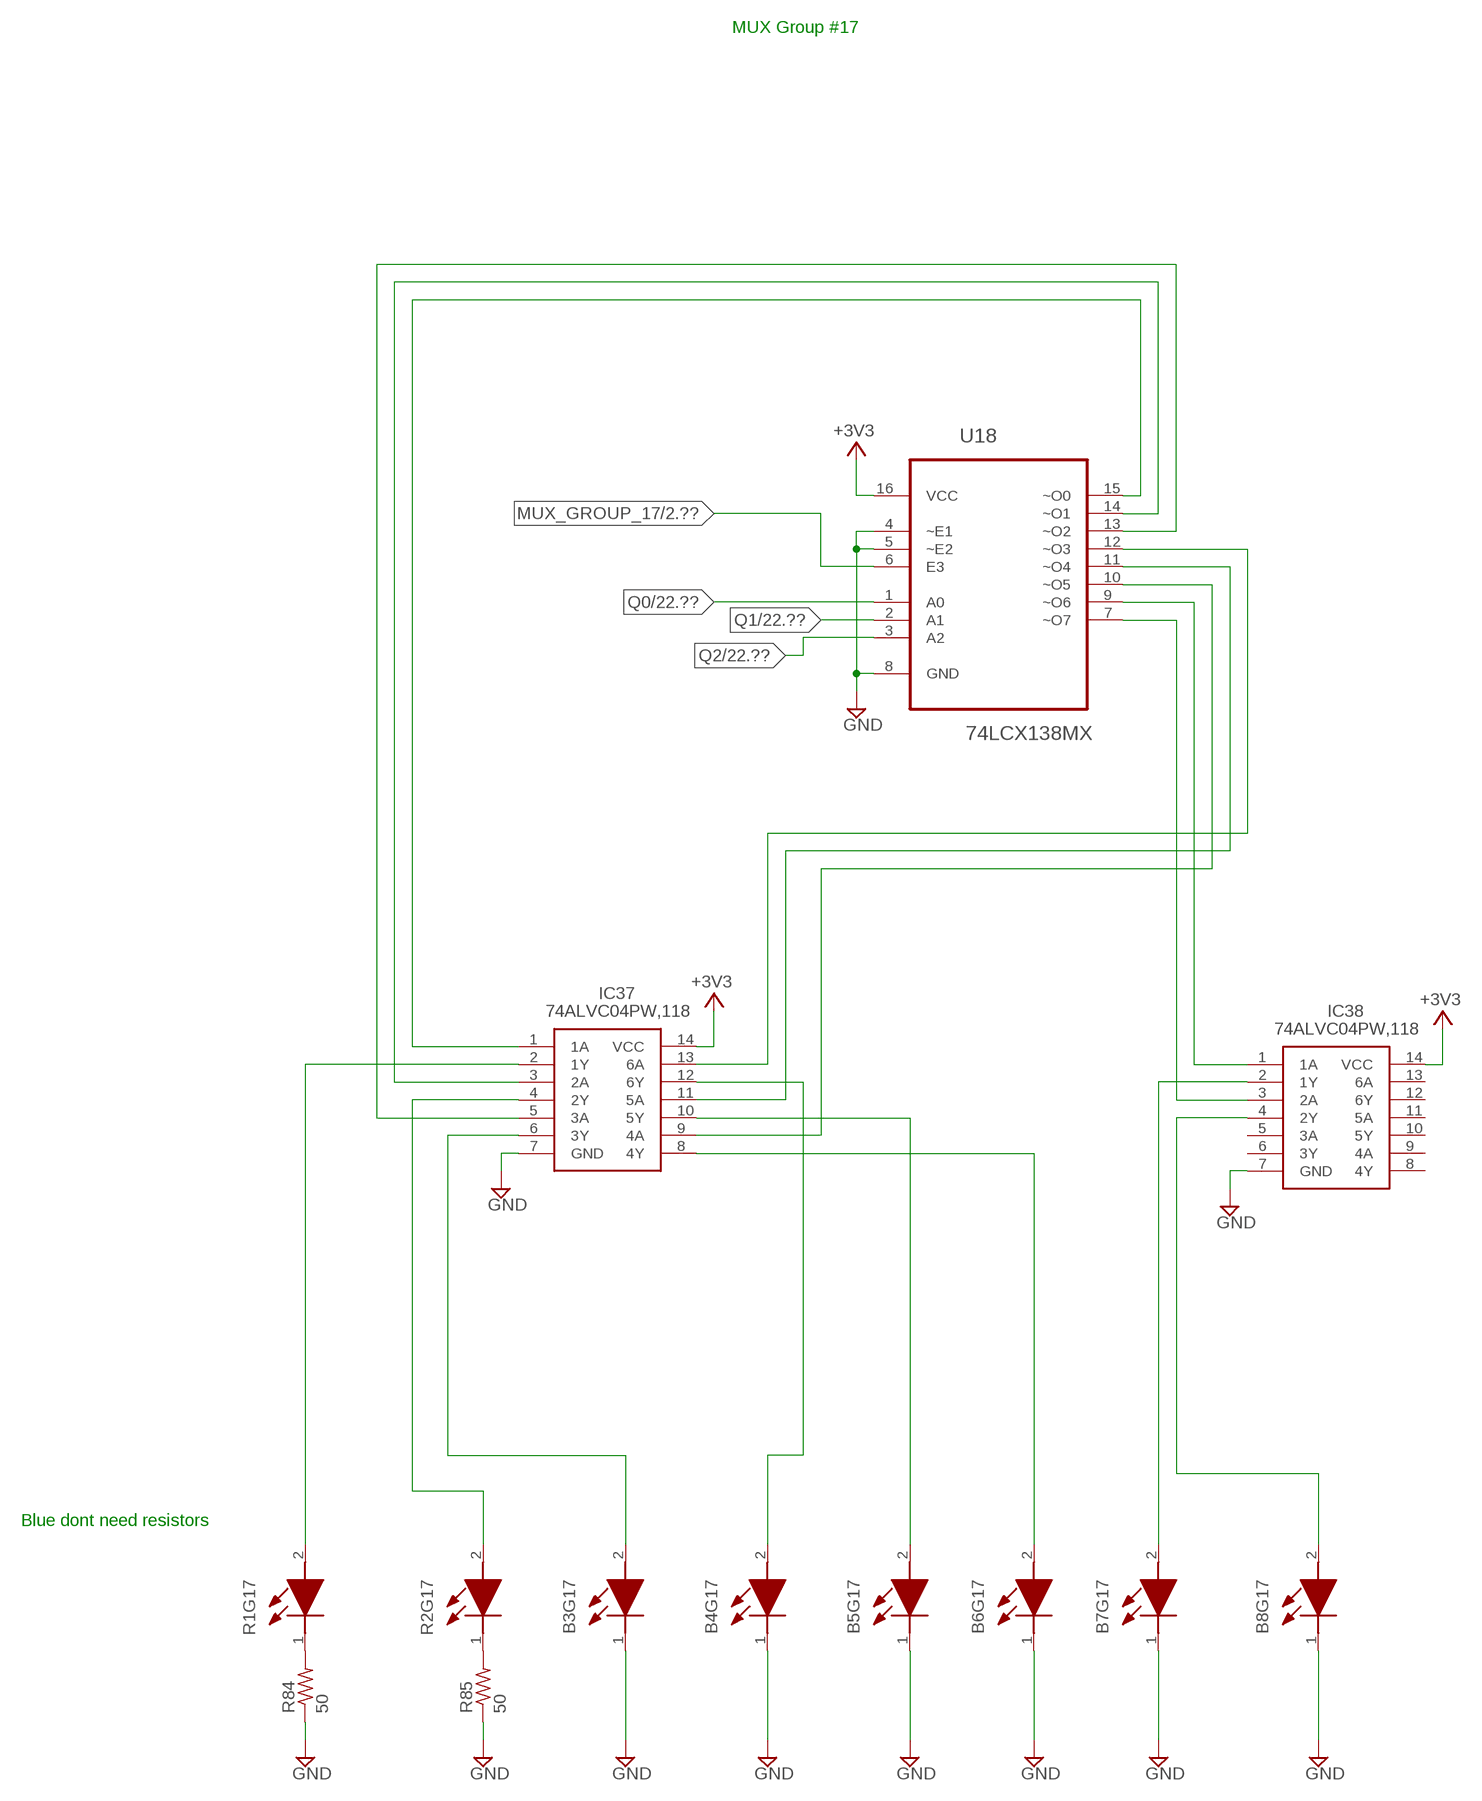
[diagram p20: schematic, sheet 21]

### Parts
B3G17  LTST-C170TBKT  [LEDC2012X120N]
B4G17  LTST-C170TBKT  [LEDC2012X120N]
B5G17  LTST-C170TBKT  [LEDC2012X120N]
B6G17  LTST-C170TBKT  [LEDC2012X120N]
B7G17  LTST-C170TBKT  [LEDC2012X120N]
B8G17  LTST-C170TBKT  [LEDC2012X120N]
IC37  74ALVC04PW,118  [SOP65P640X110-14N]
IC38  74ALVC04PW,118  [SOP65P640X110-14N]
R1G17  LTST-C170TBKT  [LEDC2012X120N]
R2G17  LTST-C170TBKT  [LEDC2012X120N]
R84  50  R-US_R0805  [R0805]
R85  50  R-US_R0805  [R0805]
U18  74LCX138MX  [SOIC127P600X175-16N]

### Nets
+3V3: IC37.14(VCC) IC38.14(VCC) U18.16(VCC) ; also sheet 1,3,4,5,6,7,8,9,10,11,12,13,14,15,16,17,18,19,20,22
GND [5v_power]: B3G17.1(K) B4G17.1(K) B5G17.1(K) B6G17.1(K) B7G17.1(K) B8G17.1(K) IC37.7(GND) IC38.7(GND) R84.1 R85.1 U18.4(~E1) U18.5(~E2) U18.8(GND) ; also sheet 1,2,3,4,5,6,7,8,9,10,11,12,13,14,15,16,17,18,19,20,22
MUX_GROUP_17: U18.6(E3) ; also sheet 2
N$286: IC37.1(1A) U18.15(~O0)
N$287: IC37.2(1Y) R1G17.2(A)
N$288: IC37.3(2A) U18.14(~O1)
N$289: IC37.4(2Y) R2G17.2(A)
N$290: IC37.5(3A) U18.13(~O2)
N$291: B3G17.2(A) IC37.6(3Y)
N$292: IC37.13(6A) U18.12(~O3)
N$293: B4G17.2(A) IC37.12(6Y)
N$294: IC37.11(5A) U18.11(~O4)
N$295: B5G17.2(A) IC37.10(5Y)
N$296: IC37.9(4A) U18.10(~O5)
N$297: B6G17.2(A) IC37.8(4Y)
N$298: IC38.1(1A) U18.9(~O6)
N$299: B7G17.2(A) IC38.2(1Y)
N$300: IC38.3(2A) U18.7(~O7)
N$301: B8G17.2(A) IC38.4(2Y)
N$393: R1G17.1(K) R84.2
N$394: R2G17.1(K) R85.2
Q0: U18.1(A0) ; also sheet 4,5,6,7,8,9,10,11,12,13,14,15,16,17,18,19,20,22
Q1: U18.2(A1) ; also sheet 4,5,6,7,8,9,10,11,12,13,14,15,16,17,18,19,20,22
Q2: U18.3(A2) ; also sheet 4,5,6,7,8,9,10,11,12,13,14,15,16,17,18,19,20,22
Unconnected: IC38.5(3A) IC38.6(3Y) IC38.8(4Y) IC38.9(4A) IC38.10(5Y) IC38.11(5A) IC38.12(6Y) IC38.13(6A)

### Notes on the sheet
- MUX Group #17
- Blue dont need resistors

## Sheet 22 of 22: MUX Group #18
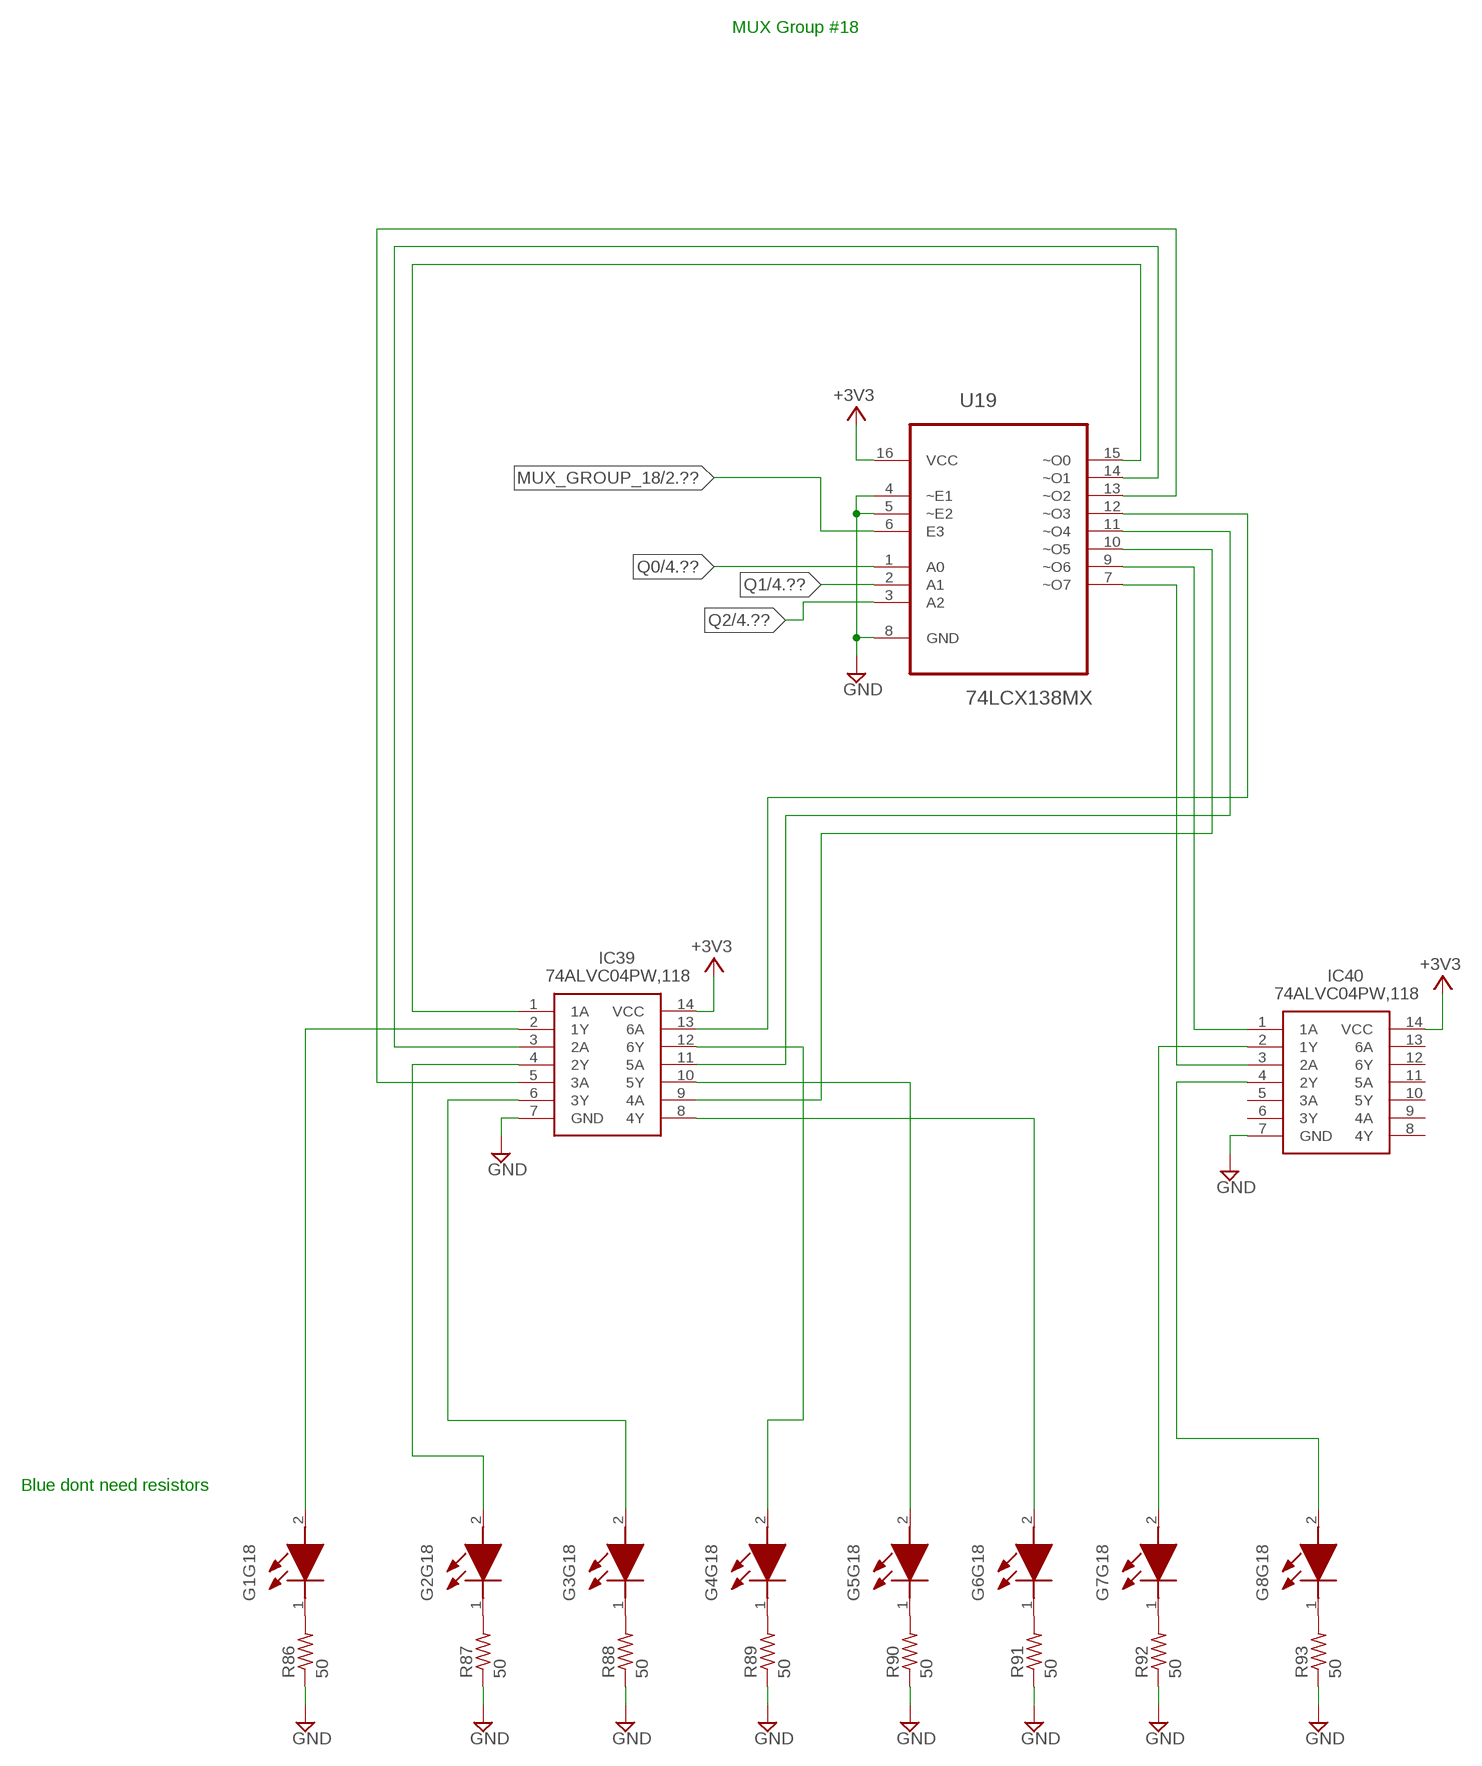
[diagram p21: schematic, sheet 22]

### Parts
G1G18  LTST-C170TBKT  [LEDC2012X120N]
G2G18  LTST-C170TBKT  [LEDC2012X120N]
G3G18  LTST-C170TBKT  [LEDC2012X120N]
G4G18  LTST-C170TBKT  [LEDC2012X120N]
G5G18  LTST-C170TBKT  [LEDC2012X120N]
G6G18  LTST-C170TBKT  [LEDC2012X120N]
G7G18  LTST-C170TBKT  [LEDC2012X120N]
G8G18  LTST-C170TBKT  [LEDC2012X120N]
IC39  74ALVC04PW,118  [SOP65P640X110-14N]
IC40  74ALVC04PW,118  [SOP65P640X110-14N]
R86  50  R-US_R0805  [R0805]
R87  50  R-US_R0805  [R0805]
R88  50  R-US_R0805  [R0805]
R89  50  R-US_R0805  [R0805]
R90  50  R-US_R0805  [R0805]
R91  50  R-US_R0805  [R0805]
R92  50  R-US_R0805  [R0805]
R93  50  R-US_R0805  [R0805]
U19  74LCX138MX  [SOIC127P600X175-16N]

### Nets
+3V3: IC39.14(VCC) IC40.14(VCC) U19.16(VCC) ; also sheet 1,3,4,5,6,7,8,9,10,11,12,13,14,15,16,17,18,19,20,21
GND [5v_power]: IC39.7(GND) IC40.7(GND) R86.1 R87.1 R88.1 R89.1 R90.1 R91.1 R92.1 R93.1 U19.4(~E1) U19.5(~E2) U19.8(GND) ; also sheet 1,2,3,4,5,6,7,8,9,10,11,12,13,14,15,16,17,18,19,20,21
MUX_GROUP_18: U19.6(E3) ; also sheet 2
N$303: IC39.1(1A) U19.15(~O0)
N$304: G1G18.2(A) IC39.2(1Y)
N$305: IC39.3(2A) U19.14(~O1)
N$306: G2G18.2(A) IC39.4(2Y)
N$307: IC39.5(3A) U19.13(~O2)
N$308: G3G18.2(A) IC39.6(3Y)
N$309: IC39.13(6A) U19.12(~O3)
N$310: G4G18.2(A) IC39.12(6Y)
N$311: IC39.11(5A) U19.11(~O4)
N$312: G5G18.2(A) IC39.10(5Y)
N$313: IC39.9(4A) U19.10(~O5)
N$314: G6G18.2(A) IC39.8(4Y)
N$315: IC40.1(1A) U19.9(~O6)
N$316: G7G18.2(A) IC40.2(1Y)
N$317: IC40.3(2A) U19.7(~O7)
N$318: G8G18.2(A) IC40.4(2Y)
N$395: G1G18.1(K) R86.2
N$396: G2G18.1(K) R87.2
N$397: G3G18.1(K) R88.2
N$398: G4G18.1(K) R89.2
N$399: G5G18.1(K) R90.2
N$400: G6G18.1(K) R91.2
N$401: G7G18.1(K) R92.2
N$402: G8G18.1(K) R93.2
Q0: U19.1(A0) ; also sheet 4,5,6,7,8,9,10,11,12,13,14,15,16,17,18,19,20,21
Q1: U19.2(A1) ; also sheet 4,5,6,7,8,9,10,11,12,13,14,15,16,17,18,19,20,21
Q2: U19.3(A2) ; also sheet 4,5,6,7,8,9,10,11,12,13,14,15,16,17,18,19,20,21
Unconnected: IC40.5(3A) IC40.6(3Y) IC40.8(4Y) IC40.9(4A) IC40.10(5Y) IC40.11(5A) IC40.12(6Y) IC40.13(6A)

### Notes on the sheet
- MUX Group #18
- Blue dont need resistors

## Power pins joined to a net without a drawn wire
3V3: U1.1(3V3)

## Library data of the parts
555_TIMER_CLOCK_GEN1 = SamacSys_Parts:LM555CM_NOPB: Highly stable 555 timer for generating accurate time delays and oscillation Source: Datasheet <http://www.ti.com/lit/ds/symlink/lm555.pdf>; DESCRIPTION: Highly stable 555 timer for generating accurate time delays and oscillation; HEIGHT: 1.75mm; MANUFACTURER_NAME: Texas Instruments; MANUFACTURER_PART_NUMBER: LM555CM/NOPB; MOUSER_PART_NUMBER: 926-LM555CM/NOPB; MOUSER_PRICE-STOCK: https://www.mouser.co.uk/ProductDetail/Texas-Instruments/LM555CM-NOPB?qs=QbsRYf82W3Hc3mLUToU1xw%3D%3D
B1G1 B1G2 B1G4 B1G5 B1G13 B1G16 B2G1 B2G2 B2G4 B2G5 B2G13 B2G16 B3G1 B3G2 B3G4 B3G5 B3G13 B3G16 B3G17 B4G1 B4G2 B4G4 B4G5 B4G13 B4G16 B4G17 B5G1 B5G2 B5G4 B5G13 B5G16 B5G17 B6G1 B6G2 B6G4 B6G13 B6G16 B6G17 B7G1 B7G2 B7G4 B7G13 B7G16 B7G17 B8G1 B8G4 B8G13 B8G16 B8G17 G1G7 G1G8 G1G14 G1G18 G2G7 G2G8 G2G14 G2G18 G3G7 G3G8 G3G14 G3G18 G4G7 G4G8 G4G14 G4G18 G5G8 G5G14 G5G18 G6G5 G6G14 G6G18 G7G5 G7G7 G7G8 G7G14 G7G18 G8G5 G8G14 G8G18 O1G9 O1G11 O2G9 O2G11 O3G9 O3G11 O4G9 O4G11 O5G9 O5G11 O6G7 O6G9 O6G11 O7G9 O7G11 O8G9 O8G11 R1G3 R1G6 R1G15 R1G17 R2G3 R2G6 R2G15 R2G17 R3G3 R3G6 R3G15 R4G3 R4G6 R4G15 R5G3 R5G5 R5G6 R5G15 R6G3 R6G6 R6G15 R7G3 R7G6 R7G15 R8G3 R8G6 R8G15 Y1G10 Y1G12 Y2G10 Y2G12 Y3G10 Y3G12 Y4G10 Y4G12 Y5G7 Y5G10 Y5G12 Y6G8 Y6G12 Y7G12 Y8G7 Y8G8 Y8G12 = SamacSys_Parts:LTST-C170TBKT: LED,SMD,0805,Blue,28mcd,130deg Source: Datasheet <https://componentsearchengine.com/Datasheets/1/LTST-C170TBKT.pdf>; DESCRIPTION: LED,SMD,0805,Blue,28mcd,130deg; HEIGHT: 1.2mm; MANUFACTURER_NAME: Lite-On; MANUFACTURER_PART_NUMBER: LTST-C170TBKT; MOUSER_PART_NUMBER: 859-LTST-C170TBKT; MOUSER_PRICE-STOCK: https://www.mouser.co.uk/ProductDetail/Lite-On/LTST-C170TBKT?qs=0uL0gcxEMop2ooGmIUzw3A%3D%3D
BARREL_JACK1 = adafruit:2.1MMJACK: 2.1mm x 5.5mm THM DC jack with internal switch. Digikey part #PJ-102A, 4UCON part #05537 2.1mm x 5.5mm SMT DC jack with internal switch. Digikey part #PJ-002A-SMT, 4UCON part #03267 By microbuilder.eu & adafruit.com
C1 C2 C6-C8 = rcl:C-US: CAPACITOR, American symbol; SPICEPREFIX: C
IC1 = SamacSys_Parts:74HC390PW,118: 74HC(T)390 - Dual decade ripple counter@en-us Source: Datasheet <https://assets.nexperia.com/documents/data-sheet/74HC_HCT390.pdf>; DESCRIPTION: 74HC(T)390 - Dual decade ripple counter@en-us; HEIGHT: 1.1mm; MANUFACTURER_NAME: Nexperia; MANUFACTURER_PART_NUMBER: 74HC390PW,118; MOUSER_PART_NUMBER: 771-HC390PW118; MOUSER_PRICE-STOCK: https://www.mouser.co.uk/ProductDetail/Nexperia/74HC390PW118?qs=P62ublwmbi98uINa2vOWkQ%3D%3D
IC2 IC5-IC23 IC25-IC40 = SamacSys_Parts:74ALVC04PW,118: 74ALVC04 - Hex inverter@en-us Source: Datasheet <https://componentsearchengine.com/Datasheets/1/74ALVC04PW,118.pdf>; DESCRIPTION: 74ALVC04 - Hex inverter@en-us; HEIGHT: 1.1mm; MANUFACTURER_NAME: Nexperia; MANUFACTURER_PART_NUMBER: 74ALVC04PW,118; MOUSER_PART_NUMBER: 771-ALVC04PW118
IC3 IC4 = SamacSys_Parts:74ALVC08BQ,115: 74ALVC08 - Quad 2-input AND gate@en-us Source: Datasheet <https://componentsearchengine.com/Datasheets/1/74ALVC08BQ,115.pdf>; DESCRIPTION: 74ALVC08 - Quad 2-input AND gate@en-us; HEIGHT: 1mm; MANUFACTURER_NAME: Nexperia; MANUFACTURER_PART_NUMBER: 74ALVC08BQ,115; MOUSER_PART_NUMBER: 771-ALVC08BQ115; MOUSER_PRICE-STOCK: https://www.mouser.com/Search/Refine.aspx?Keyword=771-ALVC08BQ115
JP1 JP3 = pinhead:PINHD-1X2: PIN HEADER
R1-R50 R52-R94 RA1 RB1 = adafruit:R-US_: RESISTOR, American symbol
U1 = ESP32-DEVKITC-32D:ESP32-DEVKITC-32D: Eval Board For Esp-Wroom-32 Check prices <https://pricing.snapeda.com/parts/ESP32-DEVKITC-32D/Espressif%20Systems/view-part?ref=eda>; AVAILABILITY: In Stock; DESCRIPTION: WiFi Development Tools (802.11) ESP32 General Development Kit, ESP32-WROOM-32D on the board; MF: Espressif Systems; MP: ESP32-DEVKITC-32D; PACKAGE: None; PRICE: None; PURCHASE-URL: https://pricing.snapeda.com/search/part/ESP32-DEVKITC-32D/?ref=eda
U2-U19 = 74LCX138MX:74LCX138MX: Low Voltage 1-of-8 Decoder/Demultiplexer; DESCRIPTION: Decoder/Demultiplexer 1 x 3:8 16-SOIC; DIGI-KEY_PART_NUMBER: 74LCX138MXCT-ND; MF: ON; MP: 74LCX138MX; PACKAGE: SOIC-16 ON Semiconductor; PURCHASE-URL: https://pricing.snapeda.com/search/part/74LCX138MX/?ref=eda
VOLTAGE_REG = SamacSys_Parts:TLS850B0TBV33ATMA1: INFINEON - TLS850B0TBV33ATMA1 - LDO, AEC-Q100, FIXED, 3.3V, 0.5A, TO-263 Source: Datasheet <https://www.infineon.com/dgdl/Infineon-TLS850B0TB V33-DS-v01_00-EN.pdf?fileId=5546d4625fe3678401600cf0f9cb6d40>; DESCRIPTION: INFINEON - TLS850B0TBV33ATMA1 - LDO, AEC-Q100, FIXED, 3.3V, 0.5A, TO-263; HEIGHT: 4.4mm; MANUFACTURER_NAME: Infineon; MANUFACTURER_PART_NUMBER: TLS850B0TBV33ATMA1; MOUSER_PART_NUMBER: 726-TLS850B0TBV33ATM; MOUSER_PRICE-STOCK: https://www.mouser.co.uk/ProductDetail/Infineon-Technologies/TLS850B0TBV33ATMA1?qs=W0yvOO0ixfF82ywpAVrG4Q%3D%3D

## Net classes
1 5v_power: width 1 mm